# EAGLE schematic ECU_MULT_CAR (EAGLE 7.4.0), part 1 of 2

## Sheet 1 of 20
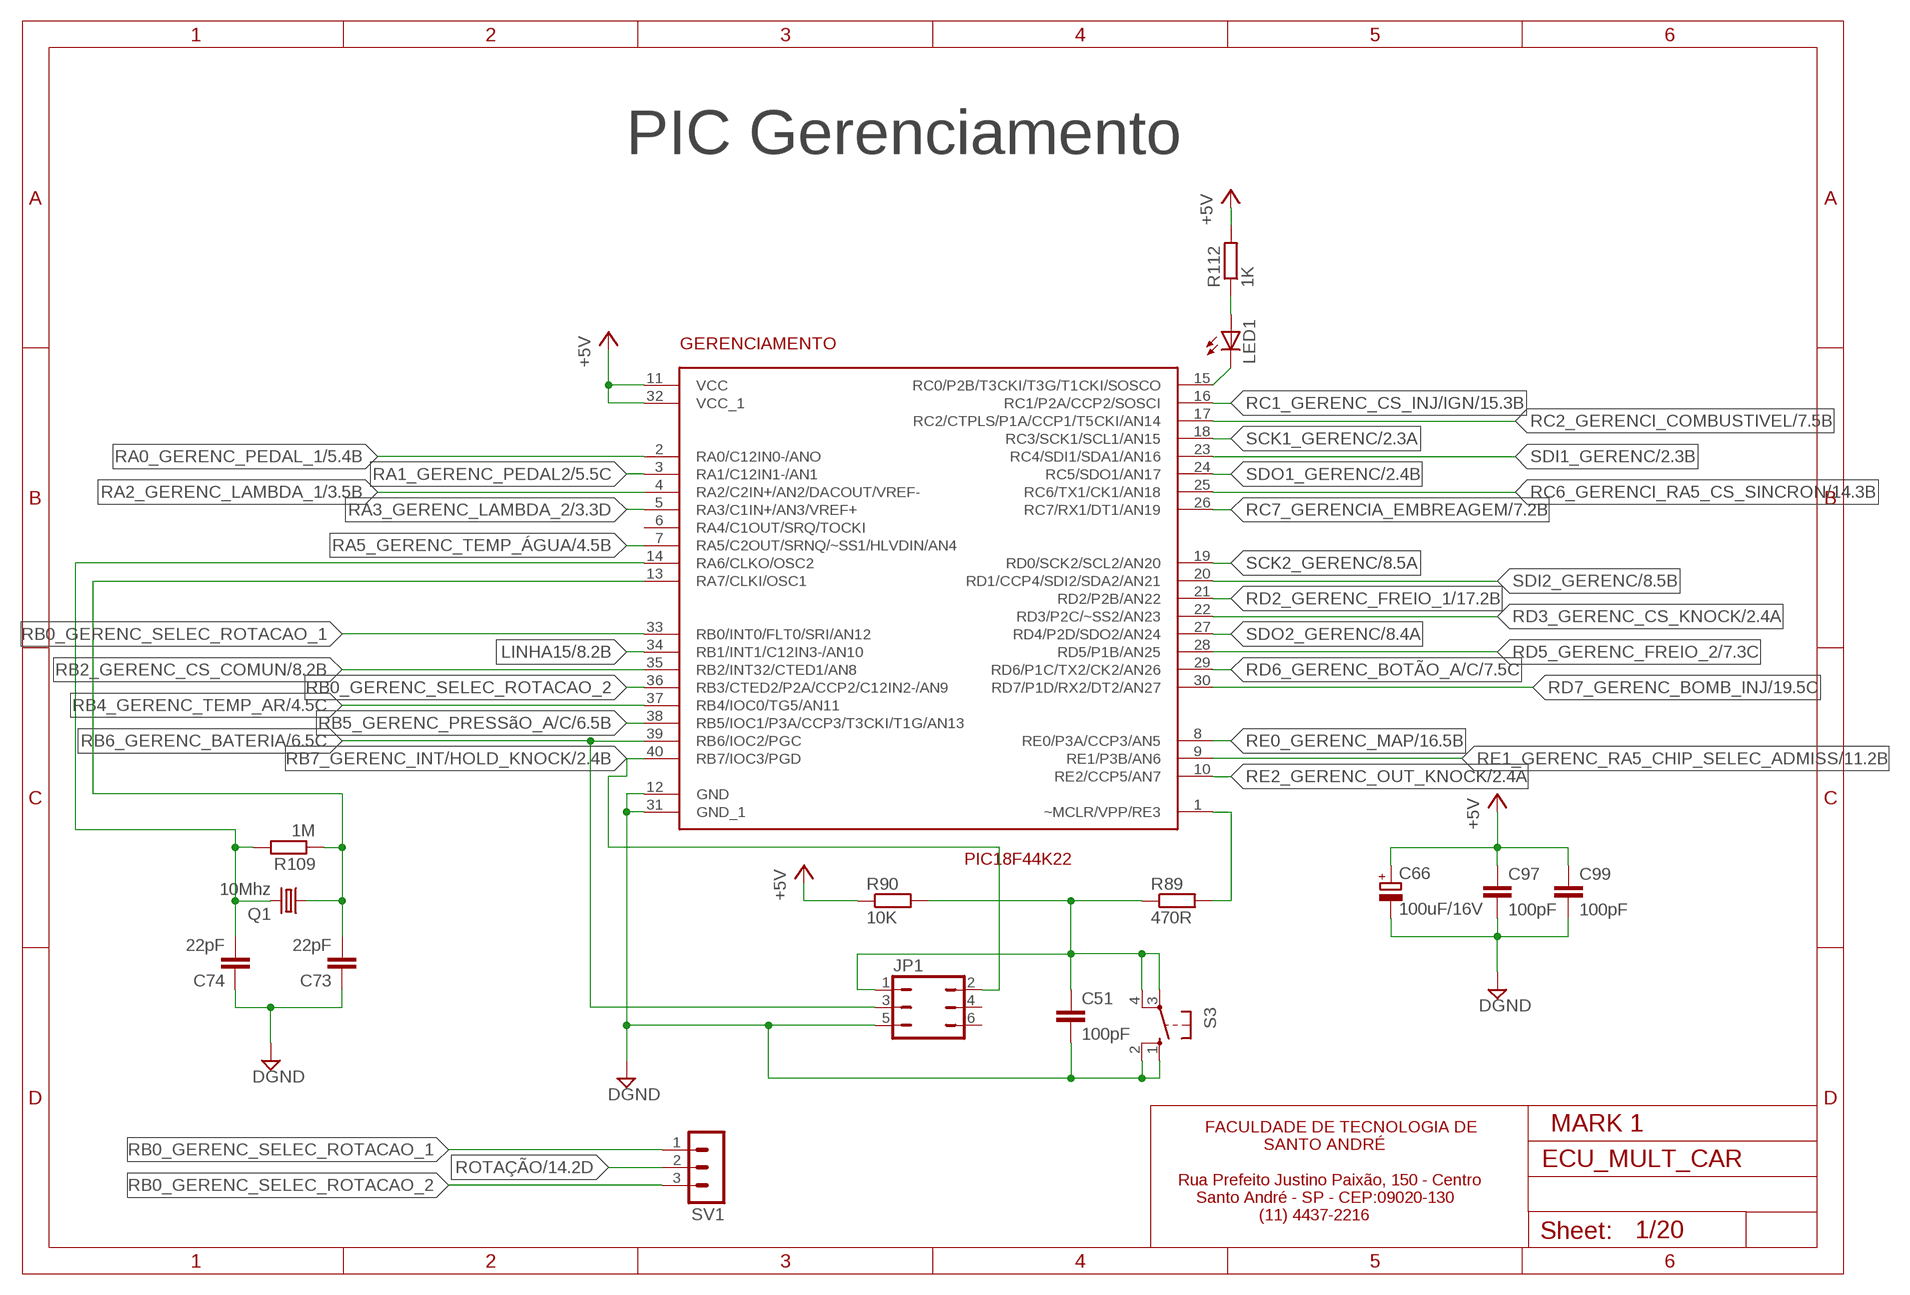
[diagram p0: schematic, sheet 1]

### Parts
C51  100pF  C-EUC0805  [C0805]
C66  100uF/16V  CPOL-EUE2.5-7  [E2,5-7]
C73  22pF  C-EUC0805  [C0805]
C74  22pF  C-EUC0805  [C0805]
C97  100pF  C-EUC0805  [C0805]
C99  100pF  C-EUC0805  [C0805]
GERENCIAMENTO  PIC18F44K22  [DIP40]
JP1  JP3Q  [JP3Q]
LED1  LEDKA-3528ASYC  [KA-3528ASYC]
Q1  10Mhz  CRYSTALSM49  [SM49]
R89  470R  R-EU_M0805  [M0805]
R90  10K  R-EU_M0805  [M0805]
R109  1M  R-EU_M0805  [M0805]
R112  1K  R-EU_M0805  [M0805]
S3  10-XX  [B3F-10XX]
SV1  MA03-1  [MA03-1]

### Nets
+5V: C66.+ C97.1 C99.1 GERENCIAMENTO.11(VCC) GERENCIAMENTO.32(VCC_1) R90.1 R112.2 ; also sheet 2,3,4,5,6,7,8,9,10,11,12,13,14,15,16,17,18,20
DGND: C51.2 C66.- C73.1 C74.1 C97.2 C99.2 GERENCIAMENTO.12(GND) GERENCIAMENTO.31(GND_1) JP1.5 S3.1(S) S3.2(S1) ; also sheet 2,3,7,8,9,10,11,14,15,17,18,19,20
LINHA15: GERENCIAMENTO.34(RB1/INT1/C12IN3-/AN10) ; also sheet 8,11,14,17
N$92: C73.2 GERENCIAMENTO.13(RA7/CLKI/OSC1) Q1.1 R109.1
N$94: GERENCIAMENTO.1(~MCLR/VPP/RE3) R89.2
N$95: C51.1 JP1.1 R89.1 R90.2 S3.3(P) S3.4(P1)
N$100: GERENCIAMENTO.15(RC0/P2B/T3CKI/T3G/T1CKI/SOSCO) LED1.C
N$102: LED1.A R112.1
N$120: C74.2 GERENCIAMENTO.14(RA6/CLKO/OSC2) Q1.2 R109.2
RA0_GERENC_PEDAL_1: GERENCIAMENTO.2(RA0/C12IN0-/ANO) ; also sheet 5
RA1_GERENC_PEDAL2: GERENCIAMENTO.3(RA1/C12IN1-/AN1) ; also sheet 5
RA2_GERENC_LAMBDA_1: GERENCIAMENTO.4(RA2/C2IN+/AN2/DACOUT/VREF-) ; also sheet 3
RA3_GERENC_LAMBDA_2: GERENCIAMENTO.5(RA3/C1IN+/AN3/VREF+) ; also sheet 3
RA5_GERENC_TEMP_ÁGUA: GERENCIAMENTO.7(RA5/C2OUT/SRNQ/~SS1/HLVDIN/AN4) ; also sheet 4
RB0_GERENC_SELEC_ROTACAO_1: GERENCIAMENTO.33(RB0/INT0/FLT0/SRI/AN12) SV1.1
RB0_GERENC_SELEC_ROTACAO_2: GERENCIAMENTO.36(RB3/CTED2/P2A/CCP2/C12IN2-/AN9) SV1.3
RB2_GERENC_CS_COMUN: GERENCIAMENTO.35(RB2/INT32/CTED1/AN8) ; also sheet 8
RB4_GERENC_TEMP_AR: GERENCIAMENTO.37(RB4/IOC0/TG5/AN11) ; also sheet 4
RB5_GERENC_PRESSãO_A/C: GERENCIAMENTO.38(RB5/IOC1/P3A/CCP3/T3CKI/T1G/AN13) ; also sheet 6
RB6_GERENC_BATERIA: GERENCIAMENTO.39(RB6/IOC2/PGC) JP1.3 ; also sheet 6
RB7_GERENC_INT/HOLD_KNOCK: GERENCIAMENTO.40(RB7/IOC3/PGD) JP1.2 ; also sheet 2
RC1_GERENC_CS_INJ/IGN: GERENCIAMENTO.16(RC1/P2A/CCP2/SOSCI) ; also sheet 15
RC2_GERENCI_COMBUSTIVEL: GERENCIAMENTO.17(RC2/CTPLS/P1A/CCP1/T5CKI/AN14) ; also sheet 7
RC6_GERENCI_RA5_CS_SINCRON: GERENCIAMENTO.25(RC6/TX1/CK1/AN18) ; also sheet 14
RC7_GERENCIA_EMBREAGEM: GERENCIAMENTO.26(RC7/RX1/DT1/AN19) ; also sheet 7
RD2_GERENC_FREIO_1: GERENCIAMENTO.21(RD2/P2B/AN22) ; also sheet 17
RD3_GERENC_CS_KNOCK: GERENCIAMENTO.22(RD3/P2C/~SS2/AN23) ; also sheet 2
RD5_GERENC_FREIO_2: GERENCIAMENTO.28(RD5/P1B/AN25) ; also sheet 7
RD6_GERENC_BOTÃO_A/C: GERENCIAMENTO.29(RD6/P1C/TX2/CK2/AN26) ; also sheet 7
RD7_GERENC_BOMB_INJ: GERENCIAMENTO.30(RD7/P1D/RX2/DT2/AN27) ; also sheet 19
RE0_GERENC_MAP: GERENCIAMENTO.8(RE0/P3A/CCP3/AN5) ; also sheet 16
RE1_GERENC_RA5_CHIP_SELEC_ADMISS: GERENCIAMENTO.9(RE1/P3B/AN6) ; also sheet 11
RE2_GERENC_OUT_KNOCK: GERENCIAMENTO.10(RE2/CCP5/AN7) ; also sheet 2
ROTAÇÃO: SV1.2 ; also sheet 14,18
SCK1_GERENC: GERENCIAMENTO.18(RC3/SCK1/SCL1/AN15) ; also sheet 2,11,14,15
SCK2_GERENC: GERENCIAMENTO.19(RD0/SCK2/SCL2/AN20) ; also sheet 8
SDI1_GERENC: GERENCIAMENTO.23(RC4/SDI1/SDA1/AN16) ; also sheet 2,11,14,15
SDI2_GERENC: GERENCIAMENTO.20(RD1/CCP4/SDI2/SDA2/AN21) ; also sheet 8
SDO1_GERENC: GERENCIAMENTO.24(RC5/SDO1/AN17) ; also sheet 2,11,14,15
SDO2_GERENC: GERENCIAMENTO.27(RD4/P2D/SDO2/AN24) ; also sheet 8
Unconnected: GERENCIAMENTO.6(RA4/C1OUT/SRQ/TOCKI) JP1.4 JP1.6

### Notes on the sheet
- PIC Gerenciamento
- MARK 1
- FACULDADE DE TECNOLOGIA DE 
                             SANTO ANDRÉ
  
          Rua Prefeito Justino Paixão, 150 - Centro  
              Santo André - SP - CEP:09020-130
                            (11) 4437-2216

## Sheet 2 of 20
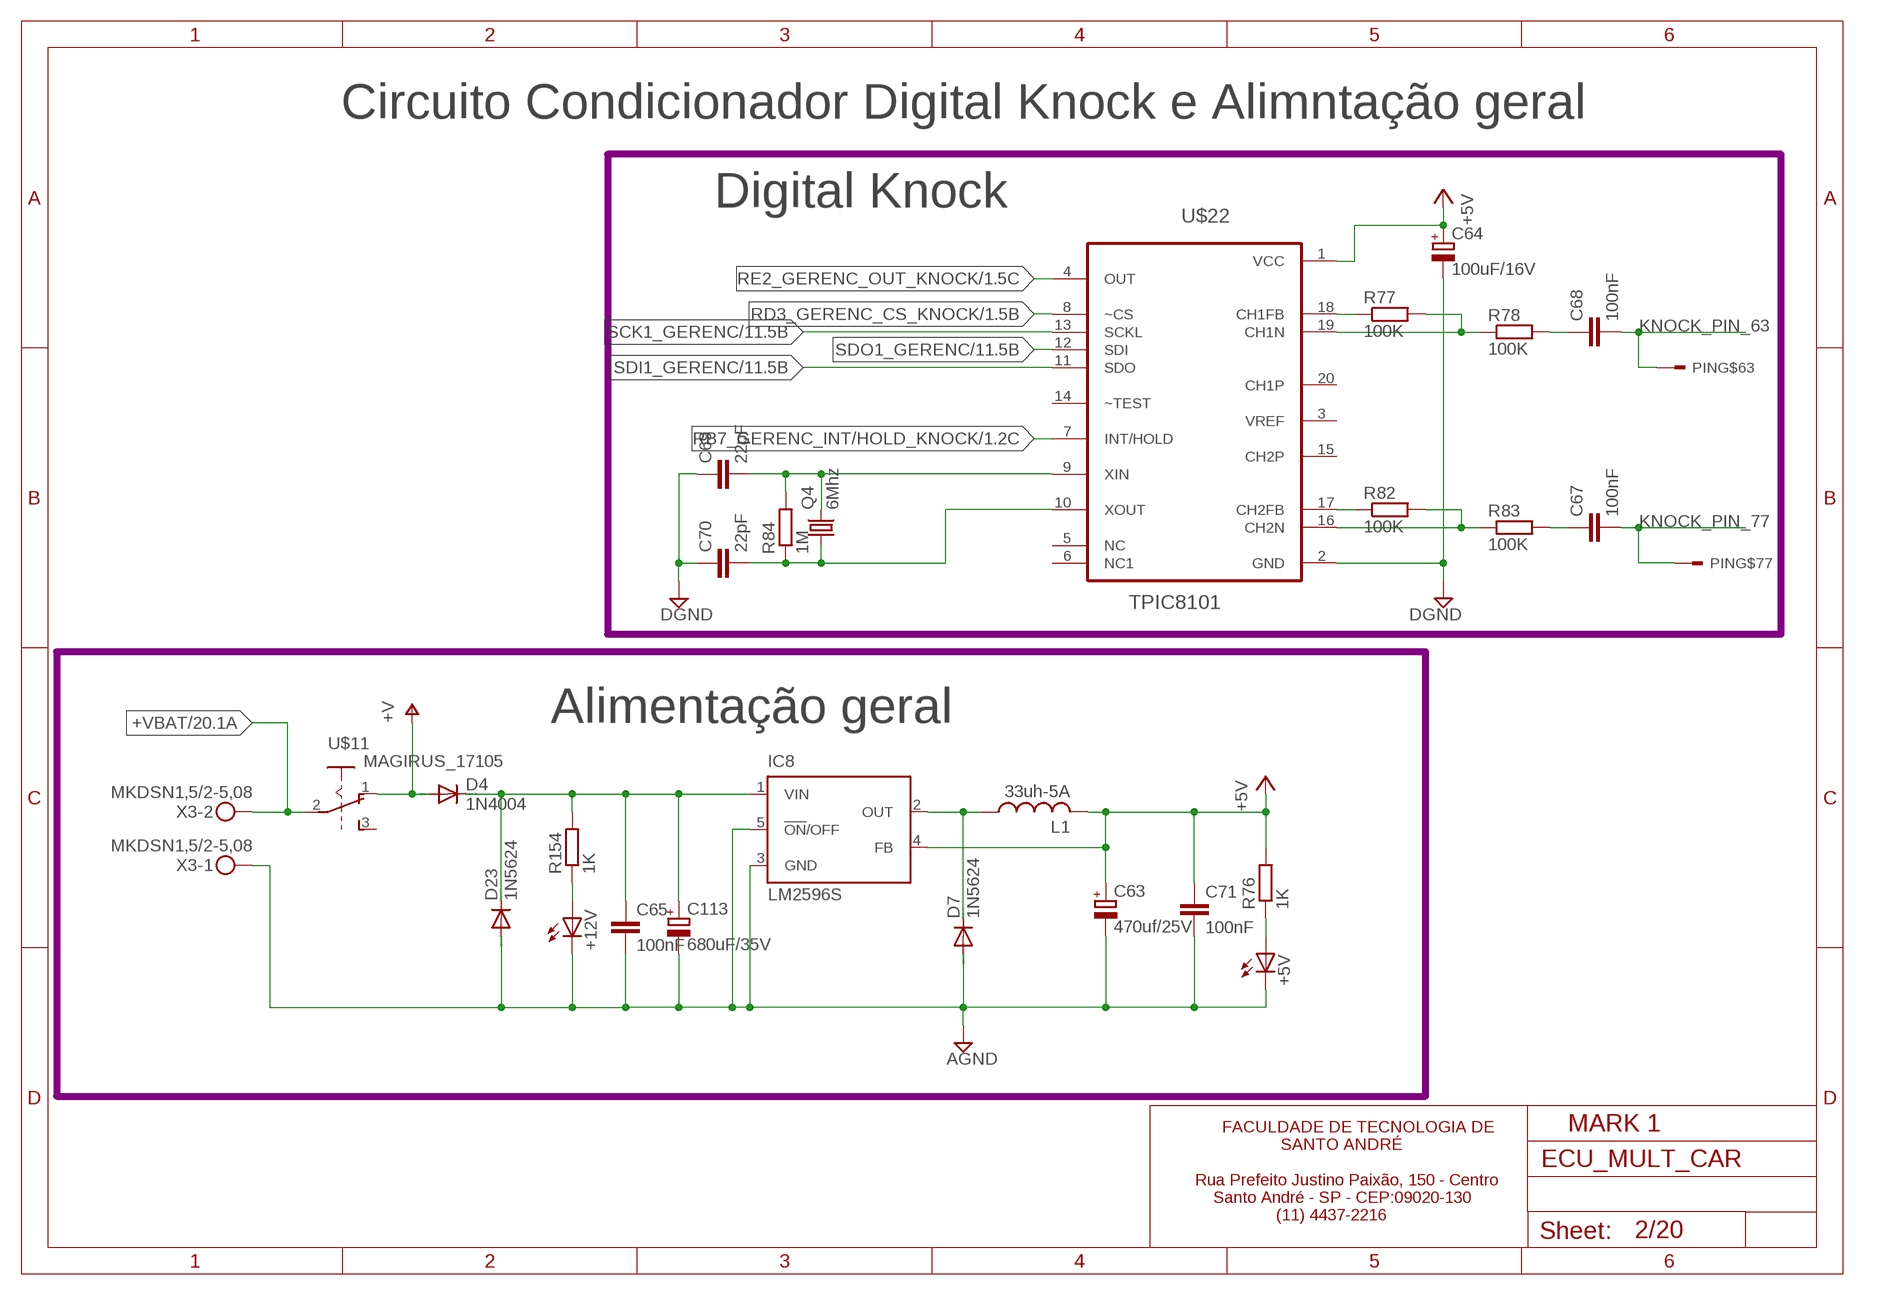
[diagram p1: schematic, sheet 2]

### Parts
+5V  LEDKA-3528ASYC  [KA-3528ASYC]
+12V  LEDKA-3528ASYC  [KA-3528ASYC]
C63  470uf/25V  CPOL-EUE3.5-8  [E3,5-8]
C64  100uF/16V  CPOL-EUE2.5-7  [E2,5-7]
C65  100nF  C-EUC0805  [C0805]
C67  100nF  C-EUC0805  [C0805]
C68  100nF  C-EUC0805  [C0805]
C69  22pF  C-EUC0805  [C0805]
C70  22pF  C-EUC0805  [C0805]
C71  100nF  C-EUC0805  [C0805]
C113  680uF/35V  CPOL-EUE3.5-10  [E3,5-10]
D4  1N4004  [DO41-10]
D7  1N5624  [DO201-15]
D23  1N5624  [DO201-15]
IC8  LM2596S  [TO263-5]
L1  33uh-5A  L-USWE-TPC  [POWER-CHOKE_WE-TPC]
PIN  CONCTOR_BOSCH  [V23542-A1280-B300]
Q4  6Mhz  CRYSTALSM49  [SM49]
R76  1K  R-EU_M0805  [M0805]
R77  100K  R-EU_M0805  [M0805]
R78  100K  R-EU_M0805  [M0805]
R82  100K  R-EU_M0805  [M0805]
R83  100K  R-EU_M0805  [M0805]
R84  1M  R-EU_M0805  [M0805]
R154  1K  R-EU_M0805  [M0805]
U$11  MAGIRUS_17105  [MAGIRUS_TICTAC_3_PIN]
U$22  TPIC8101  [SOIC-20P]
X3  MKDSN1,5/2-5,08  [MKDSN1,5/2-5,08]

### Nets
+5V: C63.+ C64.+ C71.1 IC8.4(FB) L1.2 R76.2 U$22.1(VCC) ; also sheet 1,3,4,5,6,7,8,9,10,11,12,13,14,15,16,17,18,20
+VBAT: U$11.2 X3.2 ; also sheet 20
DGND: C64.- C69.1 C70.1 U$22.2(GND) ; also sheet 1,3,7,8,9,10,11,14,15,17,18,19,20
GND3: +5V.C +12V.C C63.- C65.2 C71.2 C113.- D7.A D23.A IC8.3(GND) IC8.5(!ON!/OFF) X3.1 ; supply symbol labelled AGND ; also sheet 4,5,6,12,13,16,20
KNOCK_PIN_63: C68.2 PIN.63
KNOCK_PIN_77: C67.2 PIN.77
N$50: R82.1 U$22.17(CH2FB)
N$70: +12V.A R154.1
N$75: C65.1 C113.+ D4.C D23.C IC8.1(VIN) R154.2
N$76: D7.C IC8.2(OUT) L1.1
N$80: R77.1 U$22.18(CH1FB)
N$81: R77.2 R78.1 U$22.19(CH1N)
N$82: +5V.A R76.1
N$83: C68.1 R78.2
N$84: R82.2 R83.1 U$22.16(CH2N)
N$85: C67.1 R83.2
N$86: C70.2 Q4.1 R84.1 U$22.10(XOUT)
N$87: C69.2 Q4.2 R84.2 U$22.9(XIN)
RB7_GERENC_INT/HOLD_KNOCK: U$22.7(INT/HOLD) ; also sheet 1
RD3_GERENC_CS_KNOCK: U$22.8(~CS) ; also sheet 1
RE2_GERENC_OUT_KNOCK: U$22.4(OUT) ; also sheet 1
SCK1_GERENC: U$22.13(SCKL) ; also sheet 1,11,14,15
SDI1_GERENC: U$22.11(SDO) ; also sheet 1,11,14,15
SDO1_GERENC: U$22.12(SDI) ; also sheet 1,11,14,15
V+: D4.A U$11.1 ; supply symbol labelled +V ; also sheet 3,4,5,6,13,15,16
Unconnected: PIN.34 PIN.35 PIN.36 PIN.37 PIN.39 PIN.41 PIN.43 PIN.49 PIN.50 PIN.52 PIN.58 PIN.69 PIN.72 PIN.76 PIN.78 U$11.3 U$22.3(VREF) U$22.5(NC) U$22.6(NC1) U$22.14(~TEST) U$22.15(CH2P) U$22.20(CH1P)

### Notes on the sheet
- Circuito Condicionador Digital Knock e Alimntação geral
- Digital Knock
- Alimentação geral
- MARK 1
- FACULDADE DE TECNOLOGIA DE 
                             SANTO ANDRÉ
  
          Rua Prefeito Justino Paixão, 150 - Centro  
              Santo André - SP - CEP:09020-130
                            (11) 4437-2216

## Sheet 3 of 20
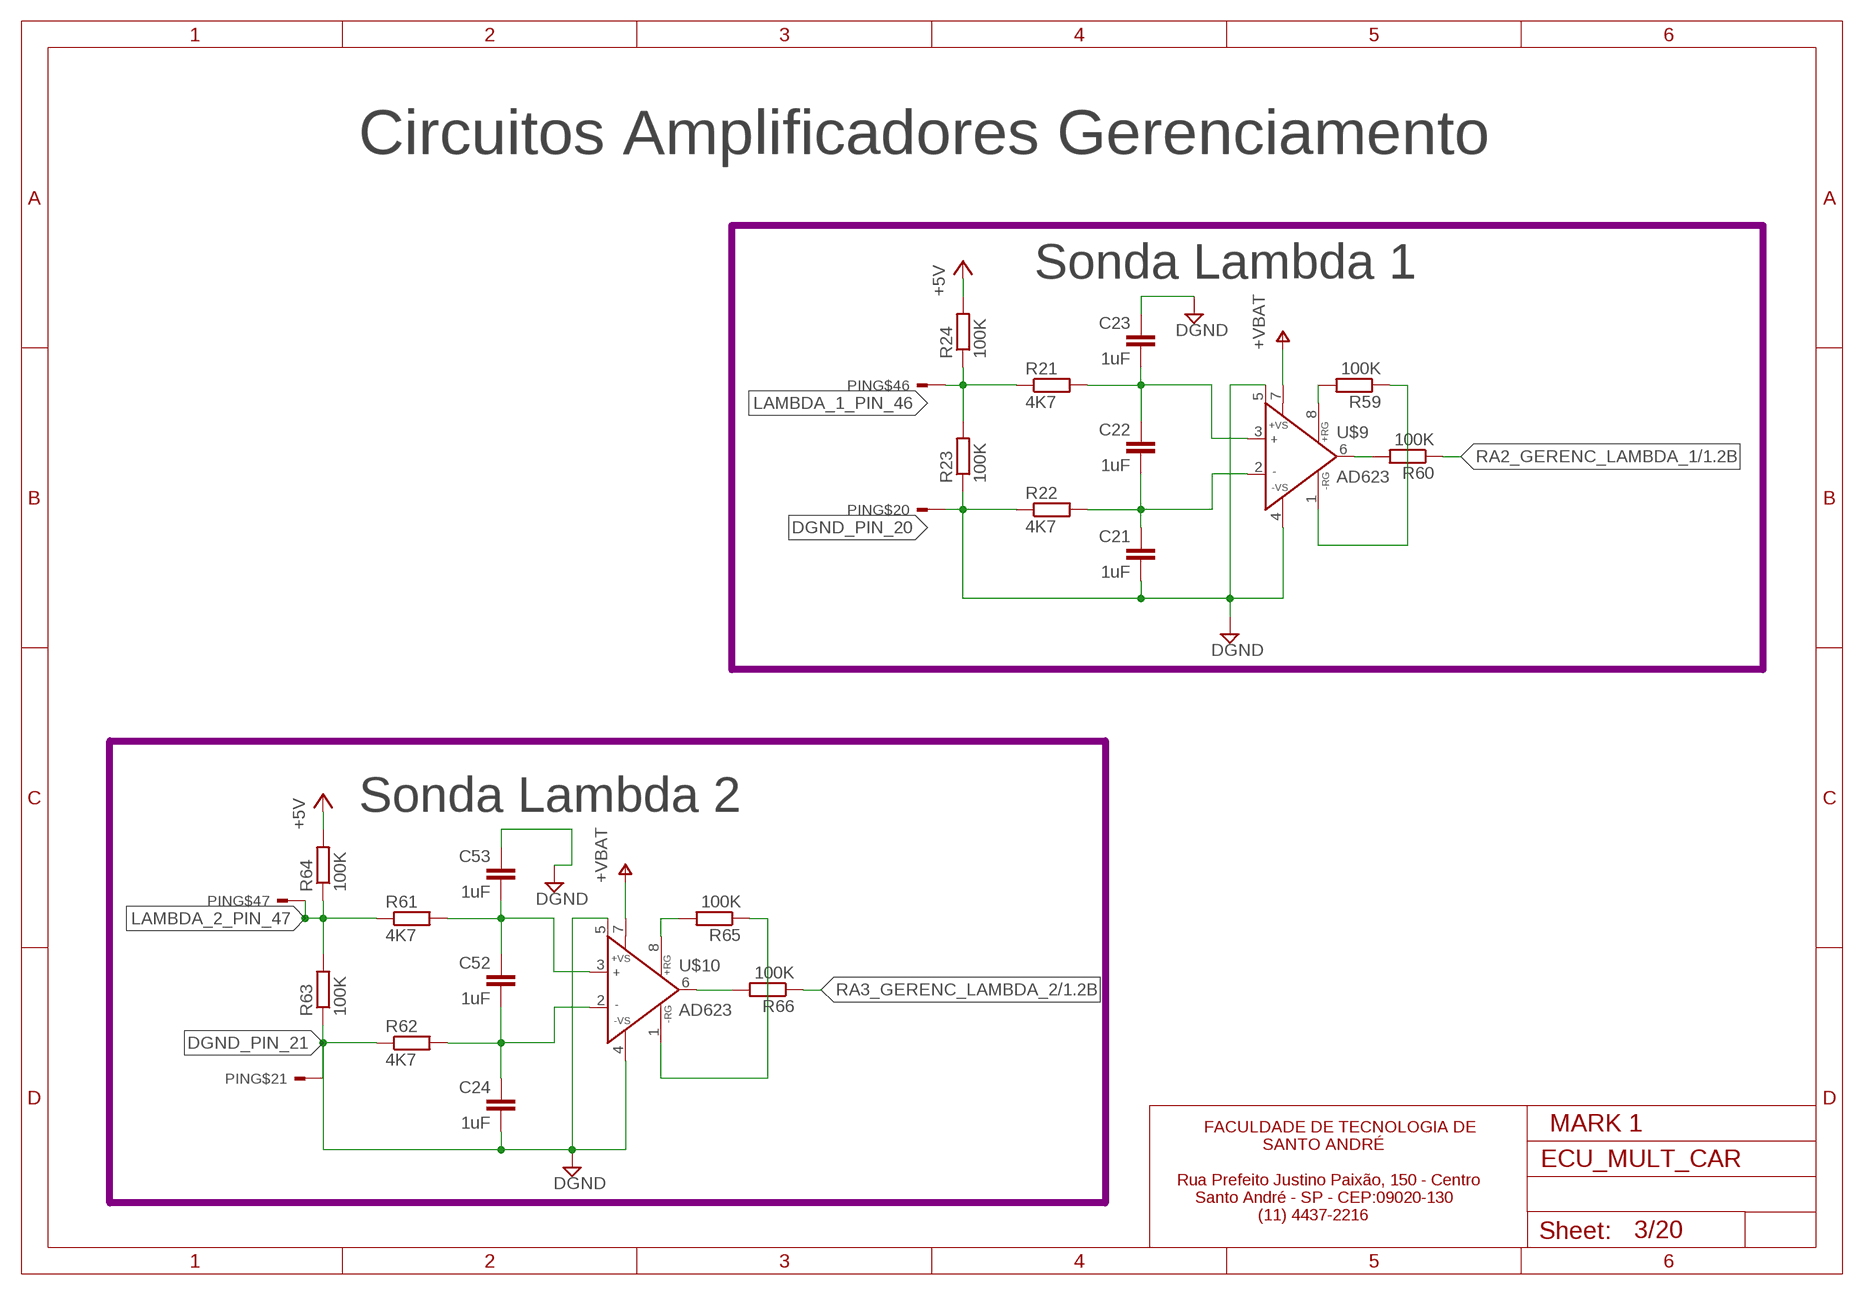
[diagram p2: schematic, sheet 3]

### Parts
C21  1uF  C-EUC0805  [C0805]
C22  1uF  C-EUC0805  [C0805]
C23  1uF  C-EUC0805  [C0805]
C24  1uF  C-EUC0805  [C0805]
C52  1uF  C-EUC0805  [C0805]
C53  1uF  C-EUC0805  [C0805]
R21  4K7  R-EU_M0805  [M0805]
R22  4K7  R-EU_M0805  [M0805]
R23  100K  R-EU_M0805  [M0805]
R24  100K  R-EU_M0805  [M0805]
R59  100K  R-EU_M0805  [M0805]
R60  100K  R-EU_M0805  [M0805]
R61  4K7  R-EU_M0805  [M0805]
R62  4K7  R-EU_M0805  [M0805]
R63  100K  R-EU_M0805  [M0805]
R64  100K  R-EU_M0805  [M0805]
R65  100K  R-EU_M0805  [M0805]
R66  100K  R-EU_M0805  [M0805]
U$9  AD623  [SOIC-8]
U$10  AD623  [SOIC-8]

### Nets
+5V: R24.2 R64.2 ; also sheet 1,2,4,5,6,7,8,9,10,11,12,13,14,15,16,17,18,20
DGND: C23.1 C53.1 ; also sheet 1,2,7,8,9,10,11,14,15,17,18,19,20
DGND_PIN_20: C21.2 PIN.20 R22.1 R23.1 U$9.4(-VS) U$9.5(REF) ; supply symbol labelled DGND
DGND_PIN_21: C24.2 PIN.21 R62.1 R63.1 U$10.4(-VS) U$10.5(REF) ; supply symbol labelled DGND
LAMBDA_1_PIN_46: PIN.46 R21.1 R23.2 R24.1
LAMBDA_2_PIN_47: PIN.47 R61.1 R63.2 R64.1
N$24: C22.1 C23.2 R21.2 U$9.3(+IN)
N$25: C21.1 C22.2 R22.2 U$9.2(-IN)
N$26: C52.1 C53.2 R61.2 U$10.3(+IN)
N$27: C24.1 C52.2 R62.2 U$10.2(-IN)
N$28: R59.2 U$9.8(+RG)
N$49: R59.1 U$9.1(-RG)
N$56: R60.2 U$9.6(OUTPUT)
N$58: R65.2 U$10.8(+RG)
N$60: R65.1 U$10.1(-RG)
N$64: R66.2 U$10.6(OUTPUT)
RA2_GERENC_LAMBDA_1: R60.1 ; also sheet 1
RA3_GERENC_LAMBDA_2: R66.1 ; also sheet 1
V+: U$9.7(+VS) U$10.7(+VS) ; supply symbol labelled +VBAT ; also sheet 2,4,5,6,13,15,16

### Notes on the sheet
- Circuitos Amplificadores Gerenciamento
- Sonda Lambda 1
- Sonda Lambda 2
- MARK 1
- FACULDADE DE TECNOLOGIA DE 
                             SANTO ANDRÉ
  
          Rua Prefeito Justino Paixão, 150 - Centro  
              Santo André - SP - CEP:09020-130
                            (11) 4437-2216

## Sheet 4 of 20
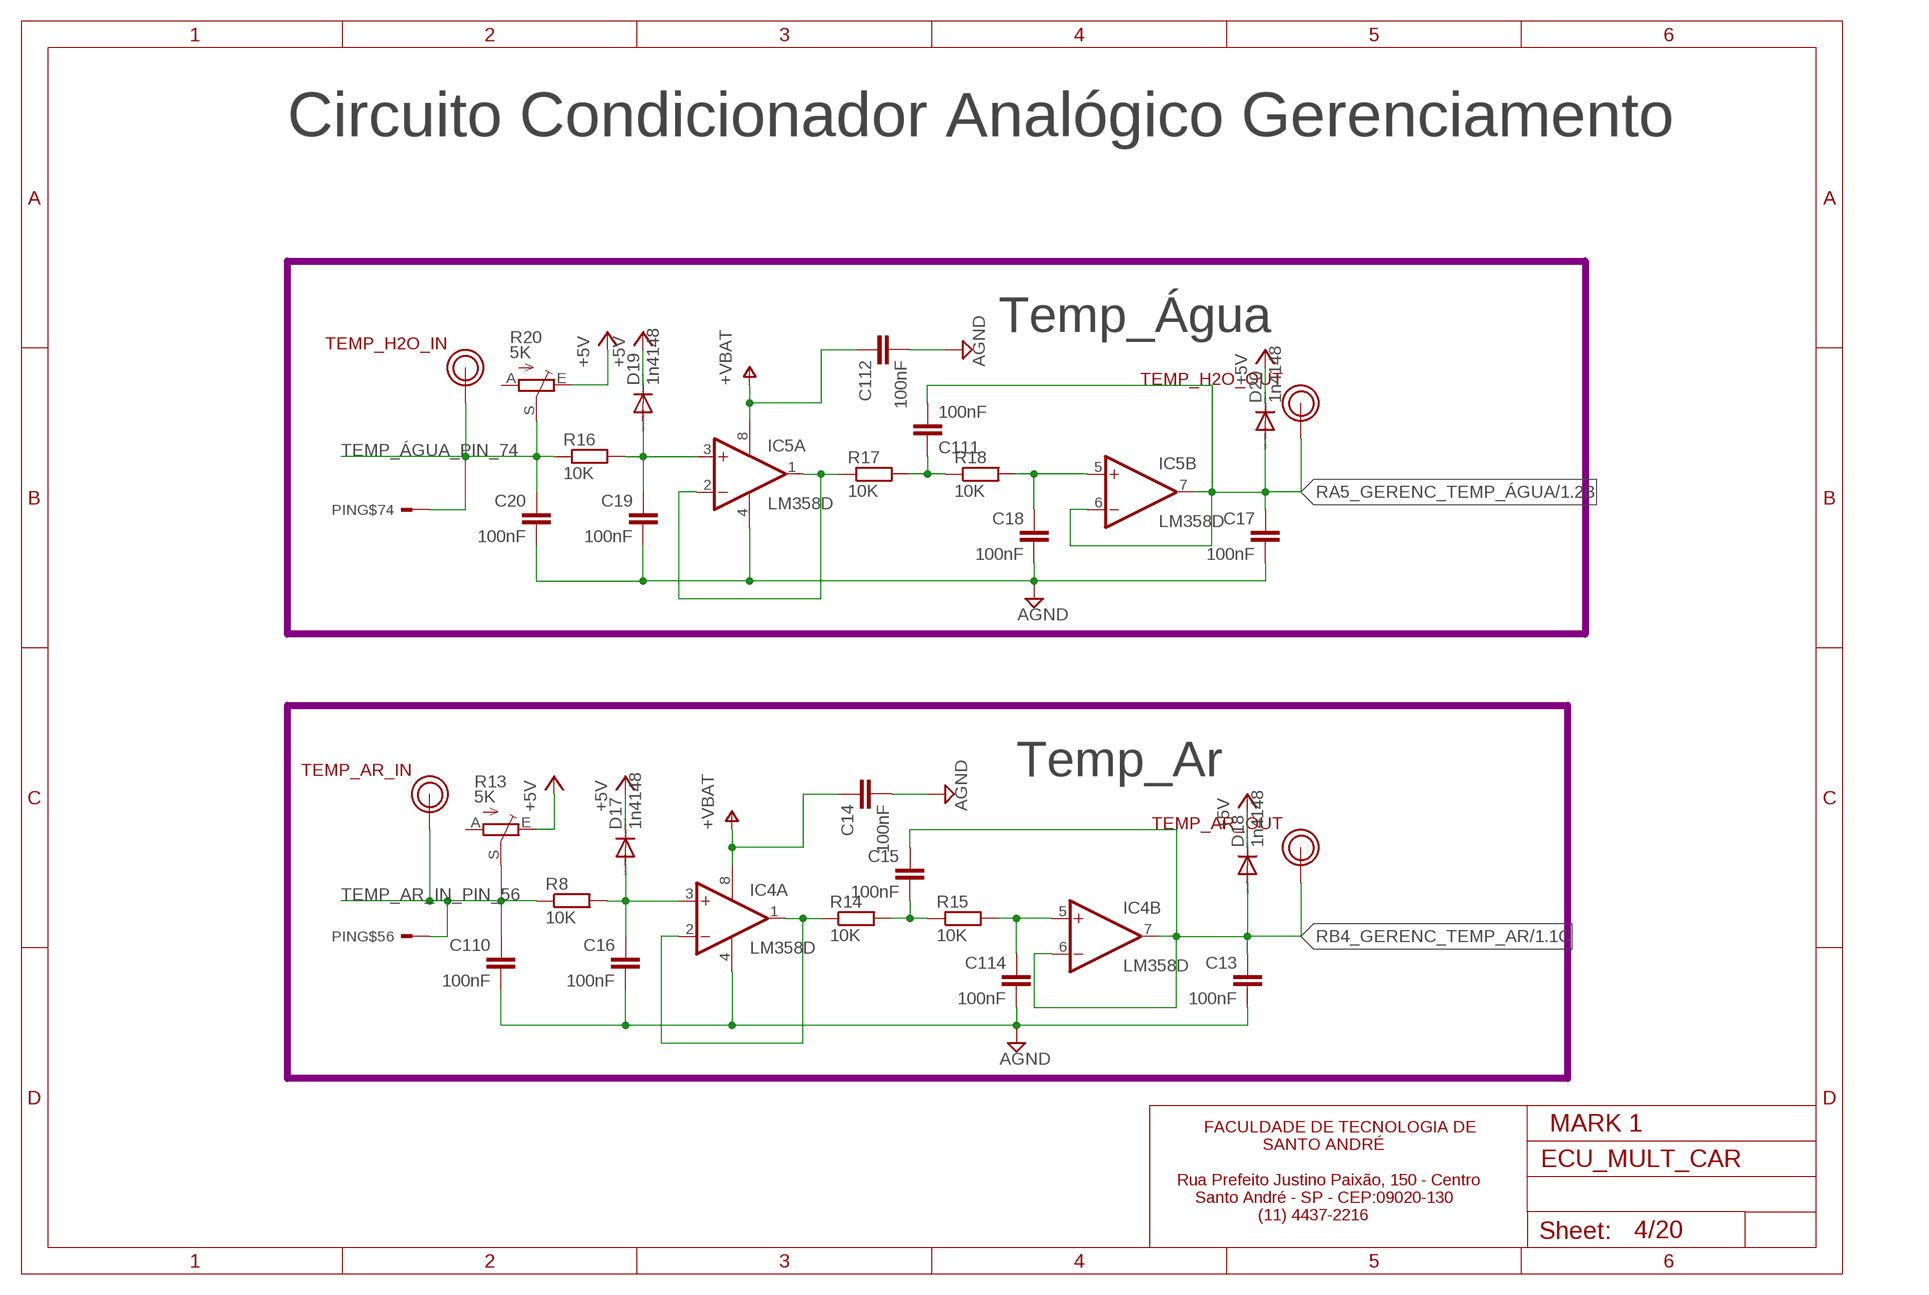
[diagram p3: schematic, sheet 4]

### Parts
C13  100nF  C-EUC0805  [C0805]
C14  100nF  C-EUC0805  [C0805]
C15  100nF  C-EUC0805  [C0805]
C16  100nF  C-EUC0805  [C0805]
C17  100nF  C-EUC0805  [C0805]
C18  100nF  C-EUC0805  [C0805]
C19  100nF  C-EUC0805  [C0805]
C20  100nF  C-EUC0805  [C0805]
C110  100nF  C-EUC0805  [C0805]
C111  100nF  C-EUC0805  [C0805]
C112  100nF  C-EUC0805  [C0805]
C114  100nF  C-EUC0805  [C0805]
D17  1n4148  DIODE-MINIMELF  [MINIMELF]
D18  1n4148  DIODE-MINIMELF  [MINIMELF]
D19  1n4148  DIODE-MINIMELF  [MINIMELF]
D20  1n4148  DIODE-MINIMELF  [MINIMELF]
IC4  LM358D  [SO08]
IC5  LM358D  [SO08]
R8  10K  R-EU_M0805  [M0805]
R13  5K  TRIM_EU-S63P  [S63P]
R14  10K  R-EU_M0805  [M0805]
R15  10K  R-EU_M0805  [M0805]
R16  10K  R-EU_M0805  [M0805]
R17  10K  R-EU_M0805  [M0805]
R18  10K  R-EU_M0805  [M0805]
R20  5K  TRIM_EU-S63P  [S63P]
TEMP_AR_IN  PINO_TORNEADO  [PINO_TORNEADO]
TEMP_AR_OUT  PINO_TORNEADO  [PINO_TORNEADO]
TEMP_H2O_IN  PINO_TORNEADO  [PINO_TORNEADO]
TEMP_H2O_OUT  PINO_TORNEADO  [PINO_TORNEADO]

### Nets
+5V: D17.C D18.C D19.C D20.C R13.E R20.E ; also sheet 1,2,3,5,6,7,8,9,10,11,12,13,14,15,16,17,18,20
GND3: C13.2 C14.2 C16.2 C17.2 C18.2 C19.2 C20.2 C110.2 C112.2 C114.2 IC4.4(P:V-) IC5.4(P:V-) ; supply symbol labelled AGND ; also sheet 2,5,6,12,13,16,20
N$10: C16.1 D17.A IC4.3(A:+IN) R8.2
N$16: C19.1 D19.A IC5.3(A:+IN) R16.2
N$17: IC4.1(A:OUT) IC4.2(A:-IN) R14.1
N$18: C15.2 R14.2 R15.1
N$19: C114.1 IC4.5(B:+IN) R15.2
N$21: IC5.1(A:OUT) IC5.2(A:-IN) R17.1
N$22: C111.1 R17.2 R18.1
N$23: C18.1 IC5.5(B:+IN) R18.2
RA5_GERENC_TEMP_ÁGUA: C17.1 C111.2 D20.A IC5.6(B:-IN) IC5.7(B:OUT) TEMP_H2O_OUT.1(PINO1) ; also sheet 1
RB4_GERENC_TEMP_AR: C13.1 C15.1 D18.A IC4.6(B:-IN) IC4.7(B:OUT) TEMP_AR_OUT.1(PINO1) ; also sheet 1
TEMP_AR_IN_PIN_56: C110.1 PIN.56 R8.1 R13.S TEMP_AR_IN.1(PINO1)
TEMP_ÁGUA_PIN_74: C20.1 PIN.74 R16.1 R20.S TEMP_H2O_IN.1(PINO1)
V+: C14.1 C112.1 IC4.8(P:V+) IC5.8(P:V+) ; supply symbol labelled +VBAT ; also sheet 2,3,5,6,13,15,16
Unconnected: R13.A R20.A

### Notes on the sheet
- Circuito Condicionador Analógico Gerenciamento
- Temp_Água
- Temp_Ar
- MARK 1
- FACULDADE DE TECNOLOGIA DE 
                             SANTO ANDRÉ
  
          Rua Prefeito Justino Paixão, 150 - Centro  
              Santo André - SP - CEP:09020-130
                            (11) 4437-2216

## Sheet 5 of 20
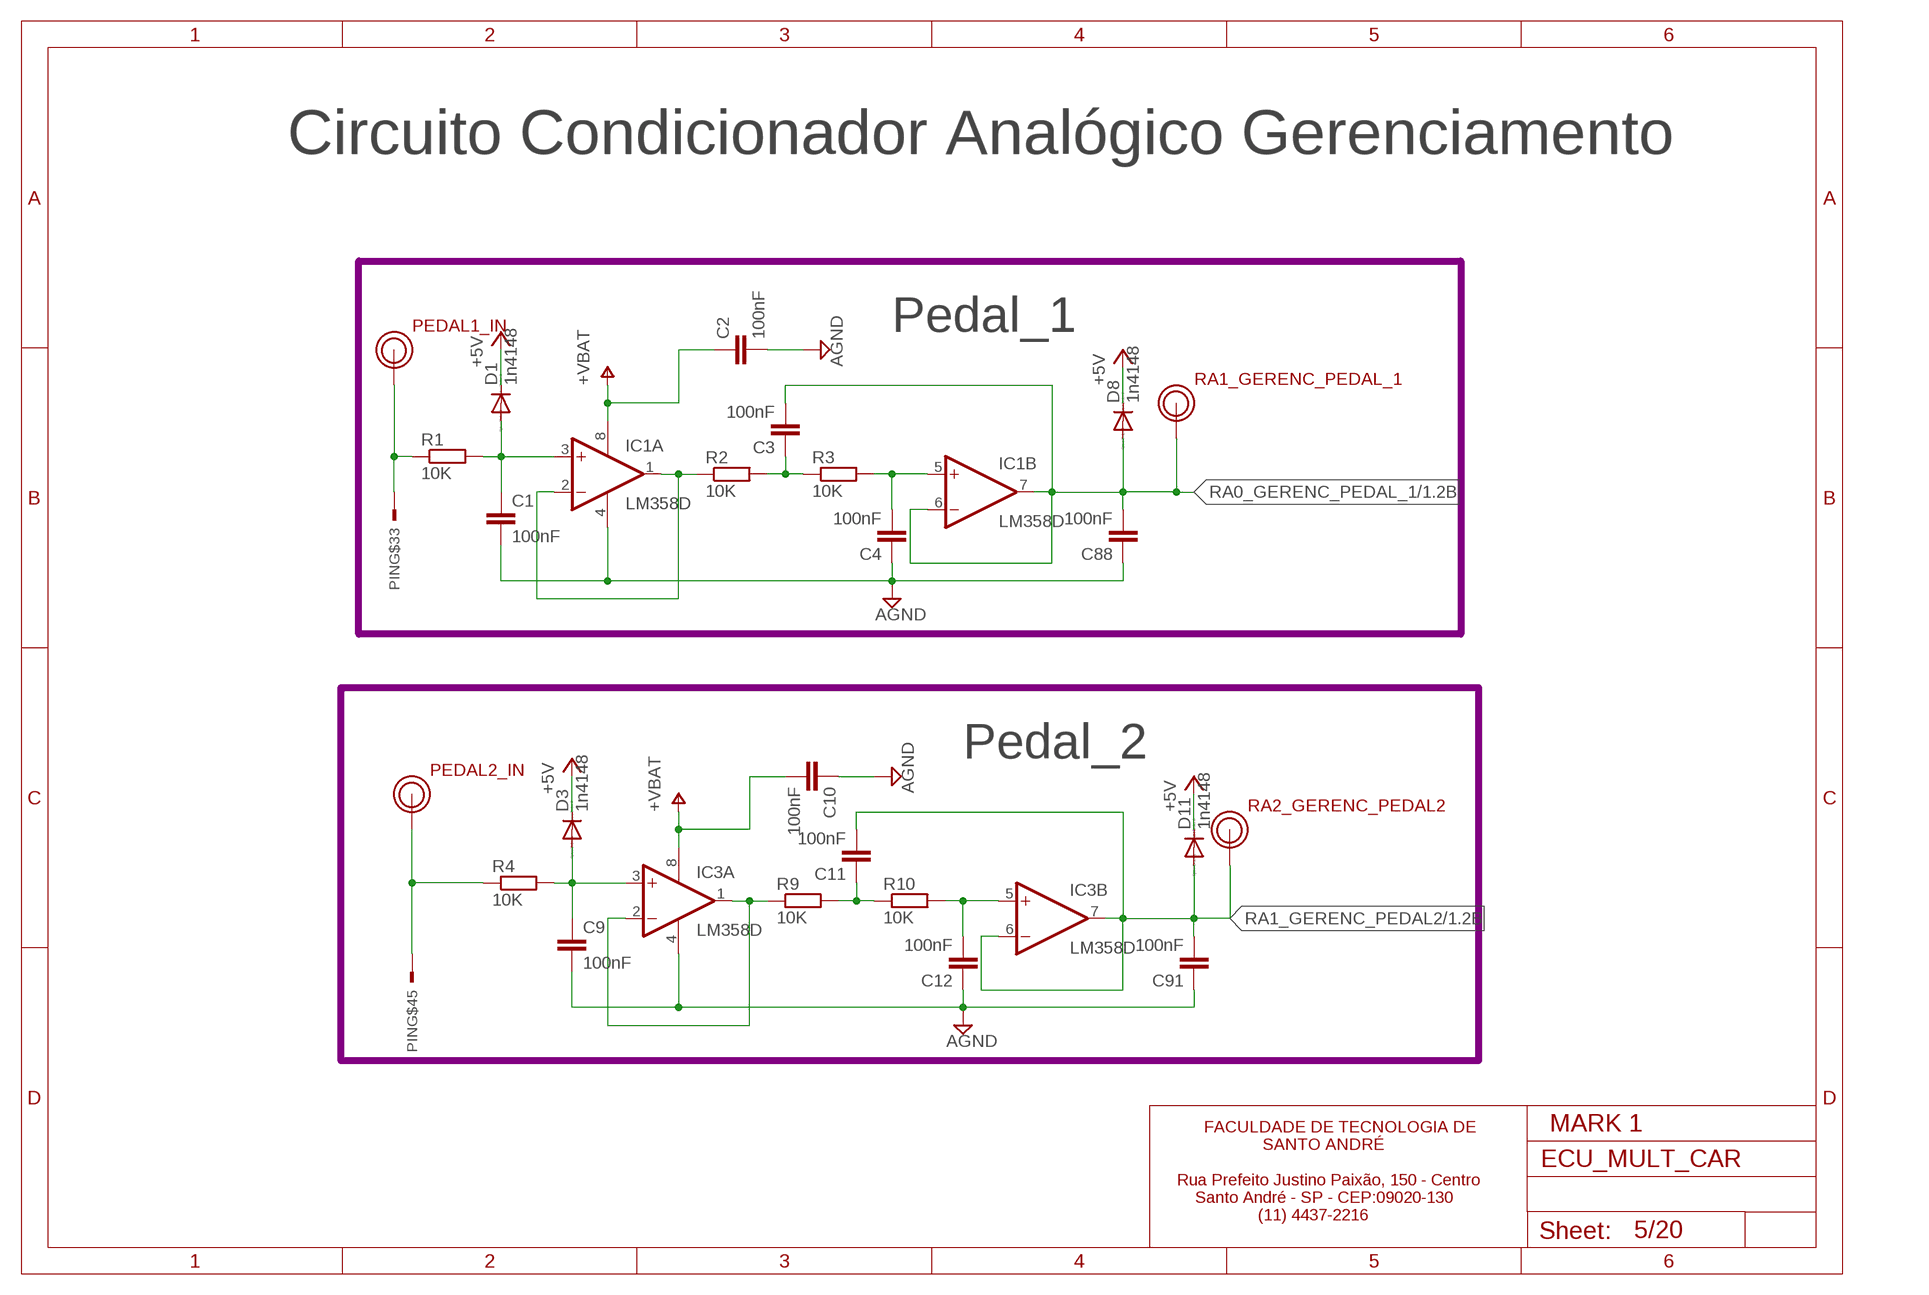
[diagram p4: schematic, sheet 5]

### Parts
C1  100nF  C-EUC0805  [C0805]
C2  100nF  C-EUC0805  [C0805]
C3  100nF  C-EUC0805  [C0805]
C4  100nF  C-EUC0805  [C0805]
C9  100nF  C-EUC0805  [C0805]
C10  100nF  C-EUC0805  [C0805]
C11  100nF  C-EUC0805  [C0805]
C12  100nF  C-EUC0805  [C0805]
C88  100nF  C-EUC0805  [C0805]
C91  100nF  C-EUC0805  [C0805]
D1  1n4148  DIODE-MINIMELF  [MINIMELF]
D3  1n4148  DIODE-MINIMELF  [MINIMELF]
D8  1n4148  DIODE-MINIMELF  [MINIMELF]
D11  1n4148  DIODE-MINIMELF  [MINIMELF]
IC1  LM358D  [SO08]
IC3  LM358D  [SO08]
PEDAL1_IN  PINO_TORNEADO  [PINO_TORNEADO]
PEDAL2_IN  PINO_TORNEADO  [PINO_TORNEADO]
R1  10K  R-EU_M0805  [M0805]
R2  10K  R-EU_M0805  [M0805]
R3  10K  R-EU_M0805  [M0805]
R4  10K  R-EU_M0805  [M0805]
R9  10K  R-EU_M0805  [M0805]
R10  10K  R-EU_M0805  [M0805]
RA1_GERENC_PEDAL_1  PINO_TORNEADO  [PINO_TORNEADO]
RA2_GERENC_PEDAL2  PINO_TORNEADO  [PINO_TORNEADO]

### Nets
+5V: D1.C D3.C D8.C D11.C ; also sheet 1,2,3,4,6,7,8,9,10,11,12,13,14,15,16,17,18,20
GND3: C1.2 C2.2 C4.1 C9.2 C10.1 C12.1 C88.1 C91.1 IC1.4(P:V-) IC3.4(P:V-) ; supply symbol labelled AGND ; also sheet 2,4,6,12,13,16,20
N$1: C1.1 D1.A IC1.3(A:+IN) R1.2
N$2: IC1.1(A:OUT) IC1.2(A:-IN) R2.1
N$3: C9.1 D3.A IC3.3(A:+IN) R4.2
N$4: C3.1 R2.2 R3.1
N$5: C4.2 IC1.5(B:+IN) R3.2
N$11: IC3.1(A:OUT) IC3.2(A:-IN) R9.1
N$12: C11.1 R9.2 R10.1
N$13: C12.2 IC3.5(B:+IN) R10.2
PEDAL1_PIN_33: PEDAL1_IN.1(PINO1) PIN.33 R1.1
PEDAL2_PIN_45: PEDAL2_IN.1(PINO1) PIN.45 R4.1
RA0_GERENC_PEDAL_1: C3.2 C88.2 D8.A IC1.6(B:-IN) IC1.7(B:OUT) RA1_GERENC_PEDAL_1.1(PINO1) ; also sheet 1
RA1_GERENC_PEDAL2: C11.2 C91.2 D11.A IC3.6(B:-IN) IC3.7(B:OUT) RA2_GERENC_PEDAL2.1(PINO1) ; also sheet 1
V+: C2.1 C10.2 IC1.8(P:V+) IC3.8(P:V+) ; supply symbol labelled +VBAT ; also sheet 2,3,4,6,13,15,16

### Notes on the sheet
- Circuito Condicionador Analógico Gerenciamento
- Pedal_1
- Pedal_2
- MARK 1
- FACULDADE DE TECNOLOGIA DE 
                             SANTO ANDRÉ
  
          Rua Prefeito Justino Paixão, 150 - Centro  
              Santo André - SP - CEP:09020-130
                            (11) 4437-2216

## Sheet 6 of 20
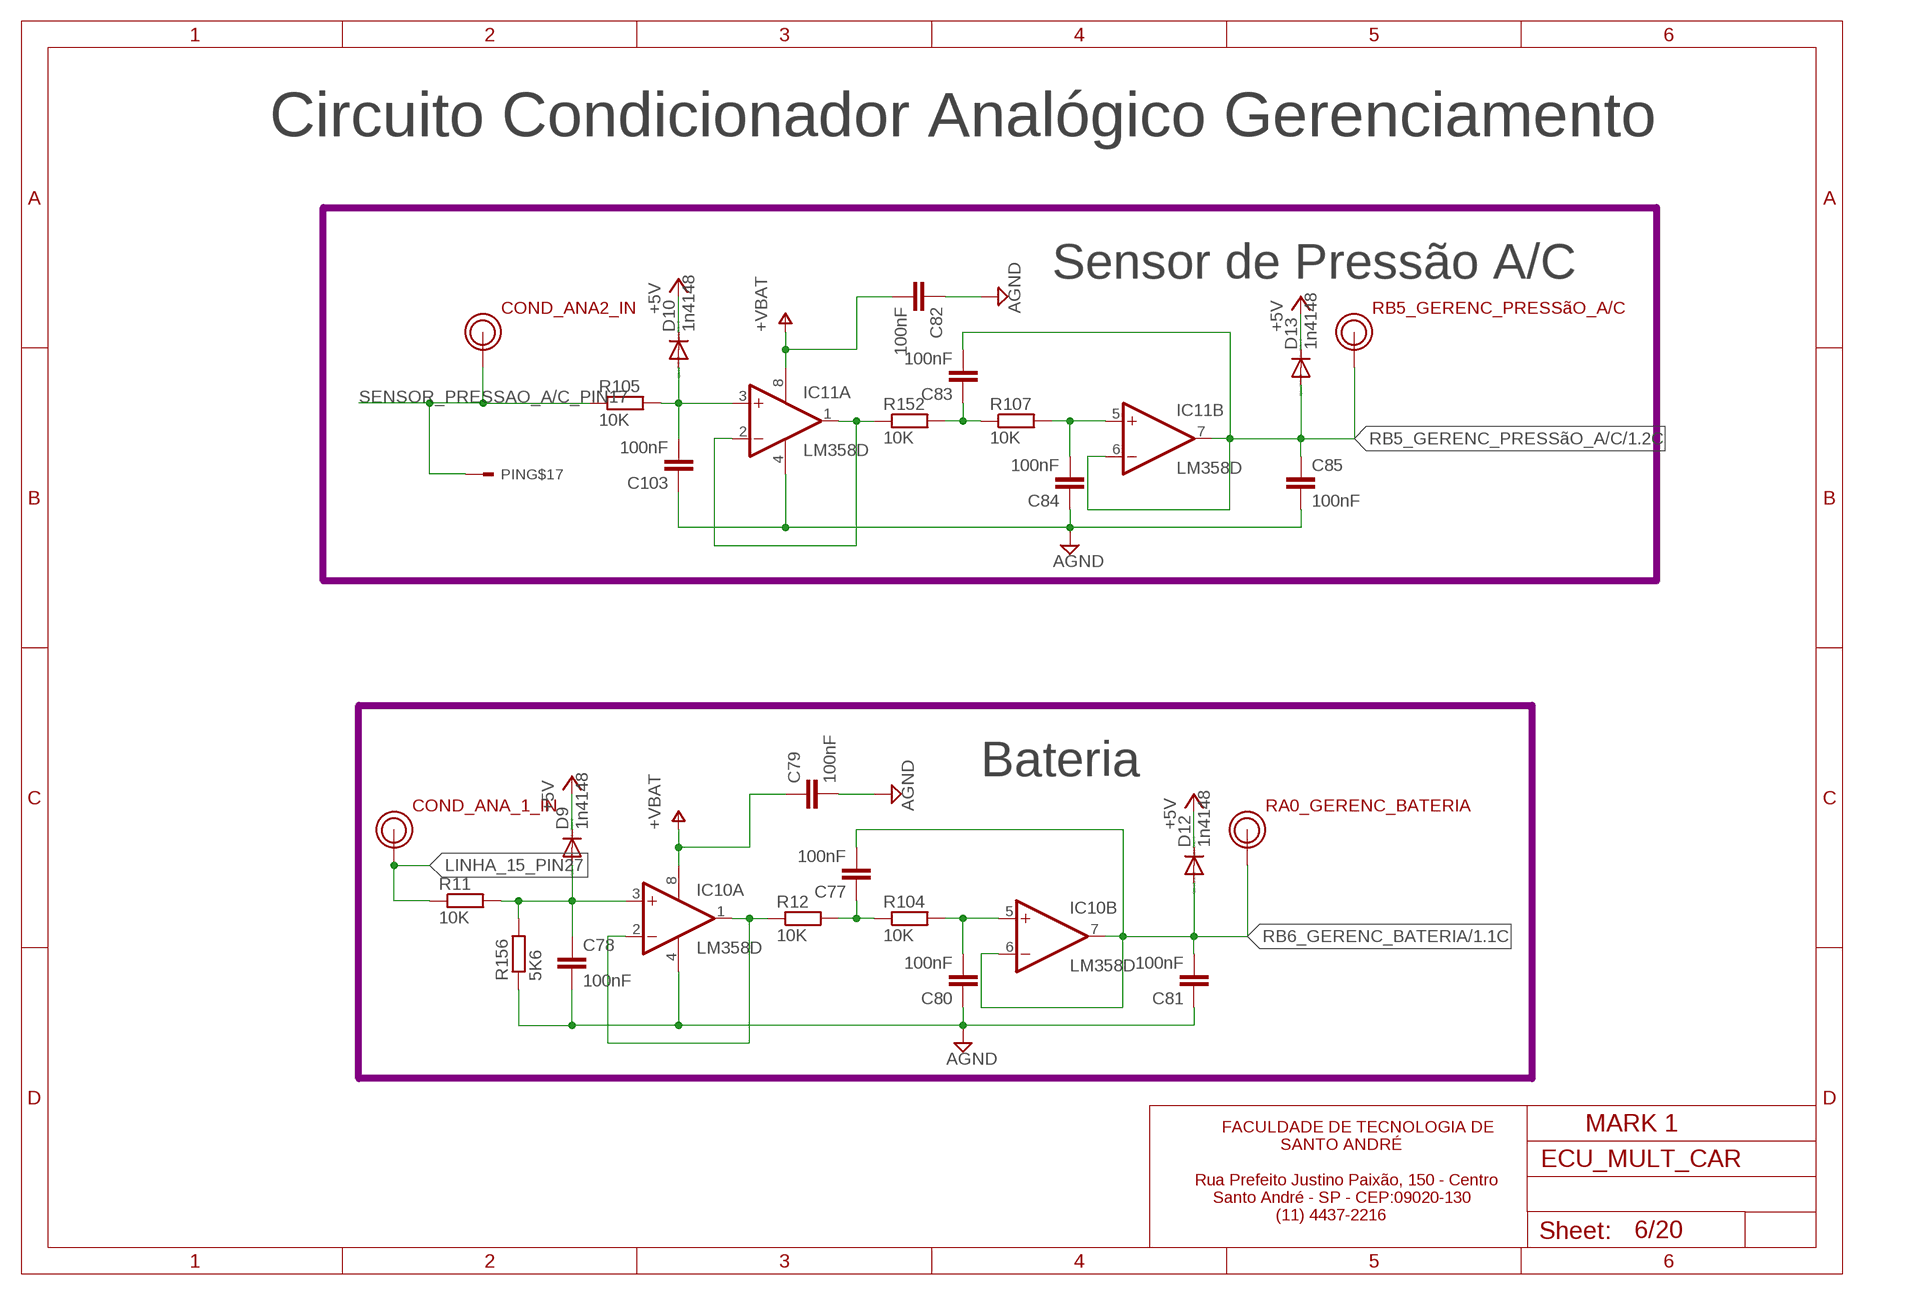
[diagram p5: schematic, sheet 6]

### Parts
C77  100nF  C-EUC0805  [C0805]
C78  100nF  C-EUC0805  [C0805]
C79  100nF  C-EUC0805  [C0805]
C80  100nF  C-EUC0805  [C0805]
C81  100nF  C-EUC0805  [C0805]
C82  100nF  C-EUC0805  [C0805]
C83  100nF  C-EUC0805  [C0805]
C84  100nF  C-EUC0805  [C0805]
C85  100nF  C-EUC0805  [C0805]
C103  100nF  C-EUC0805  [C0805]
COND_ANA2_IN  PINO_TORNEADO  [PINO_TORNEADO]
COND_ANA_1_IN  PINO_TORNEADO  [PINO_TORNEADO]
D9  1n4148  DIODE-MINIMELF  [MINIMELF]
D10  1n4148  DIODE-MINIMELF  [MINIMELF]
D12  1n4148  DIODE-MINIMELF  [MINIMELF]
D13  1n4148  DIODE-MINIMELF  [MINIMELF]
IC10  LM358D  [SO08]
IC11  LM358D  [SO08]
R11  10K  R-EU_M0805  [M0805]
R12  10K  R-EU_M0805  [M0805]
R104  10K  R-EU_M0805  [M0805]
R105  10K  R-EU_M0805  [M0805]
R107  10K  R-EU_M0805  [M0805]
R152  10K  R-EU_M0805  [M0805]
R156  5K6  R-EU_M0805  [M0805]
RA0_GERENC_BATERIA  PINO_TORNEADO  [PINO_TORNEADO]
RB5_GERENC_PRESSãO_A/C  PINO_TORNEADO  [PINO_TORNEADO]

### Nets
+5V: D9.C D10.C D12.C D13.C ; also sheet 1,2,3,4,5,7,8,9,10,11,12,13,14,15,16,17,18,20
GND3: C78.2 C79.2 C80.1 C81.1 C82.1 C84.1 C85.2 C103.1 IC10.4(P:V-) IC11.4(P:V-) R156.1 ; supply symbol labelled AGND ; also sheet 2,4,5,12,13,16,20
LINHA_15_PIN27: COND_ANA_1_IN.1(PINO1) R11.1 ; also sheet 12,17
N$14: C78.1 D9.A IC10.3(A:+IN) R11.2 R156.2
N$15: IC10.1(A:OUT) IC10.2(A:-IN) R12.1
N$110: C77.1 R12.2 R104.1
N$111: C80.2 IC10.5(B:+IN) R104.2
N$112: C103.2 D10.A IC11.3(A:+IN) R105.2
N$113: IC11.1(A:OUT) IC11.2(A:-IN) R152.1
N$116: C83.1 R107.1 R152.2
N$117: C84.2 IC11.5(B:+IN) R107.2
RB5_GERENC_PRESSãO_A/C: C83.2 C85.1 D13.A IC11.6(B:-IN) IC11.7(B:OUT) RB5_GERENC_PRESSãO_A/C.1(PINO1) ; also sheet 1
RB6_GERENC_BATERIA: C77.2 C81.2 D12.A IC10.6(B:-IN) IC10.7(B:OUT) RA0_GERENC_BATERIA.1(PINO1) ; also sheet 1
SENSOR_PRESSAO_A/C_PIN17: COND_ANA2_IN.1(PINO1) PIN.17 R105.1
V+: C79.1 C82.2 IC10.8(P:V+) IC11.8(P:V+) ; supply symbol labelled +VBAT ; also sheet 2,3,4,5,13,15,16

### Notes on the sheet
- Circuito Condicionador Analógico Gerenciamento
- Sensor de Pressão A/C
- Bateria
- MARK 1
- FACULDADE DE TECNOLOGIA DE 
                             SANTO ANDRÉ
  
          Rua Prefeito Justino Paixão, 150 - Centro  
              Santo André - SP - CEP:09020-130
                            (11) 4437-2216

## Sheet 7 of 20
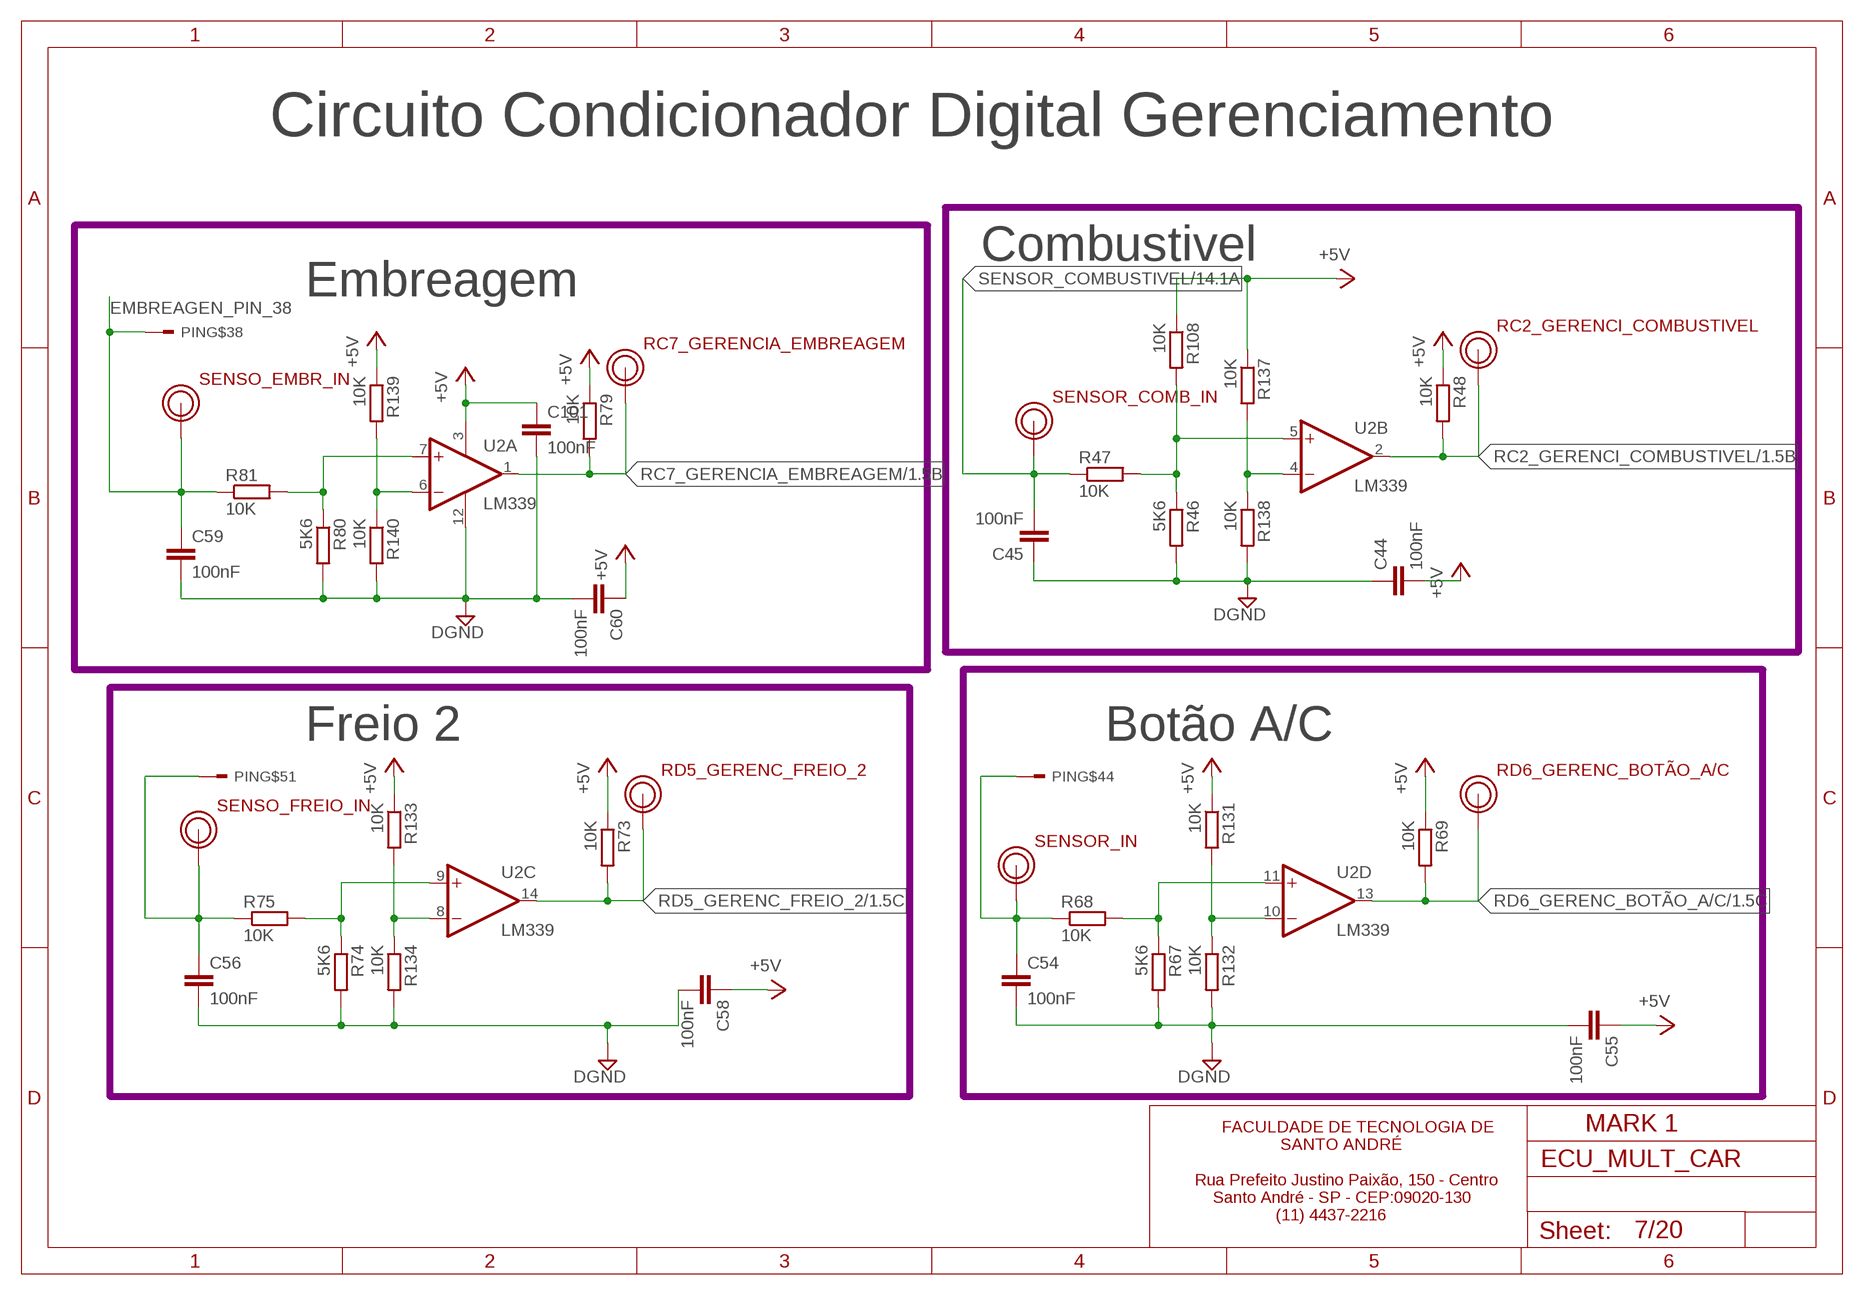
[diagram p6: schematic, sheet 7]

### Parts
C44  100nF  C-EUC0805  [C0805]
C45  100nF  C-EUC0805  [C0805]
C54  100nF  C-EUC0805  [C0805]
C55  100nF  C-EUC0805  [C0805]
C56  100nF  C-EUC0805  [C0805]
C58  100nF  C-EUC0805  [C0805]
C59  100nF  C-EUC0805  [C0805]
C60  100nF  C-EUC0805  [C0805]
C101  100nF  C-EUC0805  [C0805]
R46  5K6  R-EU_M0805  [M0805]
R47  10K  R-EU_M0805  [M0805]
R48  10K  R-EU_M0805  [M0805]
R67  5K6  R-EU_M0805  [M0805]
R68  10K  R-EU_M0805  [M0805]
R69  10K  R-EU_M0805  [M0805]
R73  10K  R-EU_M0805  [M0805]
R74  5K6  R-EU_M0805  [M0805]
R75  10K  R-EU_M0805  [M0805]
R79  10K  R-EU_M0805  [M0805]
R80  5K6  R-EU_M0805  [M0805]
R81  10K  R-EU_M0805  [M0805]
R108  10K  R-EU_M0805  [M0805]
R131  10K  R-EU_M0805  [M0805]
R132  10K  R-EU_M0805  [M0805]
R133  10K  R-EU_M0805  [M0805]
R134  10K  R-EU_M0805  [M0805]
R137  10K  R-EU_M0805  [M0805]
R138  10K  R-EU_M0805  [M0805]
R139  10K  R-EU_M0805  [M0805]
R140  10K  R-EU_M0805  [M0805]
RC2_GERENCI_COMBUSTIVEL  PINO_TORNEADO  [PINO_TORNEADO]
RC7_GERENCIA_EMBREAGEM  PINO_TORNEADO  [PINO_TORNEADO]
RD5_GERENC_FREIO_2  PINO_TORNEADO  [PINO_TORNEADO]
RD6_GERENC_BOTÃO_A/C  PINO_TORNEADO  [PINO_TORNEADO]
SENSO_EMBR_IN  PINO_TORNEADO  [PINO_TORNEADO]
SENSO_FREIO_IN  PINO_TORNEADO  [PINO_TORNEADO]
SENSOR_COMB_IN  PINO_TORNEADO  [PINO_TORNEADO]
SENSOR_IN  PINO_TORNEADO  [PINO_TORNEADO]
U2  LM339  [SOIC14N]

### Nets
+5V: C44.2 C55.1 C58.1 C60.1 C101.1 R48.1 R69.1 R73.1 R79.1 R108.1 R131.1 R133.1 R137.1 R139.1 U2.3(V+) ; also sheet 1,2,3,4,5,6,8,9,10,11,12,13,14,15,16,17,18,20
BOTAO_A/C_ACION_AR_COND_PIN44: C54.1 PIN.44 R68.1 SENSOR_IN.1(PINO1)
DGND: C44.1 C45.1 C54.2 C55.2 C56.2 C58.2 C59.2 C60.2 C101.2 R46.2 R67.2 R74.2 R80.2 R132.2 R134.2 R138.2 R140.2 U2.12(V-) ; also sheet 1,2,3,8,9,10,11,14,15,17,18,19,20
EMBREAGEN_PIN_38: C59.1 PIN.38 R81.1 SENSO_EMBR_IN.1(PINO1)
FREIO_PIN_51: C56.1 PIN.51 R75.1 SENSO_FREIO_IN.1(PINO1)
N$53: R46.1 R47.2 R108.2 U2.5(B:+IN)
N$66: R67.1 R68.2 U2.11(D:+IN)
N$73: R74.1 R75.2 U2.9(C:+IN)
N$77: R80.1 R81.2 U2.7(A:+IN)
N$78: R131.2 R132.1 U2.10(D:-IN)
N$138: R137.2 R138.1 U2.4(B:-IN)
N$163: R133.2 R134.1 U2.8(C:-IN)
N$167: R139.2 R140.1 U2.6(A:-IN)
RC2_GERENCI_COMBUSTIVEL: R48.2 RC2_GERENCI_COMBUSTIVEL.1(PINO1) U2.2(B:OUT) ; also sheet 1
RC7_GERENCIA_EMBREAGEM: R79.2 RC7_GERENCIA_EMBREAGEM.1(PINO1) U2.1(A:OUT) ; also sheet 1
RD5_GERENC_FREIO_2: R73.2 RD5_GERENC_FREIO_2.1(PINO1) U2.14(C:OUT) ; also sheet 1
RD6_GERENC_BOTÃO_A/C: R69.2 RD6_GERENC_BOTÃO_A/C.1(PINO1) U2.13(D:OUT) ; also sheet 1
SENSOR_COMBUSTIVEL: C45.2 R47.1 SENSOR_COMB_IN.1(PINO1) ; also sheet 14

### Notes on the sheet
- Circuito Condicionador Digital Gerenciamento
- Combustivel
- Embreagem
- Freio 2 | Botão A/C
- MARK 1
- FACULDADE DE TECNOLOGIA DE 
                             SANTO ANDRÉ
  
          Rua Prefeito Justino Paixão, 150 - Centro  
              Santo André - SP - CEP:09020-130
                            (11) 4437-2216

## Sheet 8 of 20
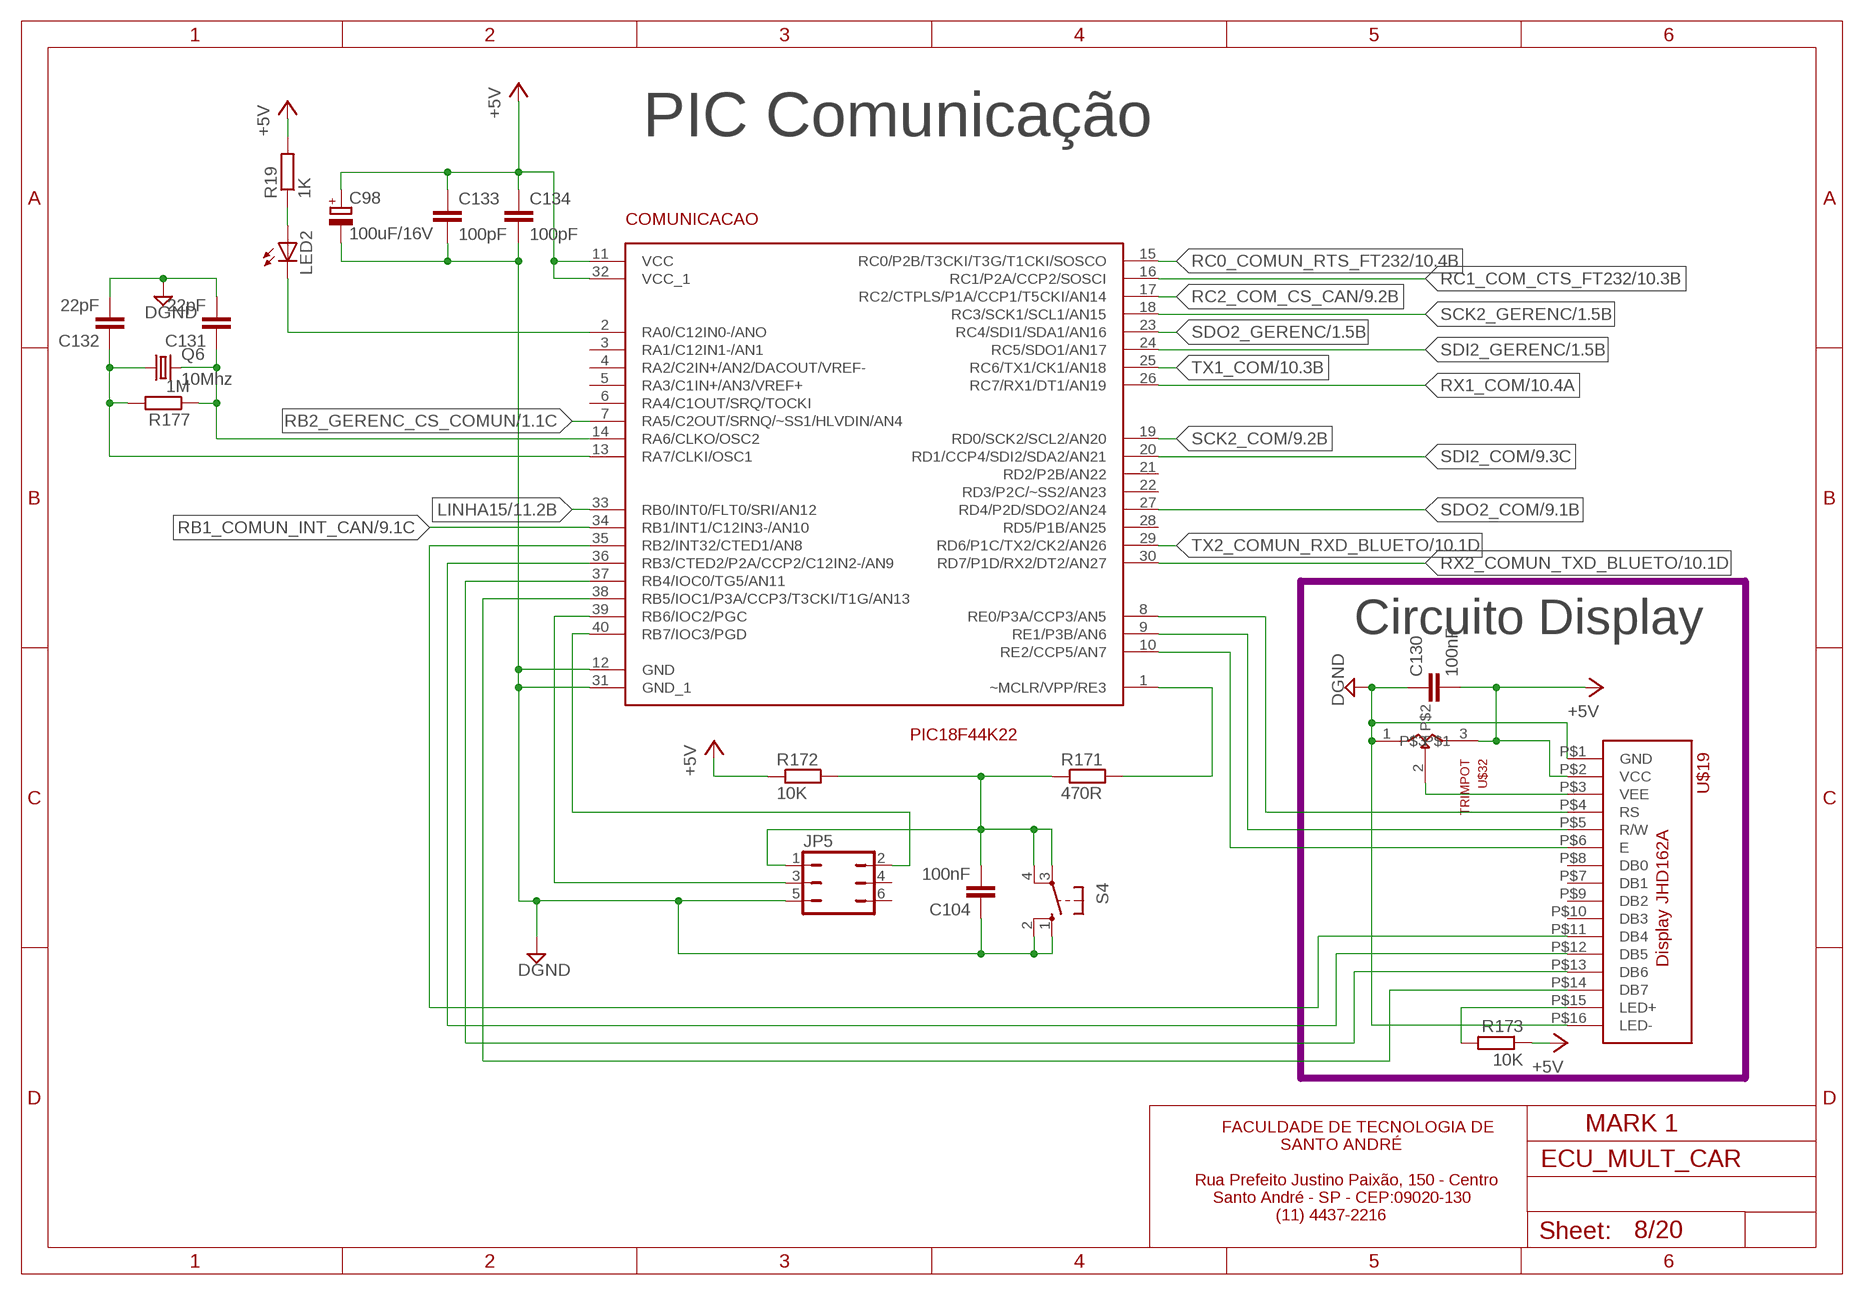
[diagram p7: schematic, sheet 8]

### Parts
C98  100uF/16V  CPOL-EUE2.5-7  [E2,5-7]
C104  100nF  C-EUC0805  [C0805]
C130  100nF  C-EUC0805  [C0805]
C131  22pF  C-EUC0805  [C0805]
C132  22pF  C-EUC0805  [C0805]
C133  100pF  C-EUC0805  [C0805]
C134  100pF  C-EUC0805  [C0805]
COMUNICACAO  PIC18F44K22  [DIP40]
JP5  JP3Q  [JP3Q]
LED2  LEDKA-3528ASYC  [KA-3528ASYC]
Q6  10Mhz  CRYSTALSM49  [SM49]
R19  1K  R-EU_M0805  [M0805]
R171  470R  R-EU_M0805  [M0805]
R172  10K  R-EU_M0805  [M0805]
R173  10K  R-EU_M0805  [M0805]
R177  1M  R-EU_M0805  [M0805]
S4  10-XX  [B3F-10XX]
U$19  JHD162A  [JHD162A]
U$32  TRIMPOT  [TRIMPOT]

### Nets
+5V: C98.+ C130.2 C133.1 C134.1 COMUNICACAO.11(VCC) COMUNICACAO.32(VCC_1) R19.2 R172.1 R173.1 U$19.P$2(VCC) U$32.3 ; also sheet 1,2,3,4,5,6,7,9,10,11,12,13,14,15,16,17,18,20
DGND: C98.- C104.1 C130.1 C131.2 C132.2 C133.2 C134.2 COMUNICACAO.12(GND) COMUNICACAO.31(GND_1) JP5.5 S4.1(S) S4.2(S1) U$19.P$1(GND) U$19.P$16(LED-) U$32.1 ; also sheet 1,2,3,7,9,10,11,14,15,17,18,19,20
LINHA15: COMUNICACAO.33(RB0/INT0/FLT0/SRI/AN12) ; also sheet 1,11,14,17
N$37: COMUNICACAO.2(RA0/C12IN0-/ANO) LED2.C
N$38: LED2.A R19.1
N$171: COMUNICACAO.38(RB5/IOC1/P3A/CCP3/T3CKI/T1G/AN13) U$19.P$14(DB7)
N$172: COMUNICACAO.37(RB4/IOC0/TG5/AN11) U$19.P$13(DB6)
N$173: COMUNICACAO.36(RB3/CTED2/P2A/CCP2/C12IN2-/AN9) U$19.P$12(DB5)
N$177: COMUNICACAO.35(RB2/INT32/CTED1/AN8) U$19.P$11(DB4)
N$201: C104.2 JP5.1 R171.1 R172.2 S4.3(P) S4.4(P1)
N$202: COMUNICACAO.40(RB7/IOC3/PGD) JP5.2
N$203: COMUNICACAO.1(~MCLR/VPP/RE3) R171.2
N$204: C131.1 COMUNICACAO.14(RA6/CLKO/OSC2) Q6.2 R177.1
N$205: R173.2 U$19.P$15(LED+)
N$206: U$19.P$3(VEE) U$32.2
N$208: C132.1 COMUNICACAO.13(RA7/CLKI/OSC1) Q6.1 R177.2
N$209: COMUNICACAO.39(RB6/IOC2/PGC) JP5.3
N$211: COMUNICACAO.8(RE0/P3A/CCP3/AN5) U$19.P$4(RS)
N$212: COMUNICACAO.9(RE1/P3B/AN6) U$19.P$5(R/W)
N$213: COMUNICACAO.10(RE2/CCP5/AN7) U$19.P$6(E)
RB1_COMUN_INT_CAN: COMUNICACAO.34(RB1/INT1/C12IN3-/AN10) ; also sheet 9
RB2_GERENC_CS_COMUN: COMUNICACAO.7(RA5/C2OUT/SRNQ/~SS1/HLVDIN/AN4) ; also sheet 1
RC0_COMUN_RTS_FT232: COMUNICACAO.15(RC0/P2B/T3CKI/T3G/T1CKI/SOSCO) ; also sheet 10
RC1_COM_CTS_FT232: COMUNICACAO.16(RC1/P2A/CCP2/SOSCI) ; also sheet 10
RC2_COM_CS_CAN: COMUNICACAO.17(RC2/CTPLS/P1A/CCP1/T5CKI/AN14) ; also sheet 9
RX1_COM: COMUNICACAO.26(RC7/RX1/DT1/AN19) ; also sheet 10
RX2_COMUN_TXD_BLUETO: COMUNICACAO.30(RD7/P1D/RX2/DT2/AN27) ; also sheet 10
SCK2_COM: COMUNICACAO.19(RD0/SCK2/SCL2/AN20) ; also sheet 9
SCK2_GERENC: COMUNICACAO.18(RC3/SCK1/SCL1/AN15) ; also sheet 1
SDI2_COM: COMUNICACAO.20(RD1/CCP4/SDI2/SDA2/AN21) ; also sheet 9
SDI2_GERENC: COMUNICACAO.24(RC5/SDO1/AN17) ; also sheet 1
SDO2_COM: COMUNICACAO.27(RD4/P2D/SDO2/AN24) ; also sheet 9
SDO2_GERENC: COMUNICACAO.23(RC4/SDI1/SDA1/AN16) ; also sheet 1
TX1_COM: COMUNICACAO.25(RC6/TX1/CK1/AN18) ; also sheet 10
TX2_COMUN_RXD_BLUETO: COMUNICACAO.29(RD6/P1C/TX2/CK2/AN26) ; also sheet 10
Unconnected: COMUNICACAO.3(RA1/C12IN1-/AN1) COMUNICACAO.4(RA2/C2IN+/AN2/DACOUT/VREF-) COMUNICACAO.5(RA3/C1IN+/AN3/VREF+) COMUNICACAO.6(RA4/C1OUT/SRQ/TOCKI) COMUNICACAO.21(RD2/P2B/AN22) COMUNICACAO.22(RD3/P2C/~SS2/AN23) COMUNICACAO.28(RD5/P1B/AN25) JP5.4 JP5.6 U$19.P$7(DB1) U$19.P$8(DB0) U$19.P$9(DB2) U$19.P$10(DB3)

### Notes on the sheet
- PIC Comunicação
- Circuito Display
- MARK 1
- FACULDADE DE TECNOLOGIA DE 
                             SANTO ANDRÉ
  
          Rua Prefeito Justino Paixão, 150 - Centro  
              Santo André - SP - CEP:09020-130
                            (11) 4437-2216

## Sheet 9 of 20
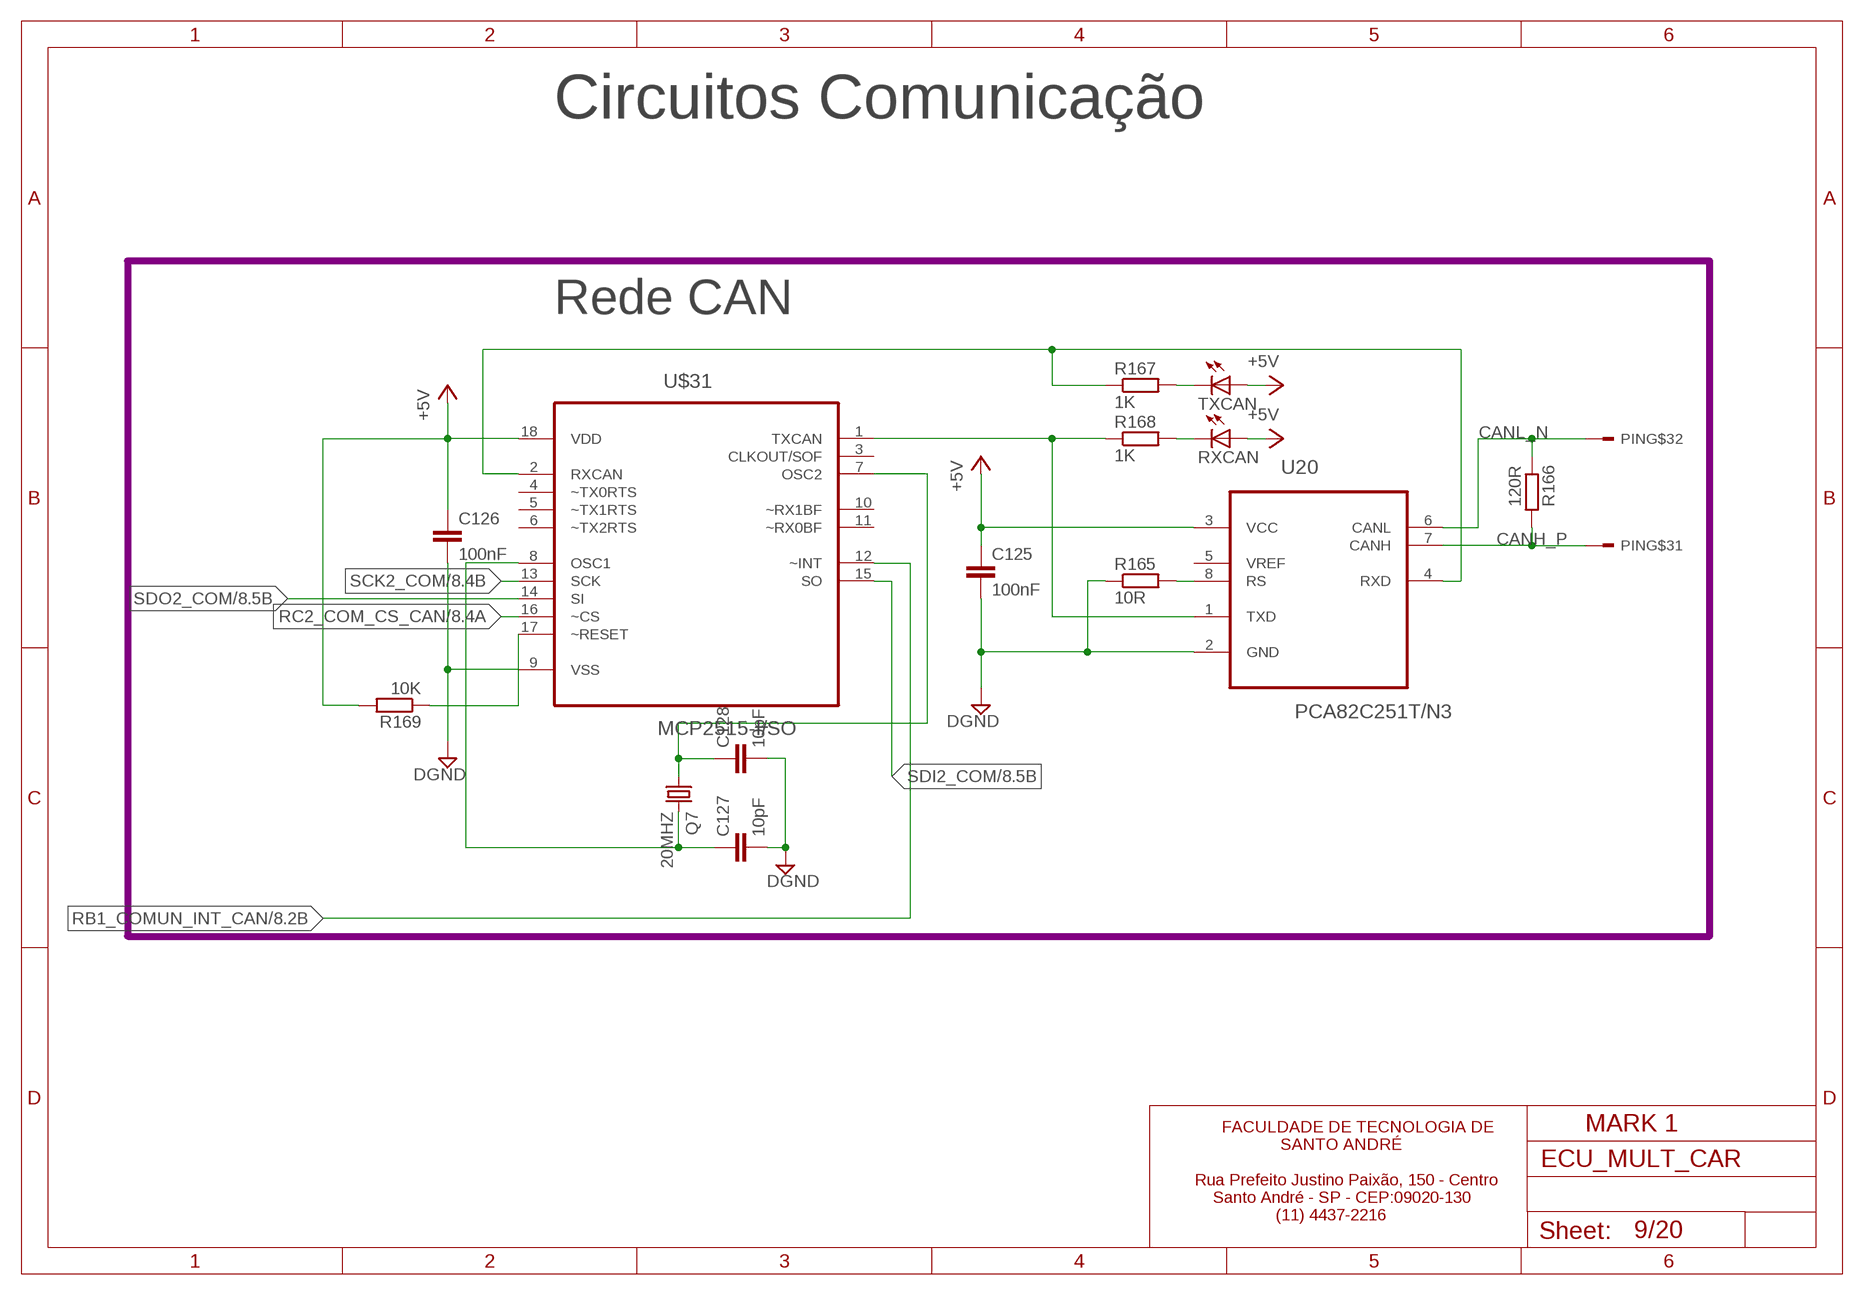
[diagram p8: schematic, sheet 9]

### Parts
C125  100nF  C-EUC0805  [C0805]
C126  100nF  C-EUC0805  [C0805]
C127  10pF  C-EUC0805  [C0805]
C128  10pF  C-EUC0805  [C0805]
Q7  20MHZ  CRYSTALSM49  [SM49]
R165  10R  R-EU_M0805  [M0805]
R166  120R  R-EU_M0805  [M0805]
R167  1K  R-EU_M0805  [M0805]
R168  1K  R-EU_M0805  [M0805]
R169  10K  R-EU_M0805  [M0805]
RXCAN  LEDKA-3528ASYC  [KA-3528ASYC]
TXCAN  LEDKA-3528ASYC  [KA-3528ASYC]
U20  PCA82C251T/N3  [SOIC127P600X175-8N]
U$31  MCP2515-I/SO  [SOIC127P1034X264-18N]

### Nets
+5V: C125.1 C126.1 R169.2 RXCAN.A TXCAN.A U20.3(VCC) U$31.18(VDD) ; also sheet 1,2,3,4,5,6,7,8,10,11,12,13,14,15,16,17,18,20
CANH_P: PIN.31 R166.2 U20.7(CANH)
CANL_N: PIN.32 R166.1 U20.6(CANL)
DGND: C125.2 C126.2 C127.2 C128.2 R165.1 U20.2(GND) U$31.9(VSS) ; also sheet 1,2,3,7,8,10,11,14,15,17,18,19,20
N$192: R165.2 U20.8(RS)
N$193: R167.2 TXCAN.C
N$194: R168.2 RXCAN.C
N$195: R168.1 U20.1(TXD) U$31.1(TXCAN)
N$196: R167.1 U20.4(RXD) U$31.2(RXCAN)
N$197: C127.1 Q7.2 U$31.8(OSC1)
N$198: C128.1 Q7.1 U$31.7(OSC2)
N$199: R169.1 U$31.17(~RESET)
RB1_COMUN_INT_CAN: U$31.12(~INT) ; also sheet 8
RC2_COM_CS_CAN: U$31.16(~CS) ; also sheet 8
SCK2_COM: U$31.13(SCK) ; also sheet 8
SDI2_COM: U$31.15(SO) ; also sheet 8
SDO2_COM: U$31.14(SI) ; also sheet 8
Unconnected: U20.5(VREF) U$31.3(CLKOUT/SOF) U$31.4(~TX0RTS) U$31.5(~TX1RTS) U$31.6(~TX2RTS) U$31.10(~RX1BF) U$31.11(~RX0BF)

### Notes on the sheet
- Circuitos Comunicação
- Rede CAN
- MARK 1
- FACULDADE DE TECNOLOGIA DE 
                             SANTO ANDRÉ
  
          Rua Prefeito Justino Paixão, 150 - Centro  
              Santo André - SP - CEP:09020-130
                            (11) 4437-2216

## Sheet 10 of 20
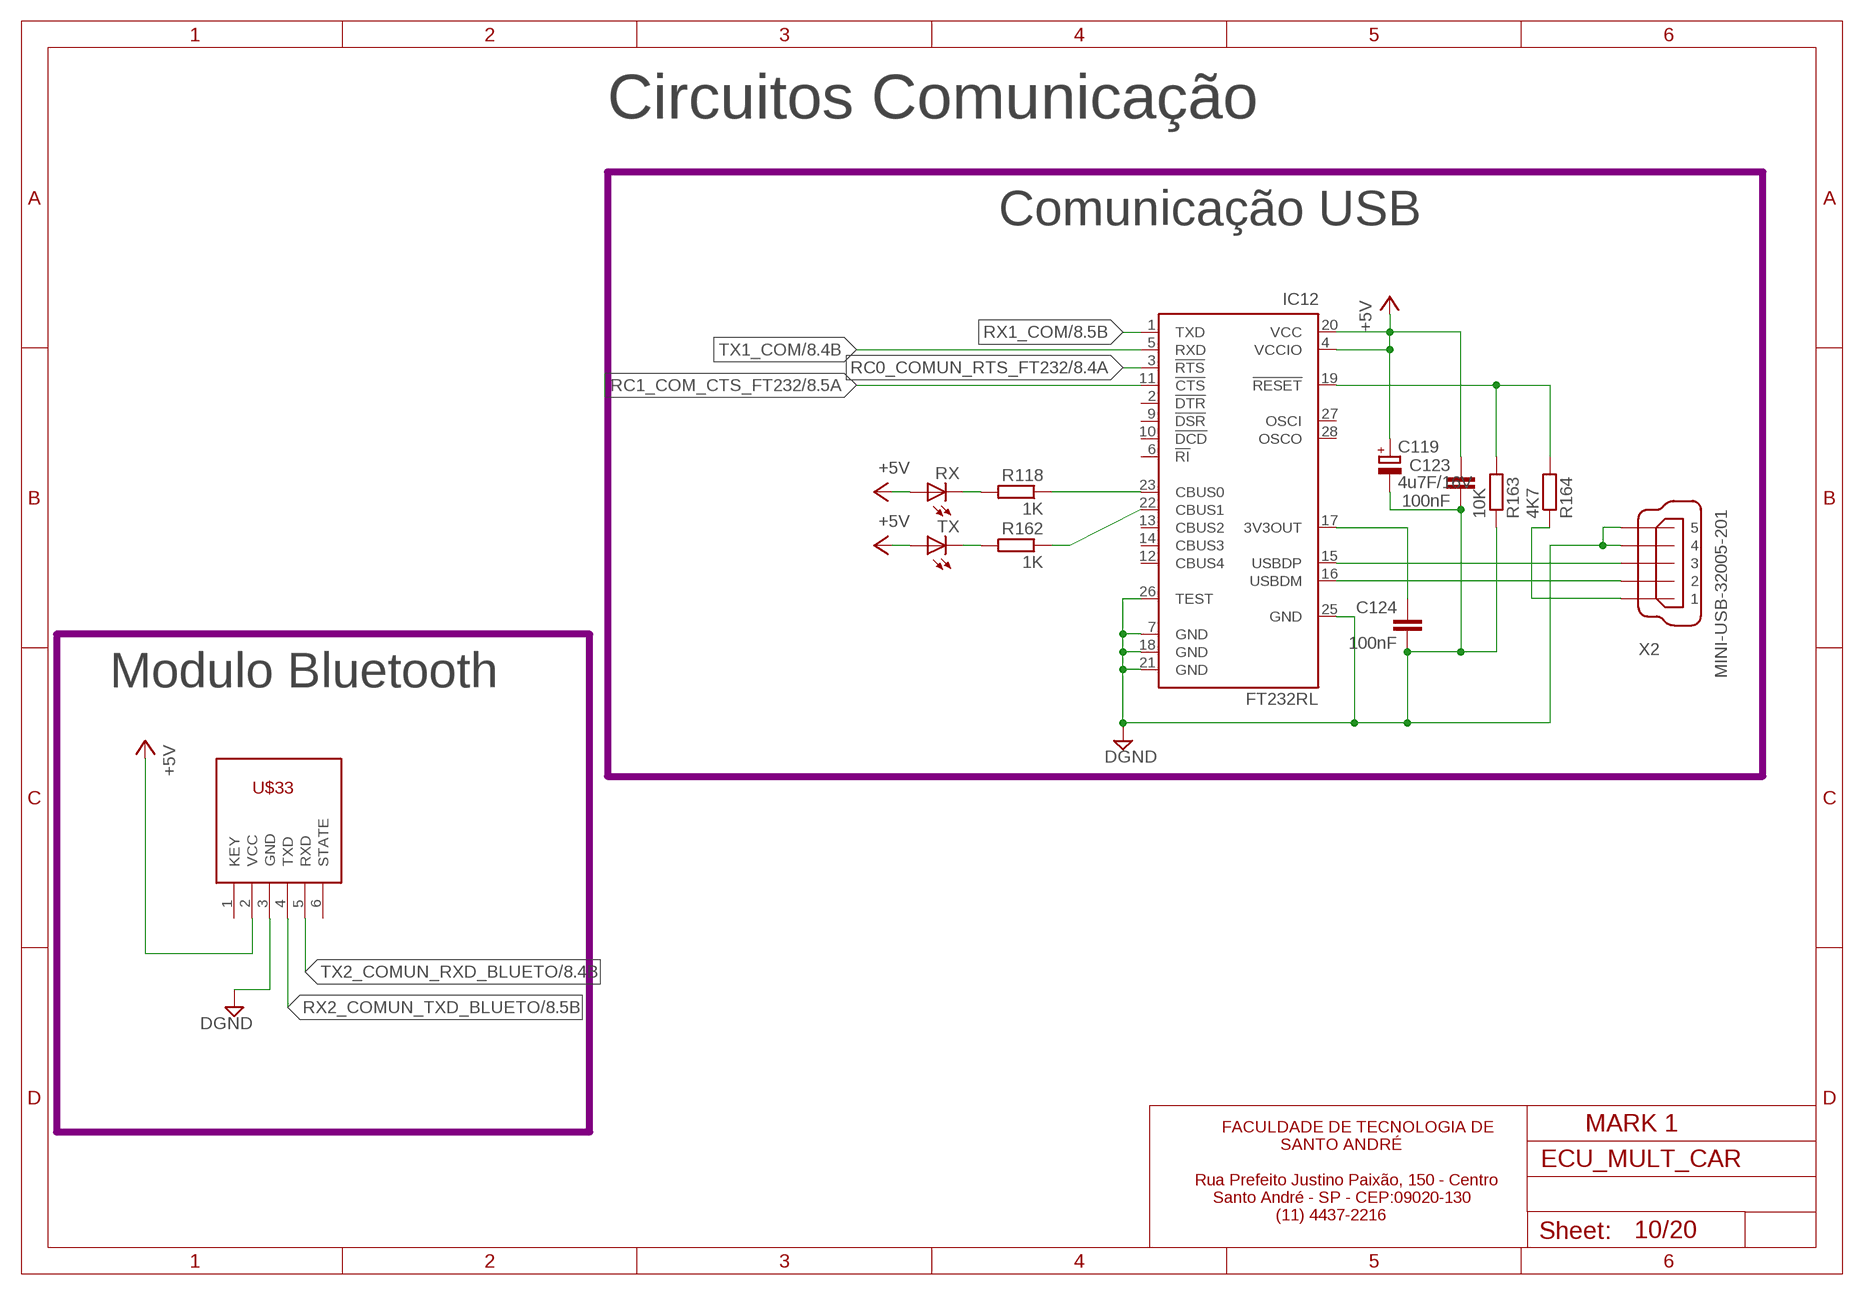
[diagram p9: schematic, sheet 10]

### Parts
C119  4u7F/16V  CPOL-EUE2.5-7  [E2,5-7]
C123  100nF  C-EUC0805  [C0805]
C124  100nF  C-EUC0805  [C0805]
IC12  FT232RL  [SSOP28]
R118  1K  R-EU_M0805  [M0805]
R162  1K  R-EU_M0805  [M0805]
R163  10K  R-EU_M0805  [M0805]
R164  4K7  R-EU_M0805  [M0805]
RX  LEDKA-3528ASYC  [KA-3528ASYC]
TX  LEDKA-3528ASYC  [KA-3528ASYC]
U$33  HC-06  [FE06]
X2  MINI-USB-32005-201  [32005-201]

### Nets
+5V: C119.+ C123.1 IC12.4(VCCIO) IC12.20(VCC) RX.A TX.A U$33.2(VCC) ; also sheet 1,2,3,4,5,6,7,8,9,11,12,13,14,15,16,17,18,20
DGND: C119.- C123.2 C124.2 IC12.7(GND) IC12.18(GND) IC12.21(GND) IC12.25(GND) IC12.26(TEST) R163.1 U$33.3(GND) X2.4 X2.5 ; also sheet 1,2,3,7,8,9,11,14,15,17,18,19,20
N$183: IC12.16(USBDM) X2.2
N$184: IC12.15(USBDP) X2.3
N$185: C124.1 IC12.17(3V3OUT)
N$186: R118.2 RX.C
N$187: IC12.23(CBUS0) R118.1
N$188: R162.2 TX.C
N$189: IC12.22(CBUS1) R162.1
N$190: IC12.19(!RESET) R163.2 R164.2
N$191: R164.1 X2.1
RC0_COMUN_RTS_FT232: IC12.3(!RTS) ; also sheet 8
RC1_COM_CTS_FT232: IC12.11(!CTS) ; also sheet 8
RX1_COM: IC12.1(TXD) ; also sheet 8
RX2_COMUN_TXD_BLUETO: U$33.4(TXD) ; also sheet 8
TX1_COM: IC12.5(RXD) ; also sheet 8
TX2_COMUN_RXD_BLUETO: U$33.5(RXD) ; also sheet 8
Unconnected: IC12.2(!DTR) IC12.6(!RI) IC12.9(!DSR) IC12.10(!DCD) IC12.12(CBUS4) IC12.13(CBUS2) IC12.14(CBUS3) IC12.27(OSCI) IC12.28(OSCO) U$33.1(KEY) U$33.6(STATE)

### Notes on the sheet
- Circuitos Comunicação
- Comunicação USB
- Modulo Bluetooth
- MARK 1
- FACULDADE DE TECNOLOGIA DE 
                             SANTO ANDRÉ
  
          Rua Prefeito Justino Paixão, 150 - Centro  
              Santo André - SP - CEP:09020-130
                            (11) 4437-2216

## Sheet 11 of 20
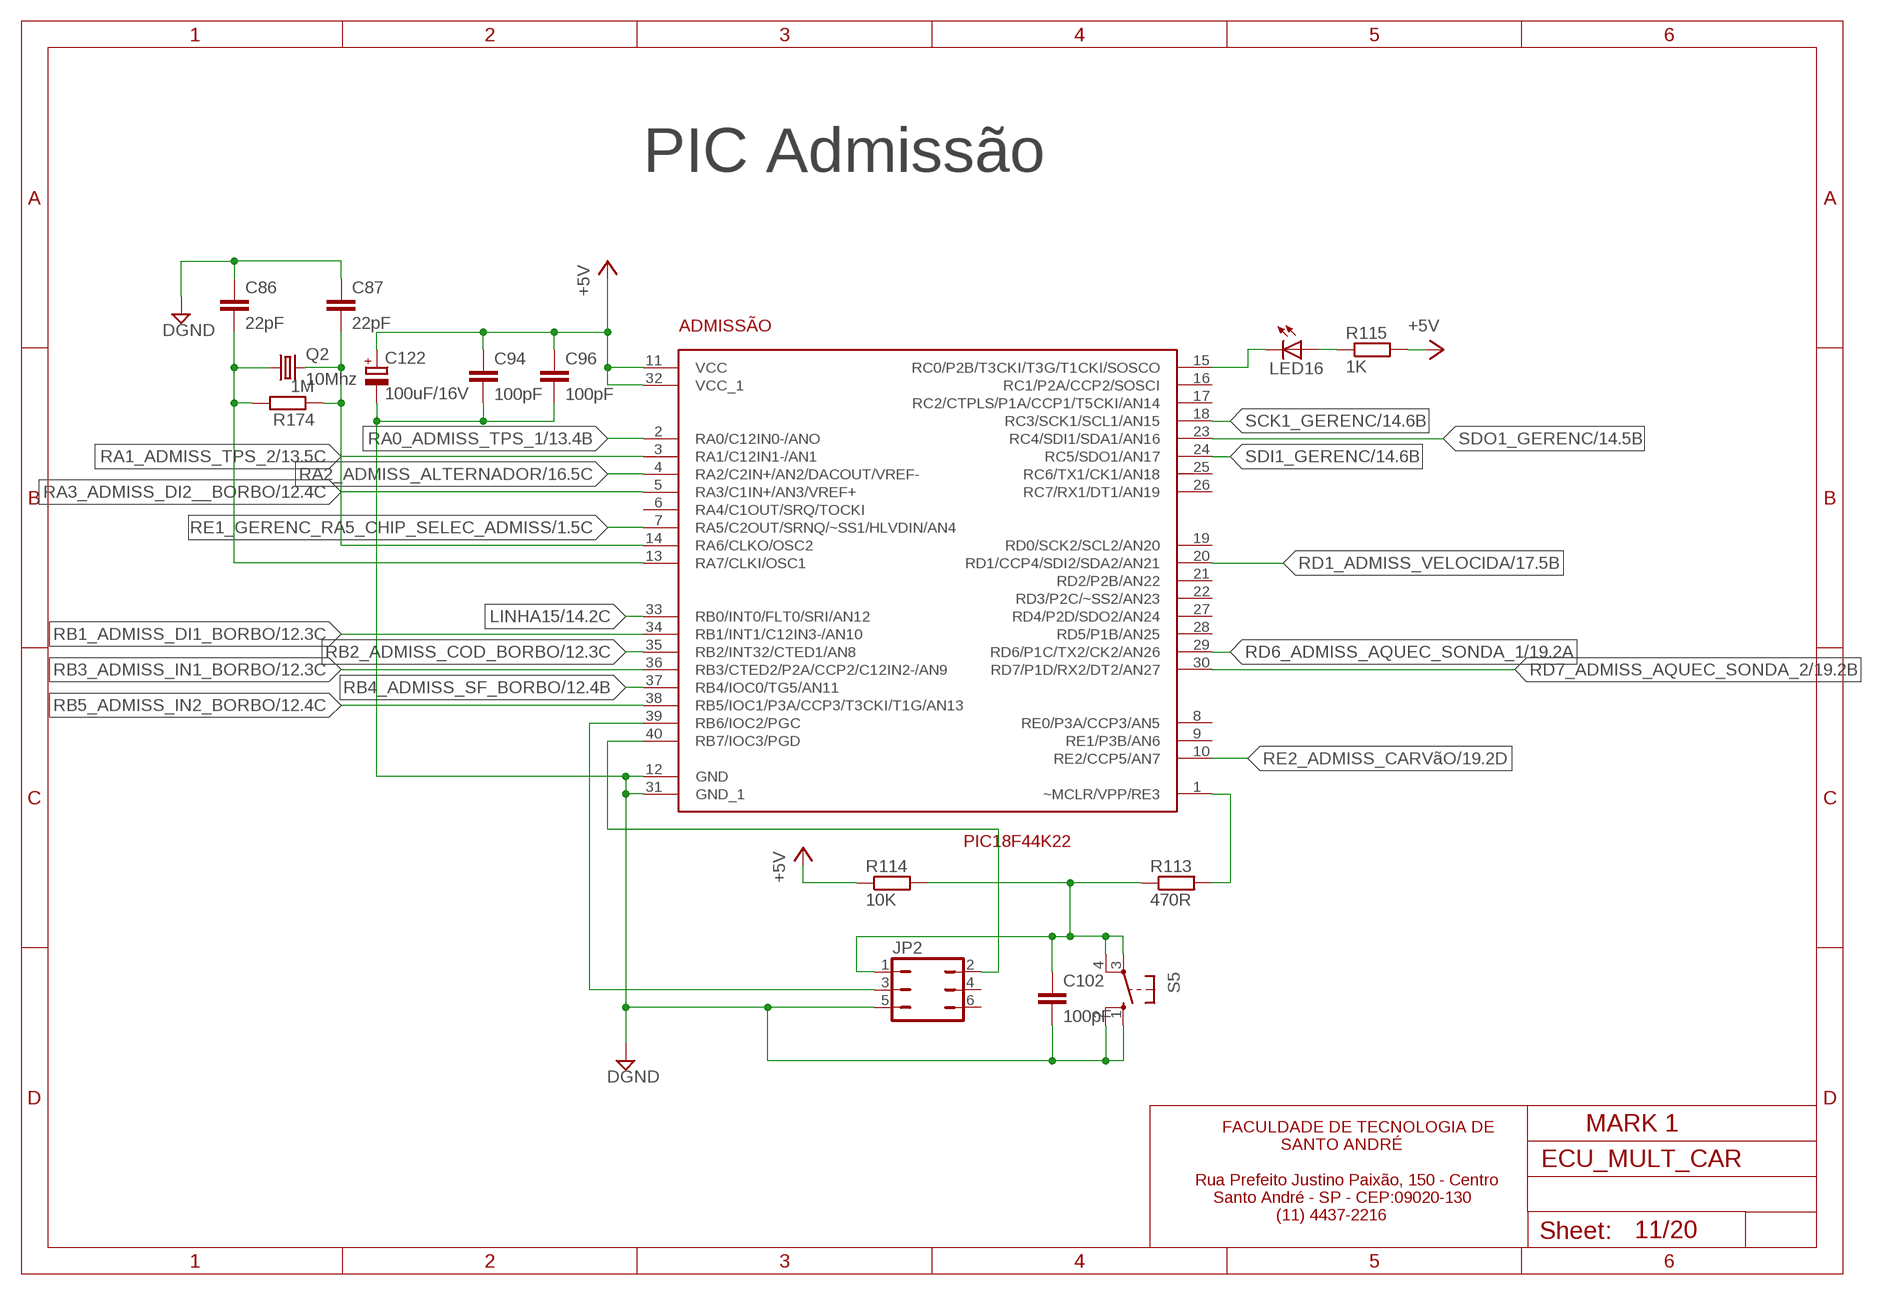
[diagram p10: schematic, sheet 11]

### Parts
ADMISSÃO  PIC18F44K22  [DIP40]
C86  22pF  C-EUC0805  [C0805]
C87  22pF  C-EUC0805  [C0805]
C94  100pF  C-EUC0805  [C0805]
C96  100pF  C-EUC0805  [C0805]
C102  100pF  C-EUC0805  [C0805]
C122  100uF/16V  CPOL-EUE2.5-7  [E2,5-7]
JP2  JP3Q  [JP3Q]
LED16  LEDKA-3528ASYC  [KA-3528ASYC]
Q2  10Mhz  CRYSTALSM49  [SM49]
R113  470R  R-EU_M0805  [M0805]
R114  10K  R-EU_M0805  [M0805]
R115  1K  R-EU_M0805  [M0805]
R174  1M  R-EU_M0805  [M0805]
S5  10-XX  [B3F-10XX]

### Nets
+5V: ADMISSÃO.11(VCC) ADMISSÃO.32(VCC_1) C94.1 C96.1 C122.+ R114.1 R115.2 ; also sheet 1,2,3,4,5,6,7,8,9,10,12,13,14,15,16,17,18,20
DGND: ADMISSÃO.12(GND) ADMISSÃO.31(GND_1) C86.1 C87.1 C94.2 C96.2 C102.2 C122.- JP2.5 S5.1(S) S5.2(S1) ; also sheet 1,2,3,7,8,9,10,14,15,17,18,19,20
LINHA15: ADMISSÃO.33(RB0/INT0/FLT0/SRI/AN12) ; also sheet 1,8,14,17
N$106: ADMISSÃO.15(RC0/P2B/T3CKI/T3G/T1CKI/SOSCO) LED16.C
N$121: LED16.A R115.1
N$125: ADMISSÃO.13(RA7/CLKI/OSC1) C86.2 Q2.1 R174.2
N$126: ADMISSÃO.1(~MCLR/VPP/RE3) R113.2
N$127: C102.1 JP2.1 R113.1 R114.2 S5.3(P) S5.4(P1)
N$130: ADMISSÃO.14(RA6/CLKO/OSC2) C87.2 Q2.2 R174.1
RA0_ADMISS_TPS_1: ADMISSÃO.2(RA0/C12IN0-/ANO) ; also sheet 13
RA1_ADMISS_TPS_2: ADMISSÃO.3(RA1/C12IN1-/AN1) ; also sheet 13
RA2_ADMISS_ALTERNADOR: ADMISSÃO.4(RA2/C2IN+/AN2/DACOUT/VREF-) ; also sheet 16
RA3_ADMISS_DI2__BORBO: ADMISSÃO.5(RA3/C1IN+/AN3/VREF+) ; also sheet 12
RB1_ADMISS_DI1_BORBO: ADMISSÃO.34(RB1/INT1/C12IN3-/AN10) ; also sheet 12
RB2_ADMISS_COD_BORBO: ADMISSÃO.35(RB2/INT32/CTED1/AN8) ; also sheet 12
RB3_ADMISS_IN1_BORBO: ADMISSÃO.36(RB3/CTED2/P2A/CCP2/C12IN2-/AN9) ; also sheet 12
RB4_ADMISS_SF_BORBO: ADMISSÃO.37(RB4/IOC0/TG5/AN11) ; also sheet 12
RB5_ADMISS_IN2_BORBO: ADMISSÃO.38(RB5/IOC1/P3A/CCP3/T3CKI/T1G/AN13) ; also sheet 12
RB6_ADMISS: ADMISSÃO.39(RB6/IOC2/PGC) JP2.3
RB7_ADMISS: ADMISSÃO.40(RB7/IOC3/PGD) JP2.2
RD1_ADMISS_VELOCIDA: ADMISSÃO.20(RD1/CCP4/SDI2/SDA2/AN21) ; also sheet 17
RD6_ADMISS_AQUEC_SONDA_1: ADMISSÃO.29(RD6/P1C/TX2/CK2/AN26) ; also sheet 19
RD7_ADMISS_AQUEC_SONDA_2: ADMISSÃO.30(RD7/P1D/RX2/DT2/AN27) ; also sheet 19
RE1_GERENC_RA5_CHIP_SELEC_ADMISS: ADMISSÃO.7(RA5/C2OUT/SRNQ/~SS1/HLVDIN/AN4) ; also sheet 1
RE2_ADMISS_CARVãO: ADMISSÃO.10(RE2/CCP5/AN7) ; also sheet 19
SCK1_GERENC: ADMISSÃO.18(RC3/SCK1/SCL1/AN15) ; also sheet 1,2,14,15
SDI1_GERENC: ADMISSÃO.24(RC5/SDO1/AN17) ; also sheet 1,2,14,15
SDO1_GERENC: ADMISSÃO.23(RC4/SDI1/SDA1/AN16) ; also sheet 1,2,14,15
Unconnected: ADMISSÃO.6(RA4/C1OUT/SRQ/TOCKI) ADMISSÃO.8(RE0/P3A/CCP3/AN5) ADMISSÃO.9(RE1/P3B/AN6) ADMISSÃO.16(RC1/P2A/CCP2/SOSCI) ADMISSÃO.17(RC2/CTPLS/P1A/CCP1/T5CKI/AN14) ADMISSÃO.19(RD0/SCK2/SCL2/AN20) ADMISSÃO.21(RD2/P2B/AN22) ADMISSÃO.22(RD3/P2C/~SS2/AN23) ADMISSÃO.25(RC6/TX1/CK1/AN18) ADMISSÃO.26(RC7/RX1/DT1/AN19) ADMISSÃO.27(RD4/P2D/SDO2/AN24) ADMISSÃO.28(RD5/P1B/AN25) JP2.4 JP2.6

### Notes on the sheet
- PIC Admissão
- MARK 1
- FACULDADE DE TECNOLOGIA DE 
                             SANTO ANDRÉ
  
          Rua Prefeito Justino Paixão, 150 - Centro  
              Santo André - SP - CEP:09020-130
                            (11) 4437-2216

## Sheet 12 of 20
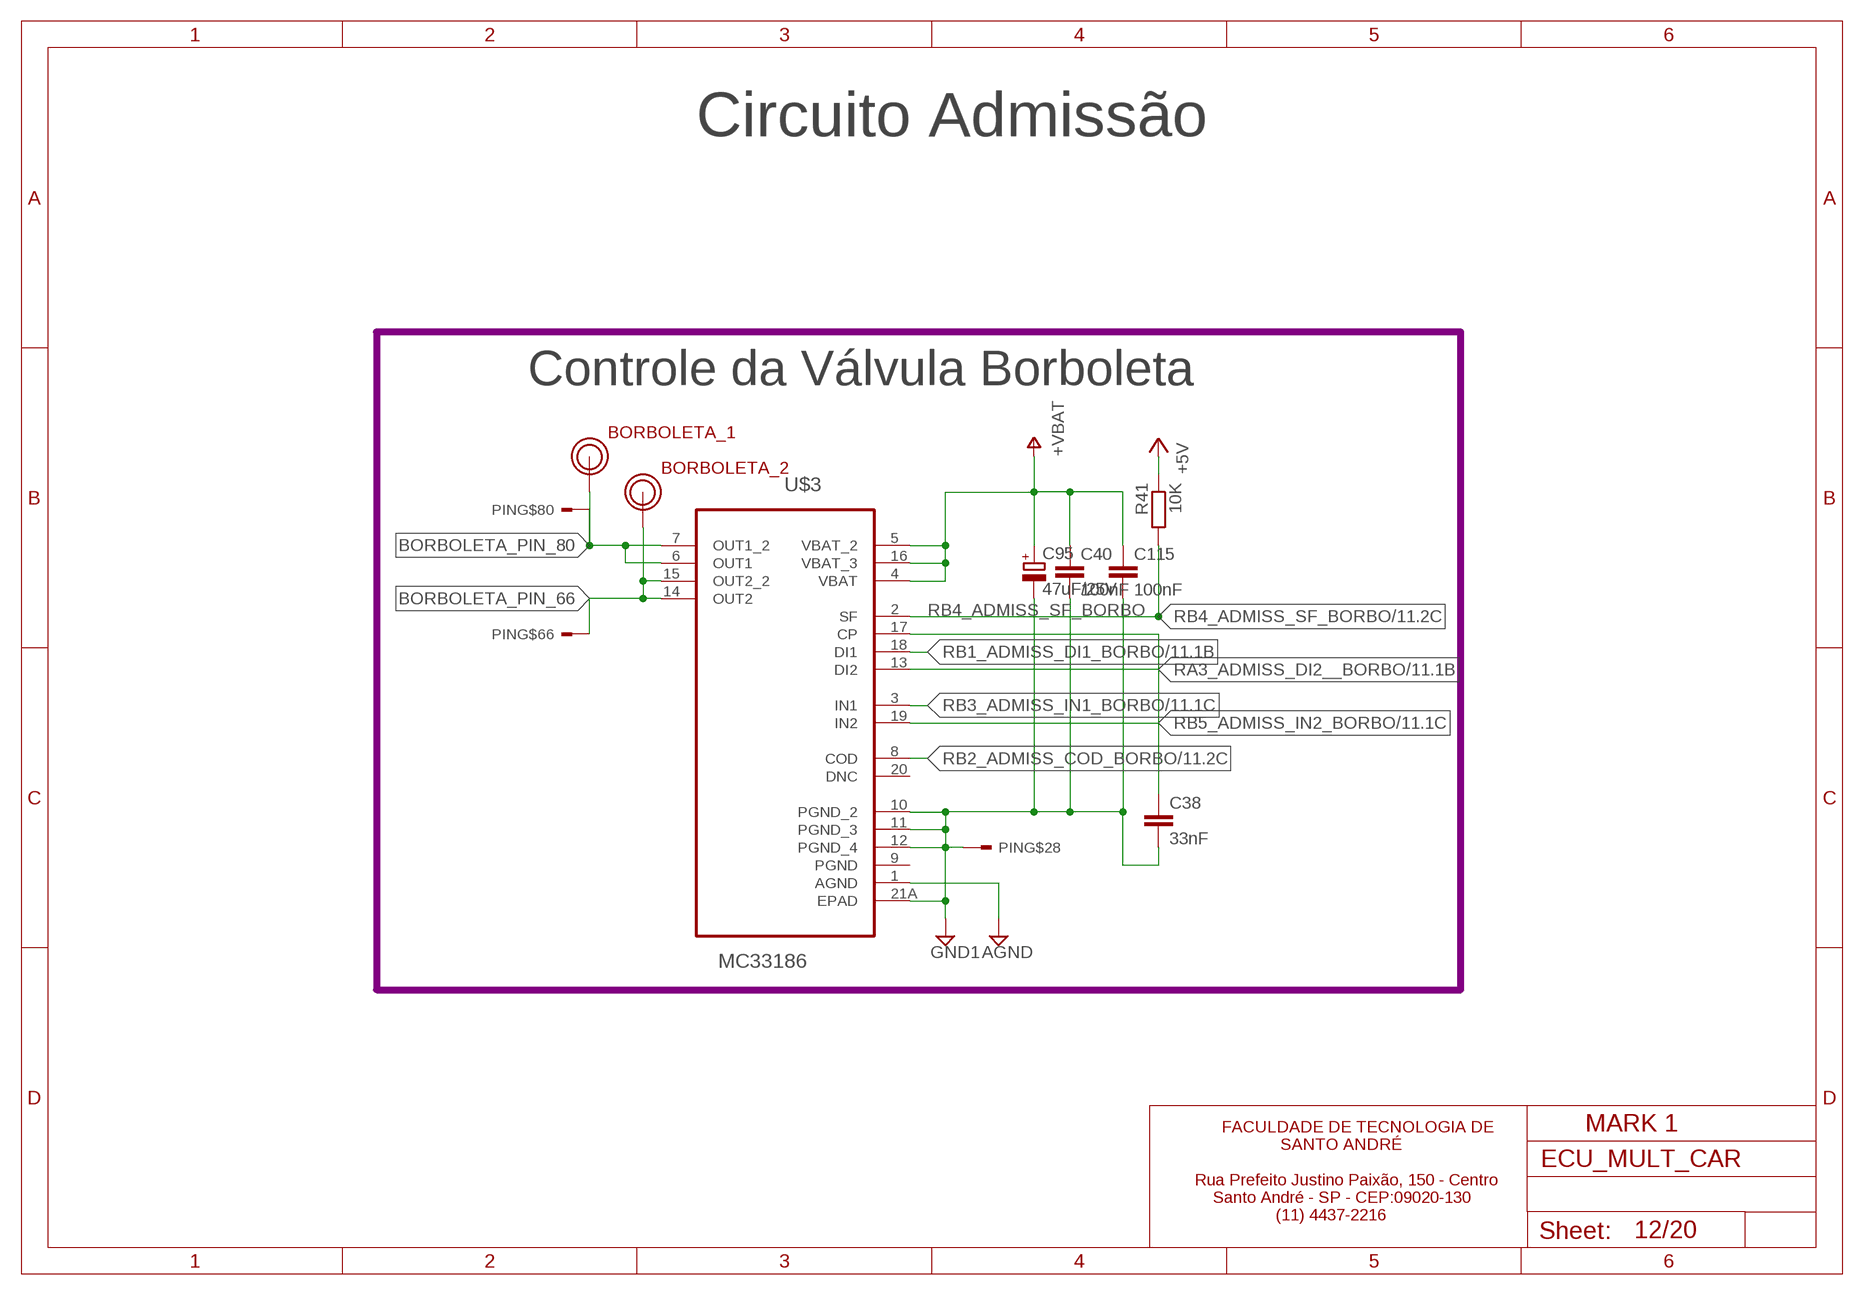
[diagram p11: schematic, sheet 12]

### Parts
BORBOLETA_1  PINO_TORNEADO  [PINO_TORNEADO]
BORBOLETA_2  PINO_TORNEADO  [PINO_TORNEADO]
C38  33nF  C-EUC0805  [C0805]
C40  100nF  C-EUC0805  [C0805]
C95  47uF/25V  CPOL-EUE2.5-7  [E2,5-7]
C115  100nF  C-EUC0805  [C0805]
R41  10K  R-EU_M0805  [M0805]
U$3  MC33186  [HSOP-20-PIN]

### Nets
+5V: R41.1 ; also sheet 1,2,3,4,5,6,7,8,9,10,11,13,14,15,16,17,18,20
BORBOLETA_PIN_66: BORBOLETA_2.1(PINO1) PIN.66 U$3.14(OUT2) U$3.15(OUT2_2)
BORBOLETA_PIN_80: BORBOLETA_1.1(PINO1) PIN.80 U$3.6(OUT1) U$3.7(OUT1_2)
GND3: U$3.1(AGND) ; supply symbol labelled AGND ; also sheet 2,4,5,6,13,16,20
IGND: C38.2 C40.2 C95.- C115.2 PIN.28 U$3.10(PGND_2) U$3.11(PGND_3) U$3.12(PGND_4) U$3.21A(EPAD) ; supply symbol labelled GND1 ; also sheet 15
LINHA_15_PIN27: C40.1 C95.+ C115.1 U$3.4(VBAT) U$3.5(VBAT_2) U$3.16(VBAT_3) ; supply symbol labelled +VBAT ; also sheet 6,17
N$47: C38.1 U$3.17(CP)
RA3_ADMISS_DI2__BORBO: U$3.13(DI2) ; also sheet 11
RB1_ADMISS_DI1_BORBO: U$3.18(DI1) ; also sheet 11
RB2_ADMISS_COD_BORBO: U$3.8(COD) ; also sheet 11
RB3_ADMISS_IN1_BORBO: U$3.3(IN1) ; also sheet 11
RB4_ADMISS_SF_BORBO: R41.2 U$3.2(SF) ; also sheet 11
RB5_ADMISS_IN2_BORBO: U$3.19(IN2) ; also sheet 11
Unconnected: U$3.9(PGND) U$3.20(DNC)

### Notes on the sheet
- Circuito Admissão
- Controle da Válvula Borboleta
- MARK 1
- FACULDADE DE TECNOLOGIA DE 
                             SANTO ANDRÉ
  
          Rua Prefeito Justino Paixão, 150 - Centro  
              Santo André - SP - CEP:09020-130
                            (11) 4437-2216

## Sheet 13 of 20
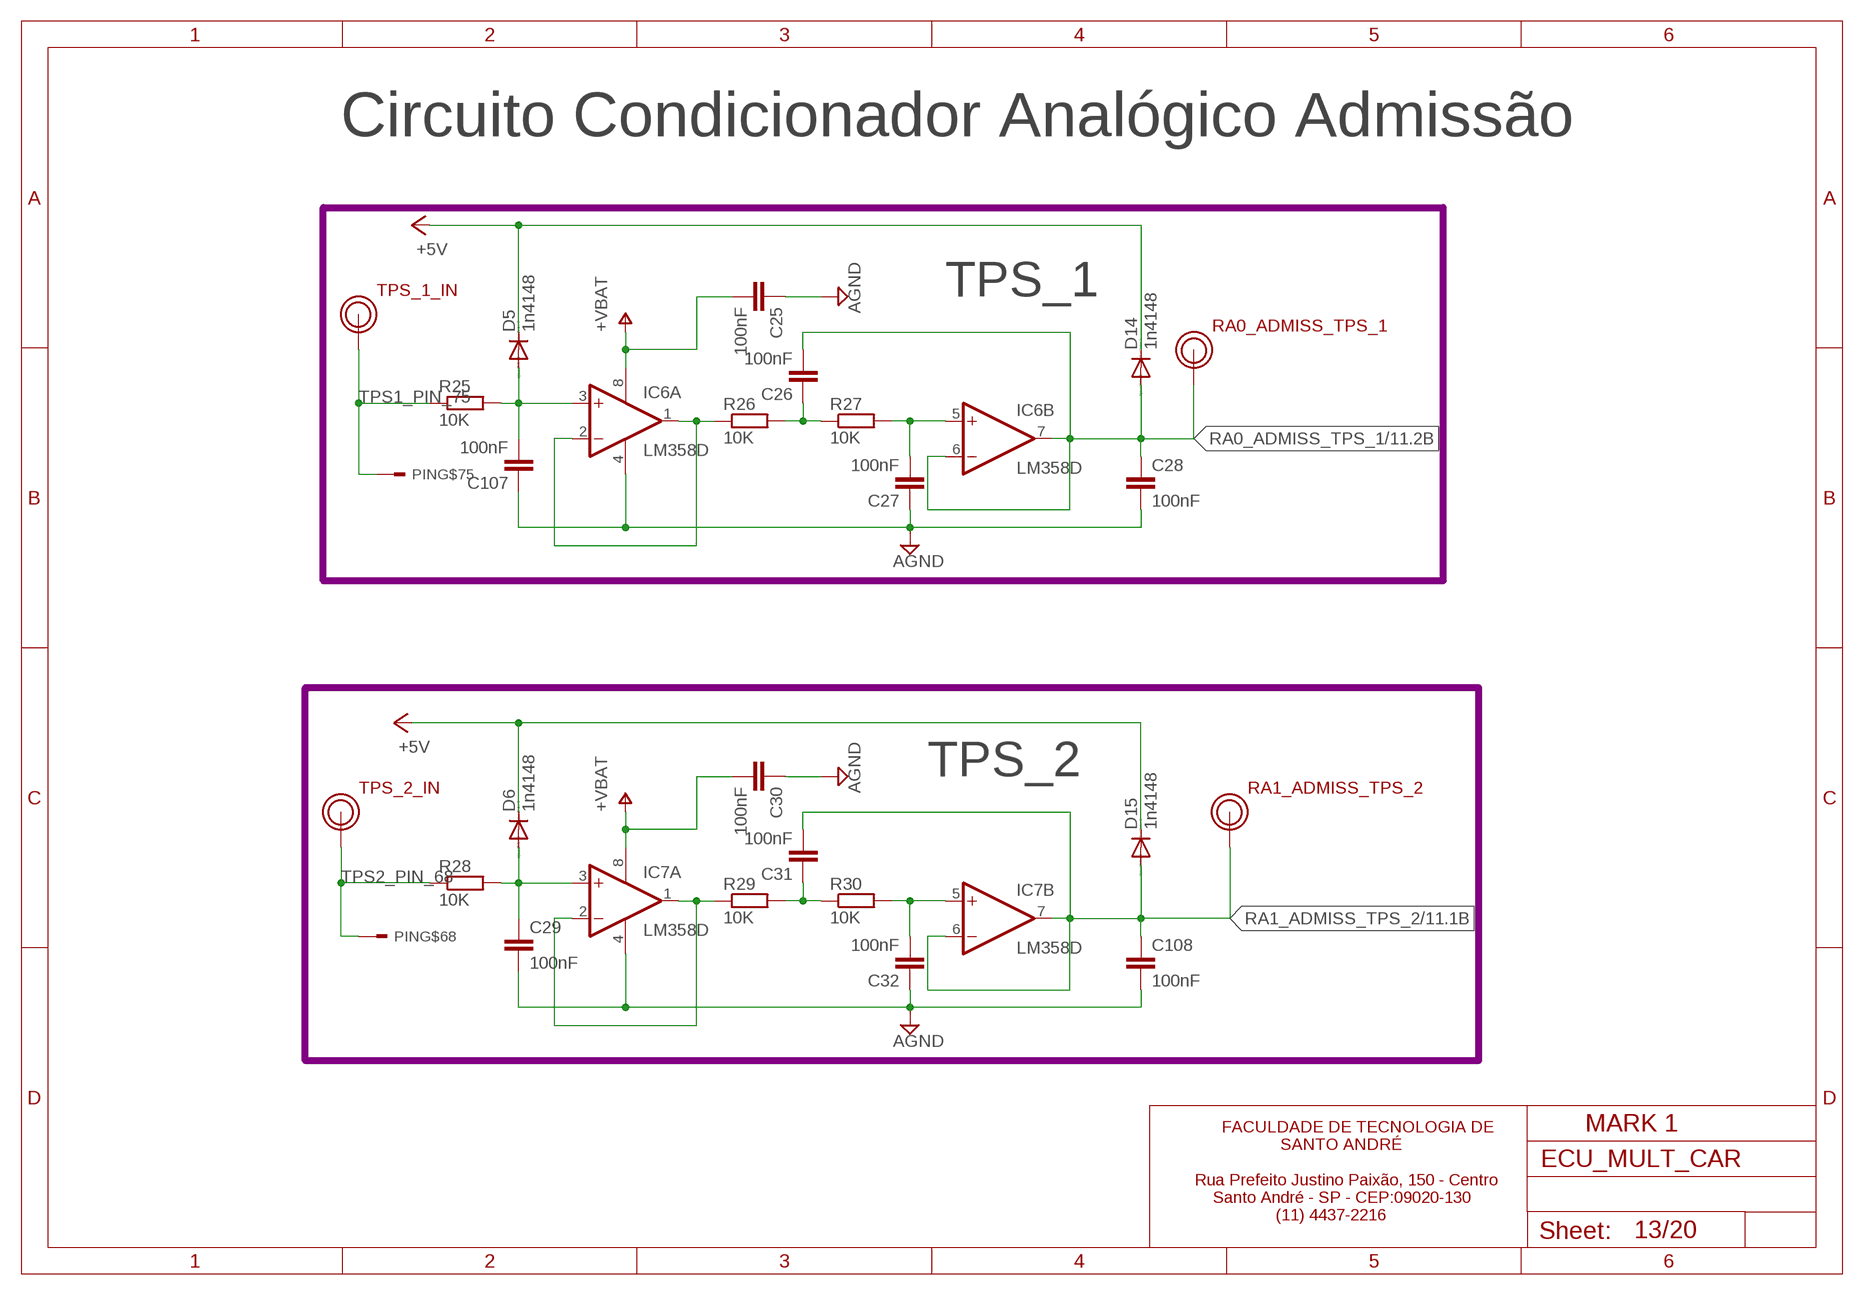
[diagram p12: schematic, sheet 13]

### Parts
C25  100nF  C-EUC0805  [C0805]
C26  100nF  C-EUC0805  [C0805]
C27  100nF  C-EUC0805  [C0805]
C28  100nF  C-EUC0805  [C0805]
C29  100nF  C-EUC0805  [C0805]
C30  100nF  C-EUC0805  [C0805]
C31  100nF  C-EUC0805  [C0805]
C32  100nF  C-EUC0805  [C0805]
C107  100nF  C-EUC0805  [C0805]
C108  100nF  C-EUC0805  [C0805]
D5  1n4148  DIODE-MINIMELF  [MINIMELF]
D6  1n4148  DIODE-MINIMELF  [MINIMELF]
D14  1n4148  DIODE-MINIMELF  [MINIMELF]
D15  1n4148  DIODE-MINIMELF  [MINIMELF]
IC6  LM358D  [SO08]
IC7  LM358D  [SO08]
R25  10K  R-EU_M0805  [M0805]
R26  10K  R-EU_M0805  [M0805]
R27  10K  R-EU_M0805  [M0805]
R28  10K  R-EU_M0805  [M0805]
R29  10K  R-EU_M0805  [M0805]
R30  10K  R-EU_M0805  [M0805]
RA0_ADMISS_TPS_1  PINO_TORNEADO  [PINO_TORNEADO]
RA1_ADMISS_TPS_2  PINO_TORNEADO  [PINO_TORNEADO]
TPS_1_IN  PINO_TORNEADO  [PINO_TORNEADO]
TPS_2_IN  PINO_TORNEADO  [PINO_TORNEADO]

### Nets
+5V: D5.C D6.C D14.C D15.C ; also sheet 1,2,3,4,5,6,7,8,9,10,11,12,14,15,16,17,18,20
GND3: C25.1 C27.1 C28.2 C29.2 C30.1 C32.1 C107.1 C108.2 IC6.4(P:V-) IC7.4(P:V-) ; supply symbol labelled AGND ; also sheet 2,4,5,6,12,16,20
N$29: C107.2 D5.A IC6.3(A:+IN) R25.2
N$30: IC6.1(A:OUT) IC6.2(A:-IN) R26.1
N$31: C26.1 R26.2 R27.1
N$32: C27.2 IC6.5(B:+IN) R27.2
N$33: C29.1 D6.A IC7.3(A:+IN) R28.2
N$34: IC7.1(A:OUT) IC7.2(A:-IN) R29.1
N$35: C31.1 R29.2 R30.1
N$36: C32.2 IC7.5(B:+IN) R30.2
RA0_ADMISS_TPS_1: C26.2 C28.1 D14.A IC6.6(B:-IN) IC6.7(B:OUT) RA0_ADMISS_TPS_1.1(PINO1) ; also sheet 11
RA1_ADMISS_TPS_2: C31.2 C108.1 D15.A IC7.6(B:-IN) IC7.7(B:OUT) RA1_ADMISS_TPS_2.1(PINO1) ; also sheet 11
TPS1_PIN_75: PIN.75 R25.1 TPS_1_IN.1(PINO1)
TPS2_PIN_68: PIN.68 R28.1 TPS_2_IN.1(PINO1)
V+: C25.2 C30.2 IC6.8(P:V+) IC7.8(P:V+) ; supply symbol labelled +VBAT ; also sheet 2,3,4,5,6,15,16

### Notes on the sheet
- Circuito Condicionador Analógico Admissão
- TPS_1
- TPS_2
- MARK 1
- FACULDADE DE TECNOLOGIA DE 
                             SANTO ANDRÉ
  
          Rua Prefeito Justino Paixão, 150 - Centro  
              Santo André - SP - CEP:09020-130
                            (11) 4437-2216

## Sheet 14 of 20
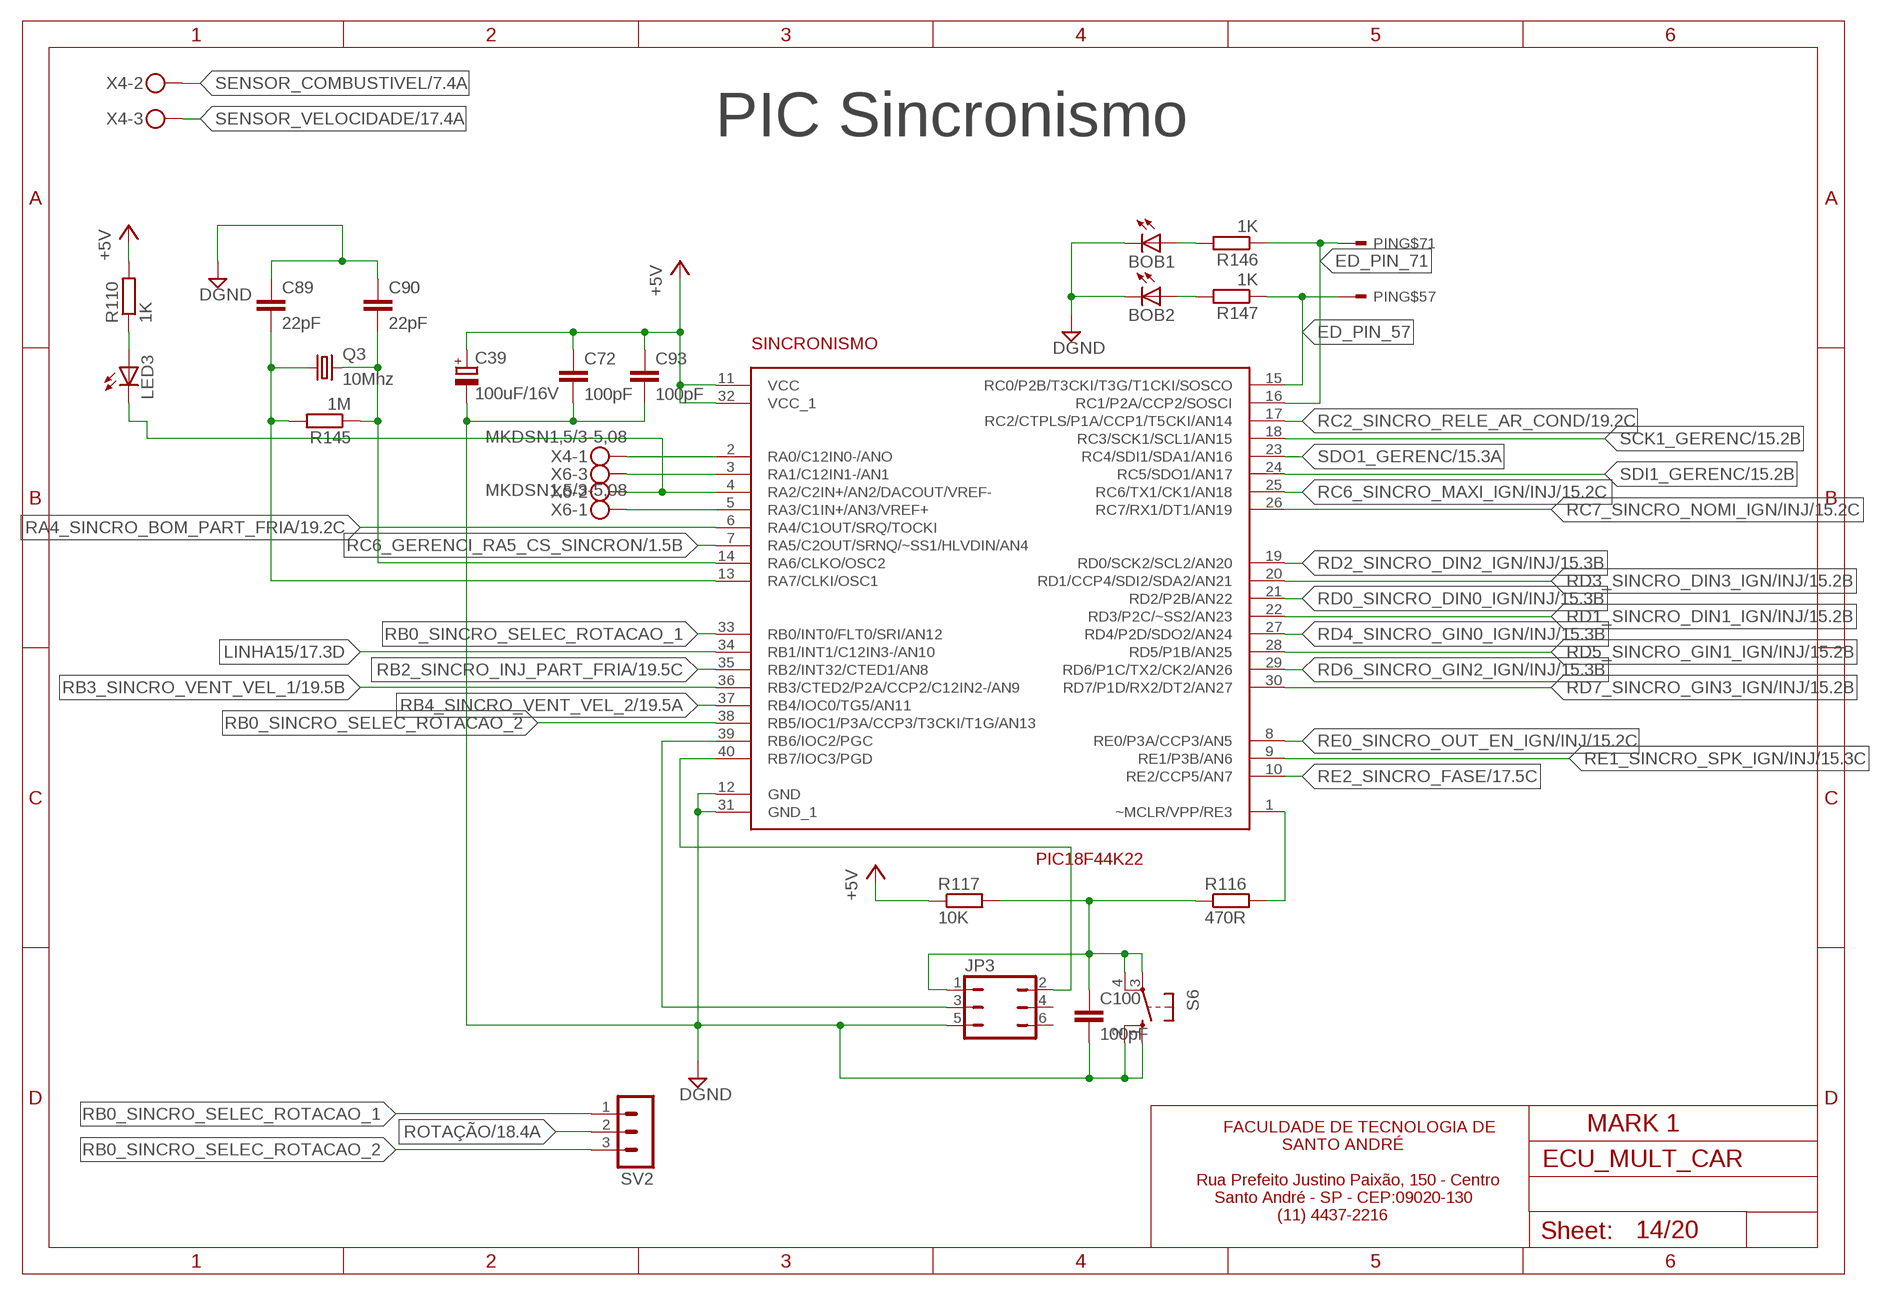
[diagram p13: schematic, sheet 14]

### Parts
BOB1  LEDKA-3528ASYC  [KA-3528ASYC]
BOB2  LEDKA-3528ASYC  [KA-3528ASYC]
C39  100uF/16V  CPOL-EUE2.5-7  [E2,5-7]
C72  100pF  C-EUC0805  [C0805]
C89  22pF  C-EUC0805  [C0805]
C90  22pF  C-EUC0805  [C0805]
C93  100pF  C-EUC0805  [C0805]
C100  100pF  C-EUC0805  [C0805]
JP3  JP3Q  [JP3Q]
LED3  LEDKA-3528ASYC  [KA-3528ASYC]
Q3  10Mhz  CRYSTALSM49  [SM49]
R110  1K  R-EU_M0805  [M0805]
R116  470R  R-EU_M0805  [M0805]
R117  10K  R-EU_M0805  [M0805]
R145  1M  R-EU_M0805  [M0805]
R146  1K  R-EU_M0805  [M0805]
R147  1K  R-EU_M0805  [M0805]
S6  10-XX  [B3F-10XX]
SINCRONISMO  PIC18F44K22  [DIP40]
SV2  MA03-1  [MA03-1]
X4  MKDSN1,5/3-5,08  [MKDSN1,5/3-5,08]
X6  MKDSN1,5/3-5,08  [MKDSN1,5/3-5,08]

### Nets
+5V: C39.+ C72.1 C93.1 R110.2 R117.1 SINCRONISMO.11(VCC) SINCRONISMO.32(VCC_1) ; also sheet 1,2,3,4,5,6,7,8,9,10,11,12,13,15,16,17,18,20
DGND: BOB1.C BOB2.C C39.- C72.2 C89.1 C90.1 C93.2 C100.2 JP3.5 S6.1(S) S6.2(S1) SINCRONISMO.12(GND) SINCRONISMO.31(GND_1) ; also sheet 1,2,3,7,8,9,10,11,15,17,18,19,20
ED_PIN_57: PIN.57 R147.1 SINCRONISMO.15(RC0/P2B/T3CKI/T3G/T1CKI/SOSCO)
ED_PIN_71: PIN.71 R146.1 SINCRONISMO.16(RC1/P2A/CCP2/SOSCI)
LINHA15: SINCRONISMO.34(RB1/INT1/C12IN3-/AN10) ; also sheet 1,8,11,17
N$20: BOB1.A R146.2
N$51: BOB2.A R147.2
N$52: C89.2 Q3.1 R145.2 SINCRONISMO.13(RA7/CLKI/OSC1)
N$97: SINCRONISMO.2(RA0/C12IN0-/ANO) X4.1
N$98: LED3.A R110.1
N$123: C90.2 Q3.2 R145.1 SINCRONISMO.14(RA6/CLKO/OSC2)
N$131: LED3.C SINCRONISMO.4(RA2/C2IN+/AN2/DACOUT/VREF-) X6.2
N$134: R116.2 SINCRONISMO.1(~MCLR/VPP/RE3)
N$135: C100.1 JP3.1 R116.1 R117.2 S6.3(P) S6.4(P1)
N$136: JP3.2 SINCRONISMO.40(RB7/IOC3/PGD)
N$137: JP3.3 SINCRONISMO.39(RB6/IOC2/PGC)
N$140: SINCRONISMO.3(RA1/C12IN1-/AN1) X6.3
N$181: SINCRONISMO.5(RA3/C1IN+/AN3/VREF+) X6.1
RA4_SINCRO_BOM_PART_FRIA: SINCRONISMO.6(RA4/C1OUT/SRQ/TOCKI) ; also sheet 19
RB0_SINCRO_SELEC_ROTACAO_1: SINCRONISMO.33(RB0/INT0/FLT0/SRI/AN12) SV2.1
RB0_SINCRO_SELEC_ROTACAO_2: SINCRONISMO.38(RB5/IOC1/P3A/CCP3/T3CKI/T1G/AN13) SV2.3
RB2_SINCRO_INJ_PART_FRIA: SINCRONISMO.35(RB2/INT32/CTED1/AN8) ; also sheet 19
RB3_SINCRO_VENT_VEL_1: SINCRONISMO.36(RB3/CTED2/P2A/CCP2/C12IN2-/AN9) ; also sheet 19
RB4_SINCRO_VENT_VEL_2: SINCRONISMO.37(RB4/IOC0/TG5/AN11) ; also sheet 19
RC2_SINCRO_RELE_AR_COND: SINCRONISMO.17(RC2/CTPLS/P1A/CCP1/T5CKI/AN14) ; also sheet 19
RC6_GERENCI_RA5_CS_SINCRON: SINCRONISMO.7(RA5/C2OUT/SRNQ/~SS1/HLVDIN/AN4) ; also sheet 1
RC6_SINCRO_MAXI_IGN/INJ: SINCRONISMO.25(RC6/TX1/CK1/AN18) ; also sheet 15
RC7_SINCRO_NOMI_IGN/INJ: SINCRONISMO.26(RC7/RX1/DT1/AN19) ; also sheet 15
RD0_SINCRO_DIN0_IGN/INJ: SINCRONISMO.21(RD2/P2B/AN22) ; also sheet 15
RD1_SINCRO_DIN1_IGN/INJ: SINCRONISMO.22(RD3/P2C/~SS2/AN23) ; also sheet 15
RD2_SINCRO_DIN2_IGN/INJ: SINCRONISMO.19(RD0/SCK2/SCL2/AN20) ; also sheet 15
RD3_SINCRO_DIN3_IGN/INJ: SINCRONISMO.20(RD1/CCP4/SDI2/SDA2/AN21) ; also sheet 15
RD4_SINCRO_GIN0_IGN/INJ: SINCRONISMO.27(RD4/P2D/SDO2/AN24) ; also sheet 15
RD5_SINCRO_GIN1_IGN/INJ: SINCRONISMO.28(RD5/P1B/AN25) ; also sheet 15
RD6_SINCRO_GIN2_IGN/INJ: SINCRONISMO.29(RD6/P1C/TX2/CK2/AN26) ; also sheet 15
RD7_SINCRO_GIN3_IGN/INJ: SINCRONISMO.30(RD7/P1D/RX2/DT2/AN27) ; also sheet 15
RE0_SINCRO_OUT_EN_IGN/INJ: SINCRONISMO.8(RE0/P3A/CCP3/AN5) ; also sheet 15
RE1_SINCRO_SPK_IGN/INJ: SINCRONISMO.9(RE1/P3B/AN6) ; also sheet 15
RE2_SINCRO_FASE: SINCRONISMO.10(RE2/CCP5/AN7) ; also sheet 17
ROTAÇÃO: SV2.2 ; also sheet 1,18
SCK1_GERENC: SINCRONISMO.18(RC3/SCK1/SCL1/AN15) ; also sheet 1,2,11,15
SDI1_GERENC: SINCRONISMO.24(RC5/SDO1/AN17) ; also sheet 1,2,11,15
SDO1_GERENC: SINCRONISMO.23(RC4/SDI1/SDA1/AN16) ; also sheet 1,2,11,15
SENSOR_COMBUSTIVEL: X4.2 ; also sheet 7
SENSOR_VELOCIDADE: X4.3 ; also sheet 17
Unconnected: JP3.4 JP3.6

### Notes on the sheet
- PIC Sincronismo
- MARK 1
- FACULDADE DE TECNOLOGIA DE 
                             SANTO ANDRÉ
  
          Rua Prefeito Justino Paixão, 150 - Centro  
              Santo André - SP - CEP:09020-130
                            (11) 4437-2216

## Sheet 15 of 20
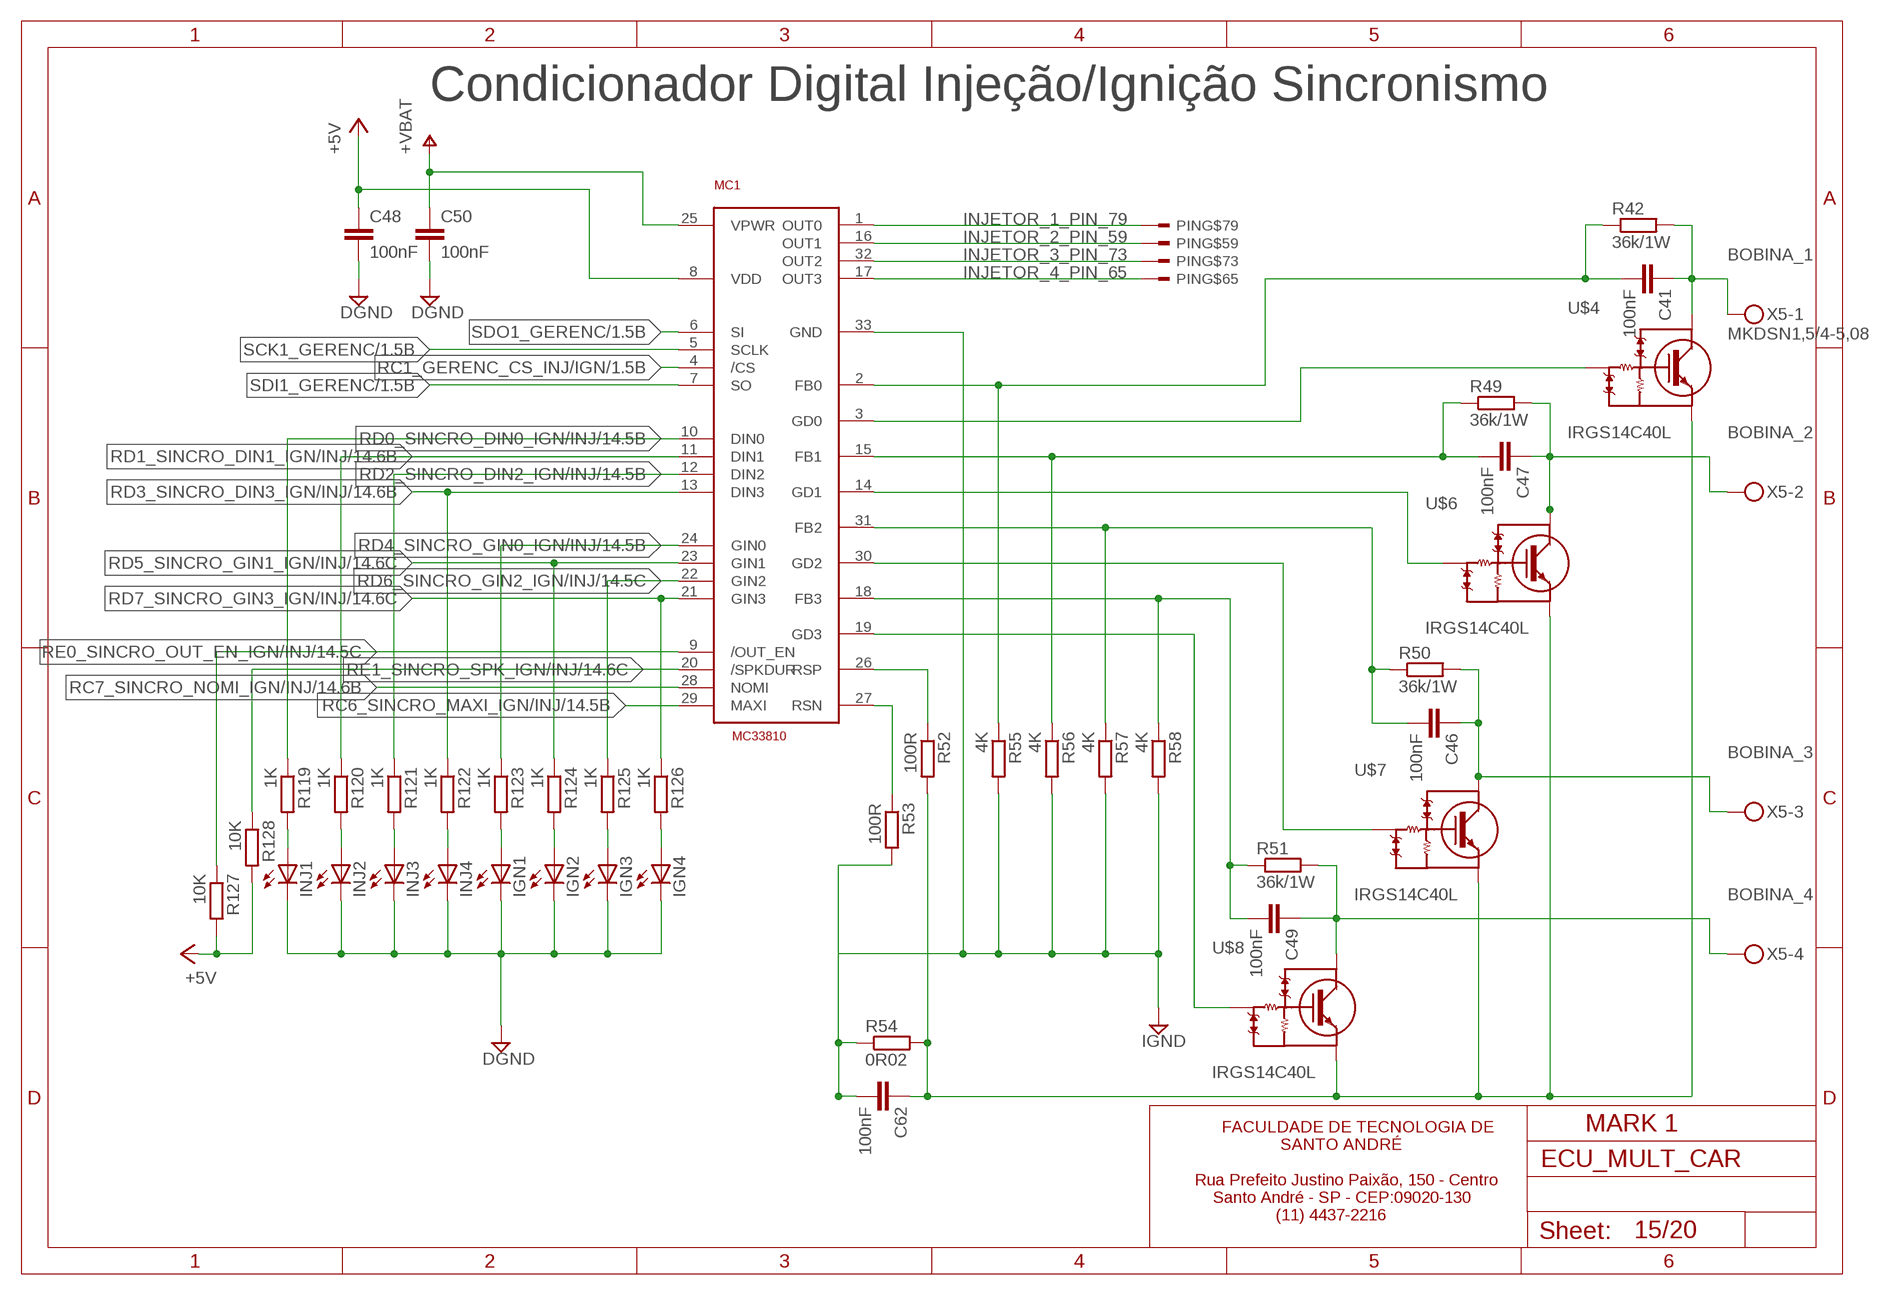
[diagram p14: schematic, sheet 15]

### Parts
C41  100nF  C-EUC0805  [C0805]
C46  100nF  C-EUC0805  [C0805]
C47  100nF  C-EUC0805  [C0805]
C48  100nF  C-EUC0805  [C0805]
C49  100nF  C-EUC0805  [C0805]
C50  100nF  C-EUC0805  [C0805]
C62  100nF  C-EUC0805  [C0805]
IGN1  LEDKA-3528ASYC  [KA-3528ASYC]
IGN2  LEDKA-3528ASYC  [KA-3528ASYC]
IGN3  LEDKA-3528ASYC  [KA-3528ASYC]
IGN4  LEDKA-3528ASYC  [KA-3528ASYC]
INJ1  LEDKA-3528ASYC  [KA-3528ASYC]
INJ2  LEDKA-3528ASYC  [KA-3528ASYC]
INJ3  LEDKA-3528ASYC  [KA-3528ASYC]
INJ4  LEDKA-3528ASYC  [KA-3528ASYC]
MC1  MC33810  [SOIC_32_PIN]
R42  36k/1W  R-EU_R2512  [R2512]
R49  36k/1W  R-EU_R2512  [R2512]
R50  36k/1W  R-EU_R2512  [R2512]
R51  36k/1W  R-EU_R2512  [R2512]
R52  100R  R-EU_M0805  [M0805]
R53  100R  R-EU_M0805  [M0805]
R54  0R02  R-EU_M0805  [M0805]
R55  4K  R-EU_M0805  [M0805]
R56  4K  R-EU_M0805  [M0805]
R57  4K  R-EU_M0805  [M0805]
R58  4K  R-EU_M0805  [M0805]
R119  1K  R-EU_M0805  [M0805]
R120  1K  R-EU_M0805  [M0805]
R121  1K  R-EU_M0805  [M0805]
R122  1K  R-EU_M0805  [M0805]
R123  1K  R-EU_M0805  [M0805]
R124  1K  R-EU_M0805  [M0805]
R125  1K  R-EU_M0805  [M0805]
R126  1K  R-EU_M0805  [M0805]
R127  10K  R-EU_M0805  [M0805]
R128  10K  R-EU_M0805  [M0805]
U$4  IRGS14C40L  [TO-263AB]
U$6  IRGS14C40L  [TO-263AB]
U$7  IRGS14C40L  [TO-263AB]
U$8  IRGS14C40L  [TO-263AB]
X5  MKDSN1,5/4-5,08  [MKDSN1,5/4-5,08]

### Nets
+5V: C48.1 MC1.8(VDD) R127.2 R128.2 ; also sheet 1,2,3,4,5,6,7,8,9,10,11,12,13,14,16,17,18,20
BOBINA_1: C41.1 R42.2 U$4.SOURCE(DRAIN) X5.1
BOBINA_2: C47.1 R49.2 U$6.SOURCE(DRAIN) X5.2
BOBINA_3: C46.1 R50.2 U$7.SOURCE(DRAIN) X5.3
BOBINA_4: C49.1 R51.2 U$8.SOURCE(DRAIN) X5.4
DGND: C48.2 C50.2 IGN1.C IGN2.C IGN3.C IGN4.C INJ1.C INJ2.C INJ3.C INJ4.C ; also sheet 1,2,3,7,8,9,10,11,14,17,18,19,20
IGND: C62.2 MC1.33(GND) R53.2 R54.1 R55.2 R56.2 R57.2 R58.2 ; also sheet 12
INJETOR_1_PIN_79: MC1.1(OUT0) PIN.79
INJETOR_2_PIN_59: MC1.16(OUT1) PIN.59
INJETOR_3_PIN_73: MC1.32(OUT2) PIN.73
INJETOR_4_PIN_65: MC1.17(OUT3) PIN.65
N$48: C41.2 MC1.2(FB0) R42.1 R55.1
N$55: C47.2 MC1.15(FB1) R49.1 R56.1
N$57: C46.2 MC1.31(FB2) R50.1 R57.1
N$59: C49.2 MC1.18(FB3) R51.1 R58.1
N$61: C62.1 R52.2 R54.2 U$4.DRAIN(SOURCE) U$6.DRAIN(SOURCE) U$7.DRAIN(SOURCE) U$8.DRAIN(SOURCE)
N$62: MC1.3(GD0) U$4.GATE
N$63: MC1.14(GD1) U$6.GATE
N$65: MC1.30(GD2) U$7.GATE
N$67: MC1.19(GD3) U$8.GATE
N$68: MC1.26(RSP) R52.1
N$69: MC1.27(RSN) R53.1
N$141: INJ1.A R119.2
N$142: INJ2.A R120.2
N$143: INJ3.A R121.2
N$144: INJ4.A R122.2
N$145: IGN1.A R123.2
N$146: IGN2.A R124.2
N$147: IGN3.A R125.2
N$148: IGN4.A R126.2
RC1_GERENC_CS_INJ/IGN: MC1.4(/CS) ; also sheet 1
RC6_SINCRO_MAXI_IGN/INJ: MC1.29(MAXI) ; also sheet 14
RC7_SINCRO_NOMI_IGN/INJ: MC1.28(NOMI) ; also sheet 14
RD0_SINCRO_DIN0_IGN/INJ: MC1.10(DIN0) R119.1 ; also sheet 14
RD1_SINCRO_DIN1_IGN/INJ: MC1.11(DIN1) R120.1 ; also sheet 14
RD2_SINCRO_DIN2_IGN/INJ: MC1.12(DIN2) R121.1 ; also sheet 14
RD3_SINCRO_DIN3_IGN/INJ: MC1.13(DIN3) R122.1 ; also sheet 14
RD4_SINCRO_GIN0_IGN/INJ: MC1.24(GIN0) R123.1 ; also sheet 14
RD5_SINCRO_GIN1_IGN/INJ: MC1.23(GIN1) R124.1 ; also sheet 14
RD6_SINCRO_GIN2_IGN/INJ: MC1.22(GIN2) R125.1 ; also sheet 14
RD7_SINCRO_GIN3_IGN/INJ: MC1.21(GIN3) R126.1 ; also sheet 14
RE0_SINCRO_OUT_EN_IGN/INJ: MC1.9(/OUT_EN) R127.1 ; also sheet 14
RE1_SINCRO_SPK_IGN/INJ: MC1.20(/SPKDUR) R128.1 ; also sheet 14
SCK1_GERENC: MC1.5(SCLK) ; also sheet 1,2,11,14
SDI1_GERENC: MC1.7(SO) ; also sheet 1,2,11,14
SDO1_GERENC: MC1.6(SI) ; also sheet 1,2,11,14
V+: C50.1 MC1.25(VPWR) ; supply symbol labelled +VBAT ; also sheet 2,3,4,5,6,13,16

### Notes on the sheet
- Condicionador Digital Injeção/Ignição Sincronismo
- MARK 1
- FACULDADE DE TECNOLOGIA DE 
                             SANTO ANDRÉ
  
          Rua Prefeito Justino Paixão, 150 - Centro  
              Santo André - SP - CEP:09020-130
                            (11) 4437-2216

## Sheet 16 of 20
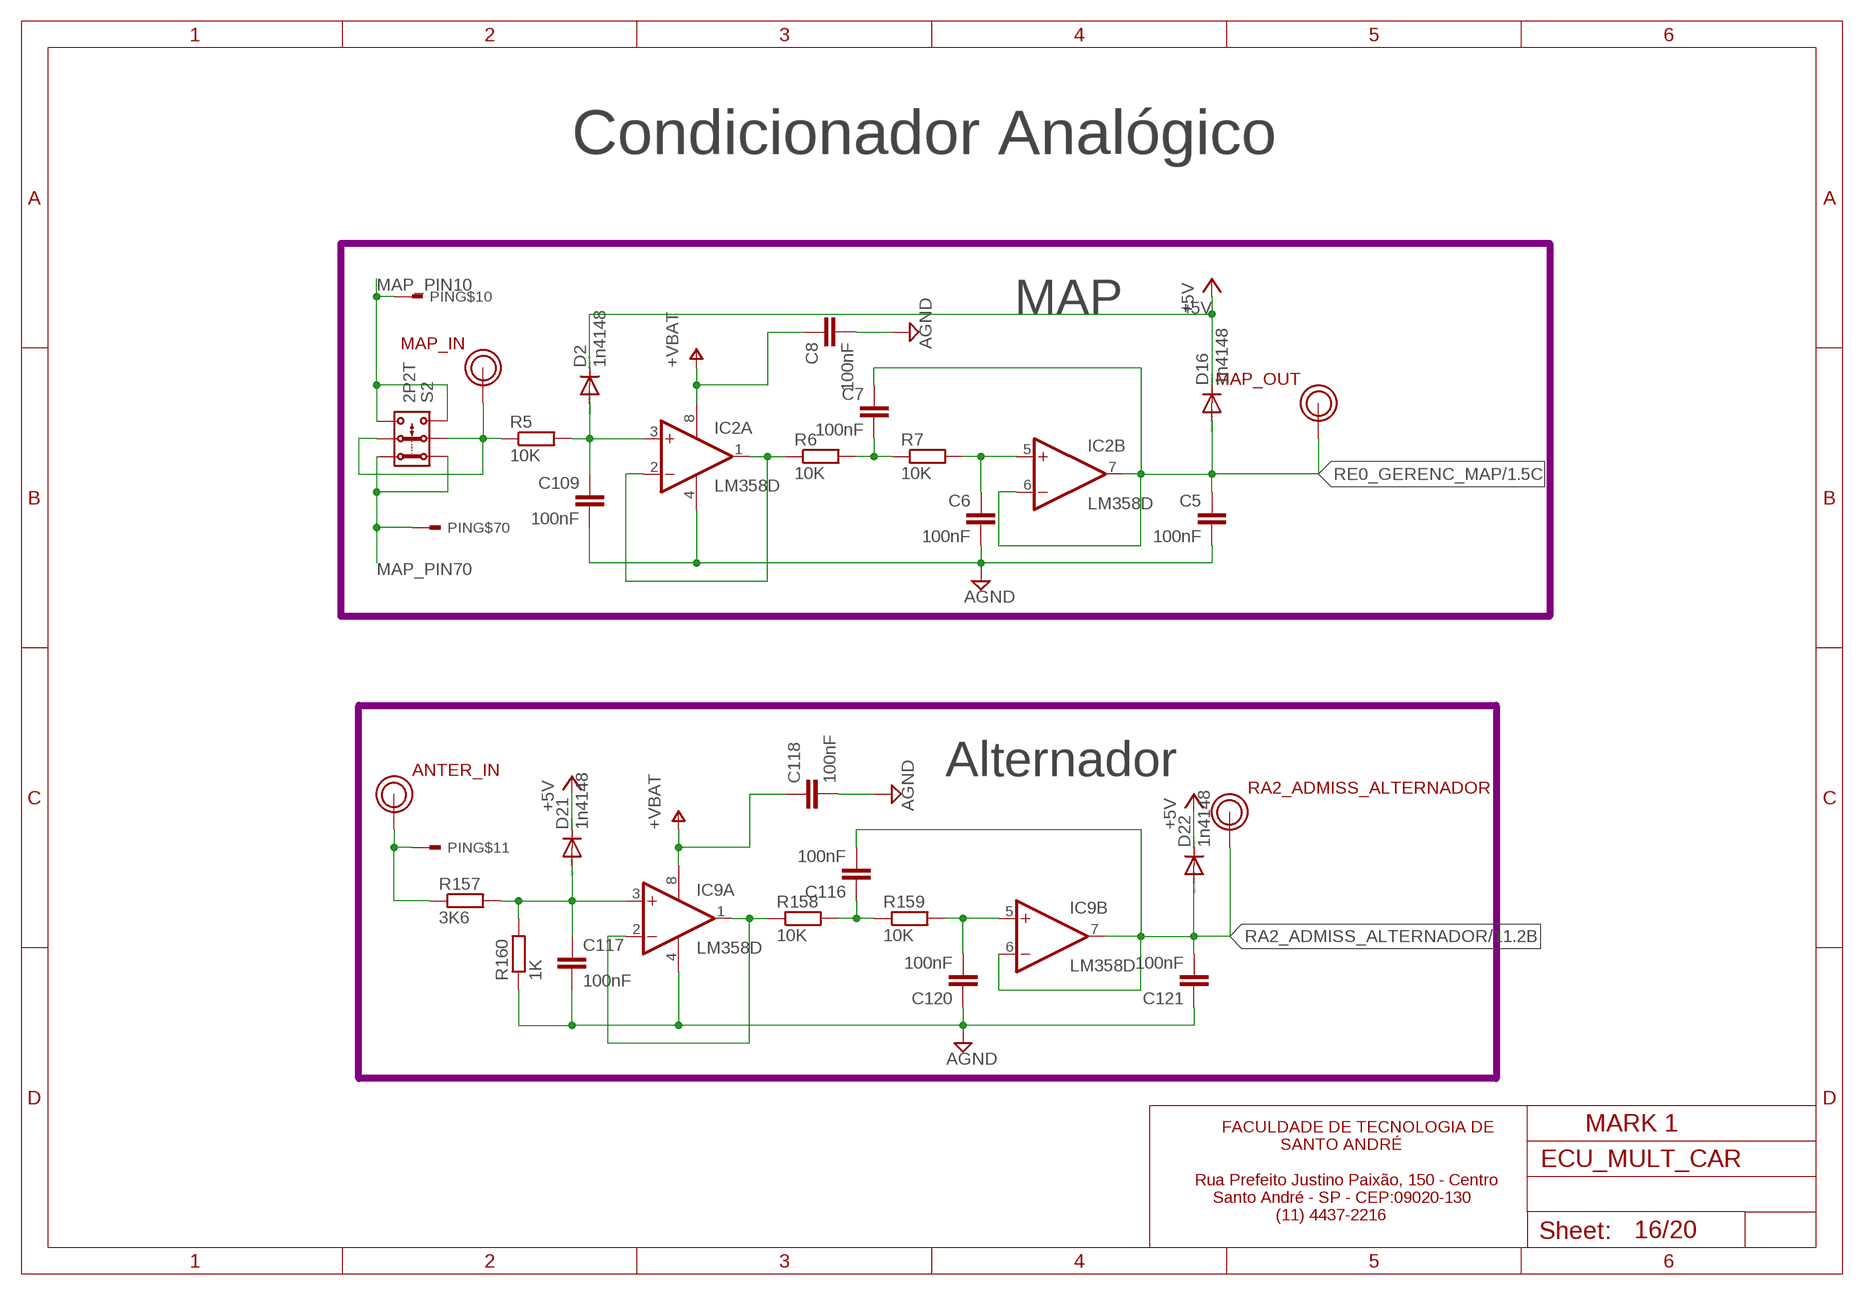
[diagram p15: schematic, sheet 16]

### Parts
ANTER_IN  PINO_TORNEADO  [PINO_TORNEADO]
C5  100nF  C-EUC0805  [C0805]
C6  100nF  C-EUC0805  [C0805]
C7  100nF  C-EUC0805  [C0805]
C8  100nF  C-EUC0805  [C0805]
C109  100nF  C-EUC0805  [C0805]
C116  100nF  C-EUC0805  [C0805]
C117  100nF  C-EUC0805  [C0805]
C118  100nF  C-EUC0805  [C0805]
C120  100nF  C-EUC0805  [C0805]
C121  100nF  C-EUC0805  [C0805]
D2  1n4148  DIODE-MINIMELF  [MINIMELF]
D16  1n4148  DIODE-MINIMELF  [MINIMELF]
D21  1n4148  DIODE-MINIMELF  [MINIMELF]
D22  1n4148  DIODE-MINIMELF  [MINIMELF]
IC2  LM358D  [SO08]
IC9  LM358D  [SO08]
MAP_IN  PINO_TORNEADO  [PINO_TORNEADO]
MAP_OUT  PINO_TORNEADO  [PINO_TORNEADO]
R5  10K  R-EU_M0805  [M0805]
R6  10K  R-EU_M0805  [M0805]
R7  10K  R-EU_M0805  [M0805]
R157  3K6  R-EU_M0805  [M0805]
R158  10K  R-EU_M0805  [M0805]
R159  10K  R-EU_M0805  [M0805]
R160  1K  R-EU_M0805  [M0805]
RA2_ADMISS_ALTERNADOR  PINO_TORNEADO  [PINO_TORNEADO]
S2  2P2T  [2P2T]

### Nets
+5V: D2.C D16.C D21.C D22.C ; also sheet 1,2,3,4,5,6,7,8,9,10,11,12,13,14,15,17,18,20
GND3: C5.2 C6.2 C8.2 C109.2 C117.2 C118.2 C120.1 C121.1 IC2.4(P:V-) IC9.4(P:V-) R160.1 ; supply symbol labelled AGND ; also sheet 2,4,5,6,12,13,20
MAP_PIN10: PIN.10 S2.3.1 S2.3.2
MAP_PIN70: PIN.70 S2.1.1 S2.1.2
N$6: C109.1 D2.A IC2.3(A:+IN) R5.2
N$7: IC2.1(A:OUT) IC2.2(A:-IN) R6.1
N$8: C7.2 R6.2 R7.1
N$9: C6.1 IC2.5(B:+IN) R7.2
N$103: MAP_IN.1(PINO1) R5.1 S2.2.1 S2.2.2
N$108: ANTER_IN.1(PINO1) PIN.11 R157.1
N$132: C117.1 D21.A IC9.3(A:+IN) R157.2 R160.2
N$133: IC9.1(A:OUT) IC9.2(A:-IN) R158.1
N$159: C116.1 R158.2 R159.1
N$174: C120.2 IC9.5(B:+IN) R159.2
RA2_ADMISS_ALTERNADOR: C116.2 C121.2 D22.A IC9.6(B:-IN) IC9.7(B:OUT) RA2_ADMISS_ALTERNADOR.1(PINO1) ; also sheet 11
RE0_GERENC_MAP: C5.1 C7.1 D16.A IC2.6(B:-IN) IC2.7(B:OUT) MAP_OUT.1(PINO1) ; also sheet 1
V+: C8.1 C118.1 IC2.8(P:V+) IC9.8(P:V+) ; supply symbol labelled +VBAT ; also sheet 2,3,4,5,6,13,15

### Notes on the sheet
- Condicionador Analógico
- MAP
- Alternador
- MARK 1
- FACULDADE DE TECNOLOGIA DE 
                             SANTO ANDRÉ
  
          Rua Prefeito Justino Paixão, 150 - Centro  
              Santo André - SP - CEP:09020-130
                            (11) 4437-2216

## Sheet 17 of 20
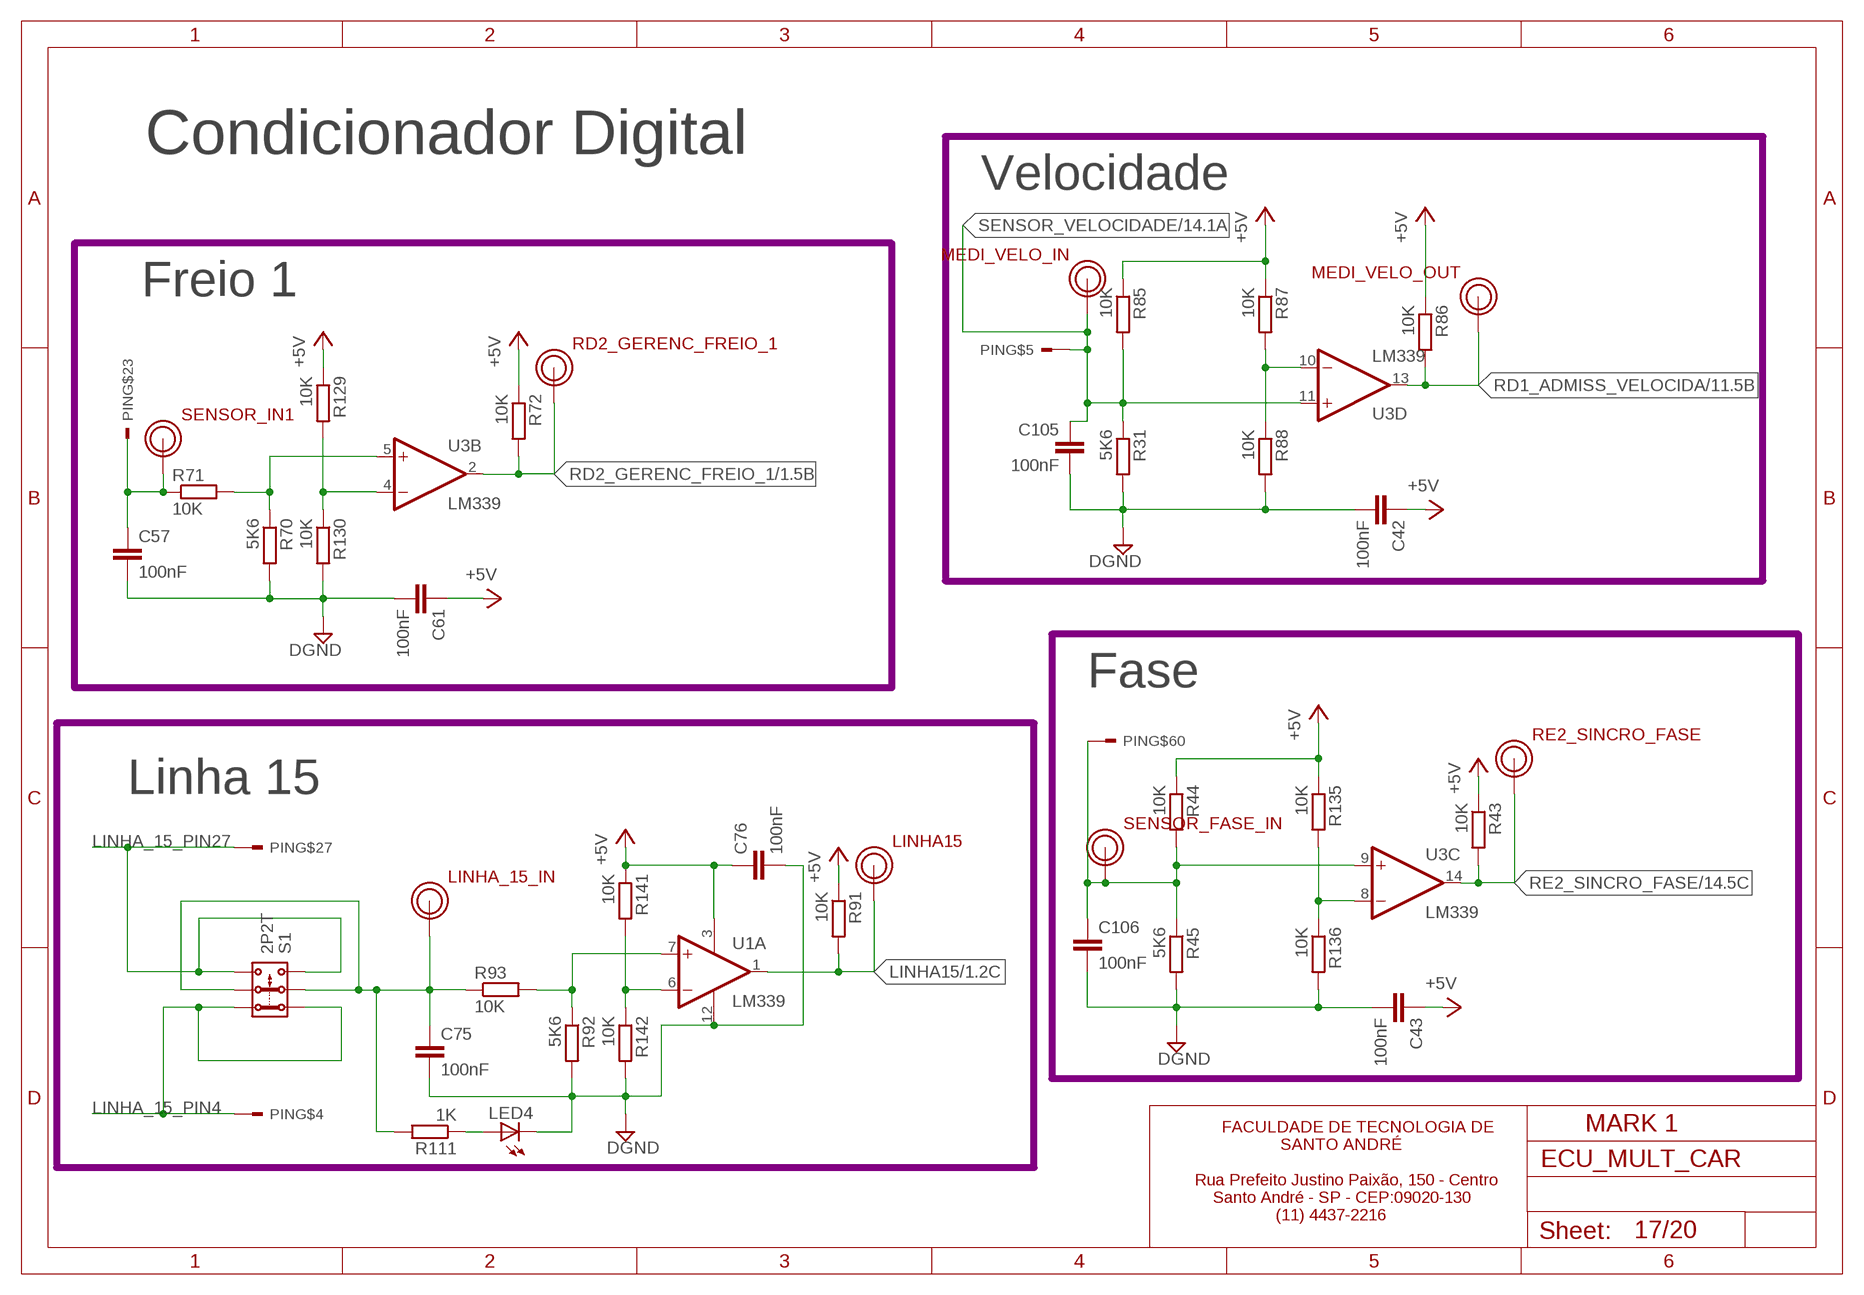
[diagram p16: schematic, sheet 17]

### Parts
C42  100nF  C-EUC0805  [C0805]
C43  100nF  C-EUC0805  [C0805]
C57  100nF  C-EUC0805  [C0805]
C61  100nF  C-EUC0805  [C0805]
C75  100nF  C-EUC0805  [C0805]
C76  100nF  C-EUC0805  [C0805]
C105  100nF  C-EUC0805  [C0805]
C106  100nF  C-EUC0805  [C0805]
LED4  LEDKA-3528ASYC  [KA-3528ASYC]
LINHA15  PINO_TORNEADO  [PINO_TORNEADO]
LINHA_15_IN  PINO_TORNEADO  [PINO_TORNEADO]
MEDI_VELO_IN  PINO_TORNEADO  [PINO_TORNEADO]
MEDI_VELO_OUT  PINO_TORNEADO  [PINO_TORNEADO]
R31  5K6  R-EU_M0805  [M0805]
R43  10K  R-EU_M0805  [M0805]
R44  10K  R-EU_M0805  [M0805]
R45  5K6  R-EU_M0805  [M0805]
R70  5K6  R-EU_M0805  [M0805]
R71  10K  R-EU_M0805  [M0805]
R72  10K  R-EU_M0805  [M0805]
R85  10K  R-EU_M0805  [M0805]
R86  10K  R-EU_M0805  [M0805]
R87  10K  R-EU_M0805  [M0805]
R88  10K  R-EU_M0805  [M0805]
R91  10K  R-EU_M0805  [M0805]
R92  5K6  R-EU_M0805  [M0805]
R93  10K  R-EU_M0805  [M0805]
R111  1K  R-EU_M0805  [M0805]
R129  10K  R-EU_M0805  [M0805]
R130  10K  R-EU_M0805  [M0805]
R135  10K  R-EU_M0805  [M0805]
R136  10K  R-EU_M0805  [M0805]
R141  10K  R-EU_M0805  [M0805]
R142  10K  R-EU_M0805  [M0805]
RD2_GERENC_FREIO_1  PINO_TORNEADO  [PINO_TORNEADO]
RE2_SINCRO_FASE  PINO_TORNEADO  [PINO_TORNEADO]
S1  2P2T  [2P2T]
SENSOR_FASE_IN  PINO_TORNEADO  [PINO_TORNEADO]
SENSOR_IN1  PINO_TORNEADO  [PINO_TORNEADO]
U1  LM339  [SOIC14N]
U3  LM339  [SOIC14N]

### Nets
+5V: C42.1 C43.1 C61.1 C76.1 R43.1 R44.1 R72.1 R85.1 R86.1 R87.1 R91.1 R129.1 R135.1 R141.1 U1.3(V+) ; also sheet 1,2,3,4,5,6,7,8,9,10,11,12,13,14,15,16,18,20
DGND: C42.2 C43.2 C57.2 C61.2 C75.2 C76.2 C105.2 C106.2 LED4.C R31.2 R45.2 R70.2 R88.2 R92.2 R130.2 R136.2 R142.2 U1.12(V-) ; also sheet 1,2,3,7,8,9,10,11,14,15,18,19,20
LINHA15: LINHA15.1(PINO1) R91.2 U1.1(A:OUT) ; also sheet 1,8,11,14
LINHA_15_PIN4: PIN.4 S1.1.1 S1.1.2
LINHA_15_PIN27: PIN.27 S1.3.1 S1.3.2 ; also sheet 6,12
N$40: R87.2 R88.1 U3.10(D:-IN)
N$71: R70.1 R71.2 U3.5(B:+IN)
N$72: C57.1 PIN.23 R71.1 SENSOR_IN1.1(PINO1)
N$74: R129.2 R130.1 U3.4(B:-IN)
N$93: R92.1 R93.2 U1.7(A:+IN)
N$105: LED4.A R111.1
N$109: C75.1 LINHA_15_IN.1(PINO1) R93.1 R111.2 S1.2.1 S1.2.2
N$118: C106.1 PIN.60 R44.2 R45.1 SENSOR_FASE_IN.1(PINO1) U3.9(C:+IN)
N$168: R135.2 R136.1 U3.8(C:-IN)
N$169: R141.2 R142.1 U1.6(A:-IN)
RD1_ADMISS_VELOCIDA: MEDI_VELO_OUT.1(PINO1) R86.2 U3.13(D:OUT) ; also sheet 11
RD2_GERENC_FREIO_1: R72.2 RD2_GERENC_FREIO_1.1(PINO1) U3.2(B:OUT) ; also sheet 1
RE2_SINCRO_FASE: R43.2 RE2_SINCRO_FASE.1(PINO1) U3.14(C:OUT) ; also sheet 14
SENSOR_VELOCIDADE: C105.1 MEDI_VELO_IN.1(PINO1) PIN.5 R31.1 R85.2 U3.11(D:+IN) ; also sheet 14
Unconnected: U1.2(B:OUT) U1.4(B:-IN) U1.5(B:+IN) U1.8(C:-IN) U1.9(C:+IN) U1.10(D:-IN) U1.11(D:+IN) U1.13(D:OUT) U1.14(C:OUT)

### Notes on the sheet
- Condicionador Digital
- Velocidade
- Freio 1
- Fase
- Linha 15
- MARK 1
- FACULDADE DE TECNOLOGIA DE 
                             SANTO ANDRÉ
  
          Rua Prefeito Justino Paixão, 150 - Centro  
              Santo André - SP - CEP:09020-130
                            (11) 4437-2216

## Sheet 18 of 20
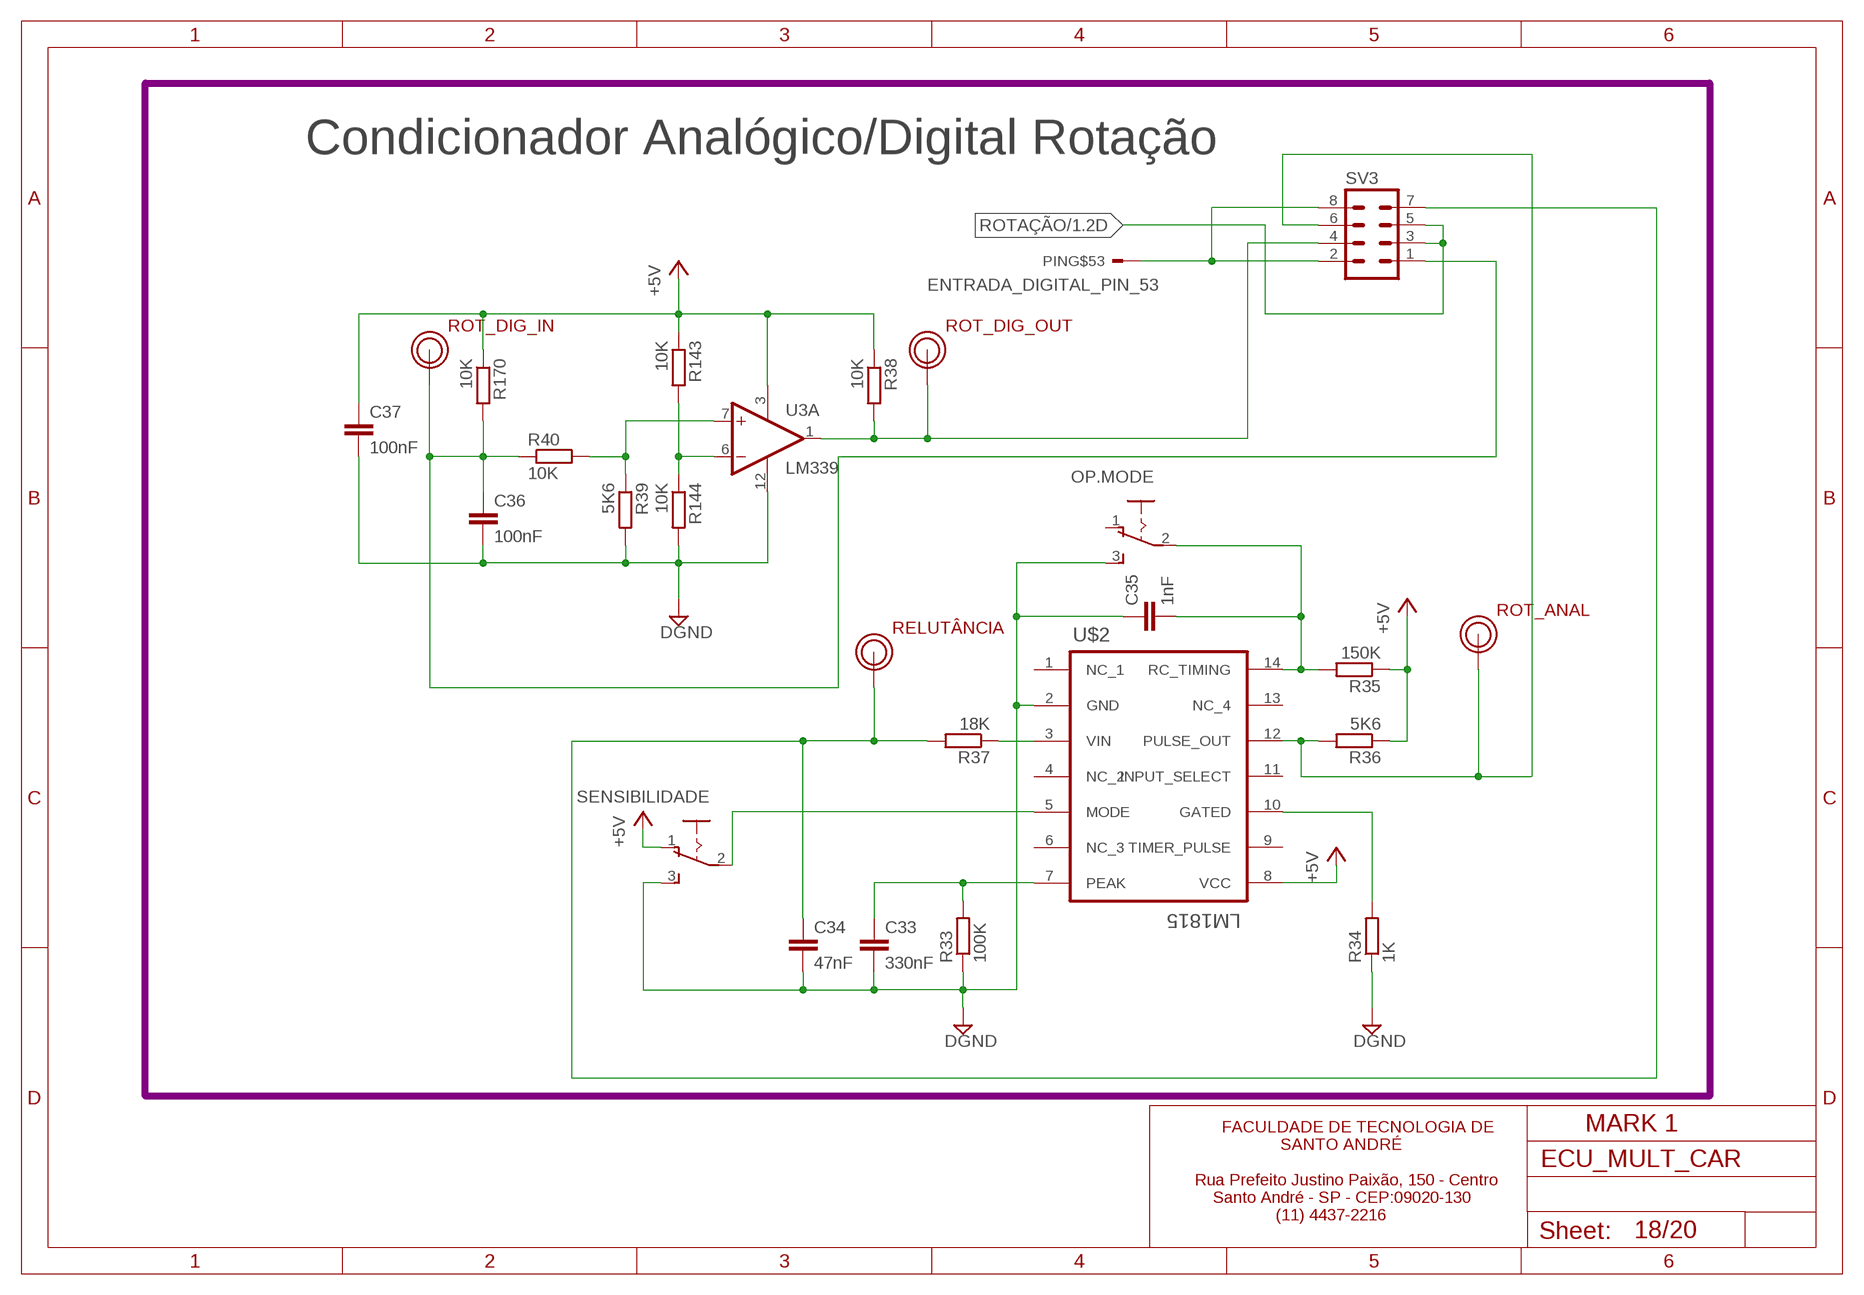
[diagram p17: schematic, sheet 18]

### Parts
C33  330nF  C-EUC0805  [C0805]
C34  47nF  C-EUC0805  [C0805]
C35  1nF  C-EUC0805  [C0805]
C36  100nF  C-EUC0805  [C0805]
C37  100nF  C-EUC0805  [C0805]
OP.MODE  M251  [M251]
R33  100K  R-EU_M0805  [M0805]
R34  1K  R-EU_M0805  [M0805]
R35  150K  R-EU_M0805  [M0805]
R36  5K6  R-EU_M0805  [M0805]
R37  18K  R-EU_M0805  [M0805]
R38  10K  R-EU_M0805  [M0805]
R39  5K6  R-EU_M0805  [M0805]
R40  10K  R-EU_M0805  [M0805]
R143  10K  R-EU_M0805  [M0805]
R144  10K  R-EU_M0805  [M0805]
R170  10K  R-EU_M0805  [M0805]
RELUTÂNCIA  PINO_TORNEADO  [PINO_TORNEADO]
ROT_ANAL  PINO_TORNEADO  [PINO_TORNEADO]
ROT_DIG_IN  PINO_TORNEADO  [PINO_TORNEADO]
ROT_DIG_OUT  PINO_TORNEADO  [PINO_TORNEADO]
SENSIBILIDADE  M251  [M251]
SV3  MA04-2  [MA04-2]
U$2  LM1815  [SOICLM1815]

### Nets
+5V: C37.1 R35.1 R36.1 R38.1 R143.1 R170.1 SENSIBILIDADE.1(O) U3.3(V+) U$2.8(VCC) ; also sheet 1,2,3,4,5,6,7,8,9,10,11,12,13,14,15,16,17,20
DGND: C33.2 C34.2 C35.1 C36.2 C37.2 OP.MODE.3(S) R33.1 R34.1 R39.2 R144.2 SENSIBILIDADE.3(S) U3.12(V-) U$2.2(GND) ; also sheet 1,2,3,7,8,9,10,11,14,15,17,19,20
ENTRADA_DIGITAL_PIN_53: PIN.53 SV3.2 SV3.8
N$39: C33.1 R33.2 U$2.7(PEAK)
N$41: R37.1 U$2.3(VIN)
N$42: R34.2 U$2.10(GATED)
N$43: C35.2 OP.MODE.2(P) R35.2 U$2.14(RC_TIMING)
N$44: R39.1 R40.2 U3.7(A:+IN)
N$45: C36.1 R40.1 R170.2 ROT_DIG_IN.1(PINO1) SV3.1
N$46: SENSIBILIDADE.2(P) U$2.5(MODE)
N$170: R143.2 R144.1 U3.6(A:-IN)
RELUTÂNCIA: C34.1 R37.2 RELUTÂNCIA.1(PINO1) SV3.7
ROT_ANA: R36.2 ROT_ANAL.1(PINO1) SV3.6 U$2.12(PULSE_OUT)
ROT_DIG: R38.2 ROT_DIG_OUT.1(PINO1) SV3.4 U3.1(A:OUT)
ROTAÇÃO: SV3.3 SV3.5 ; also sheet 1,14
Unconnected: OP.MODE.1(O) U$2.1(NC_1) U$2.4(NC_2) U$2.6(NC_3) U$2.9(TIMER_PULSE) U$2.11(INPUT_SELECT) U$2.13(NC_4)

### Notes on the sheet
- Condicionador Analógico/Digital Rotação
- MARK 1
- FACULDADE DE TECNOLOGIA DE 
                             SANTO ANDRÉ
  
          Rua Prefeito Justino Paixão, 150 - Centro  
              Santo André - SP - CEP:09020-130
                            (11) 4437-2216

## Sheet 19 of 20
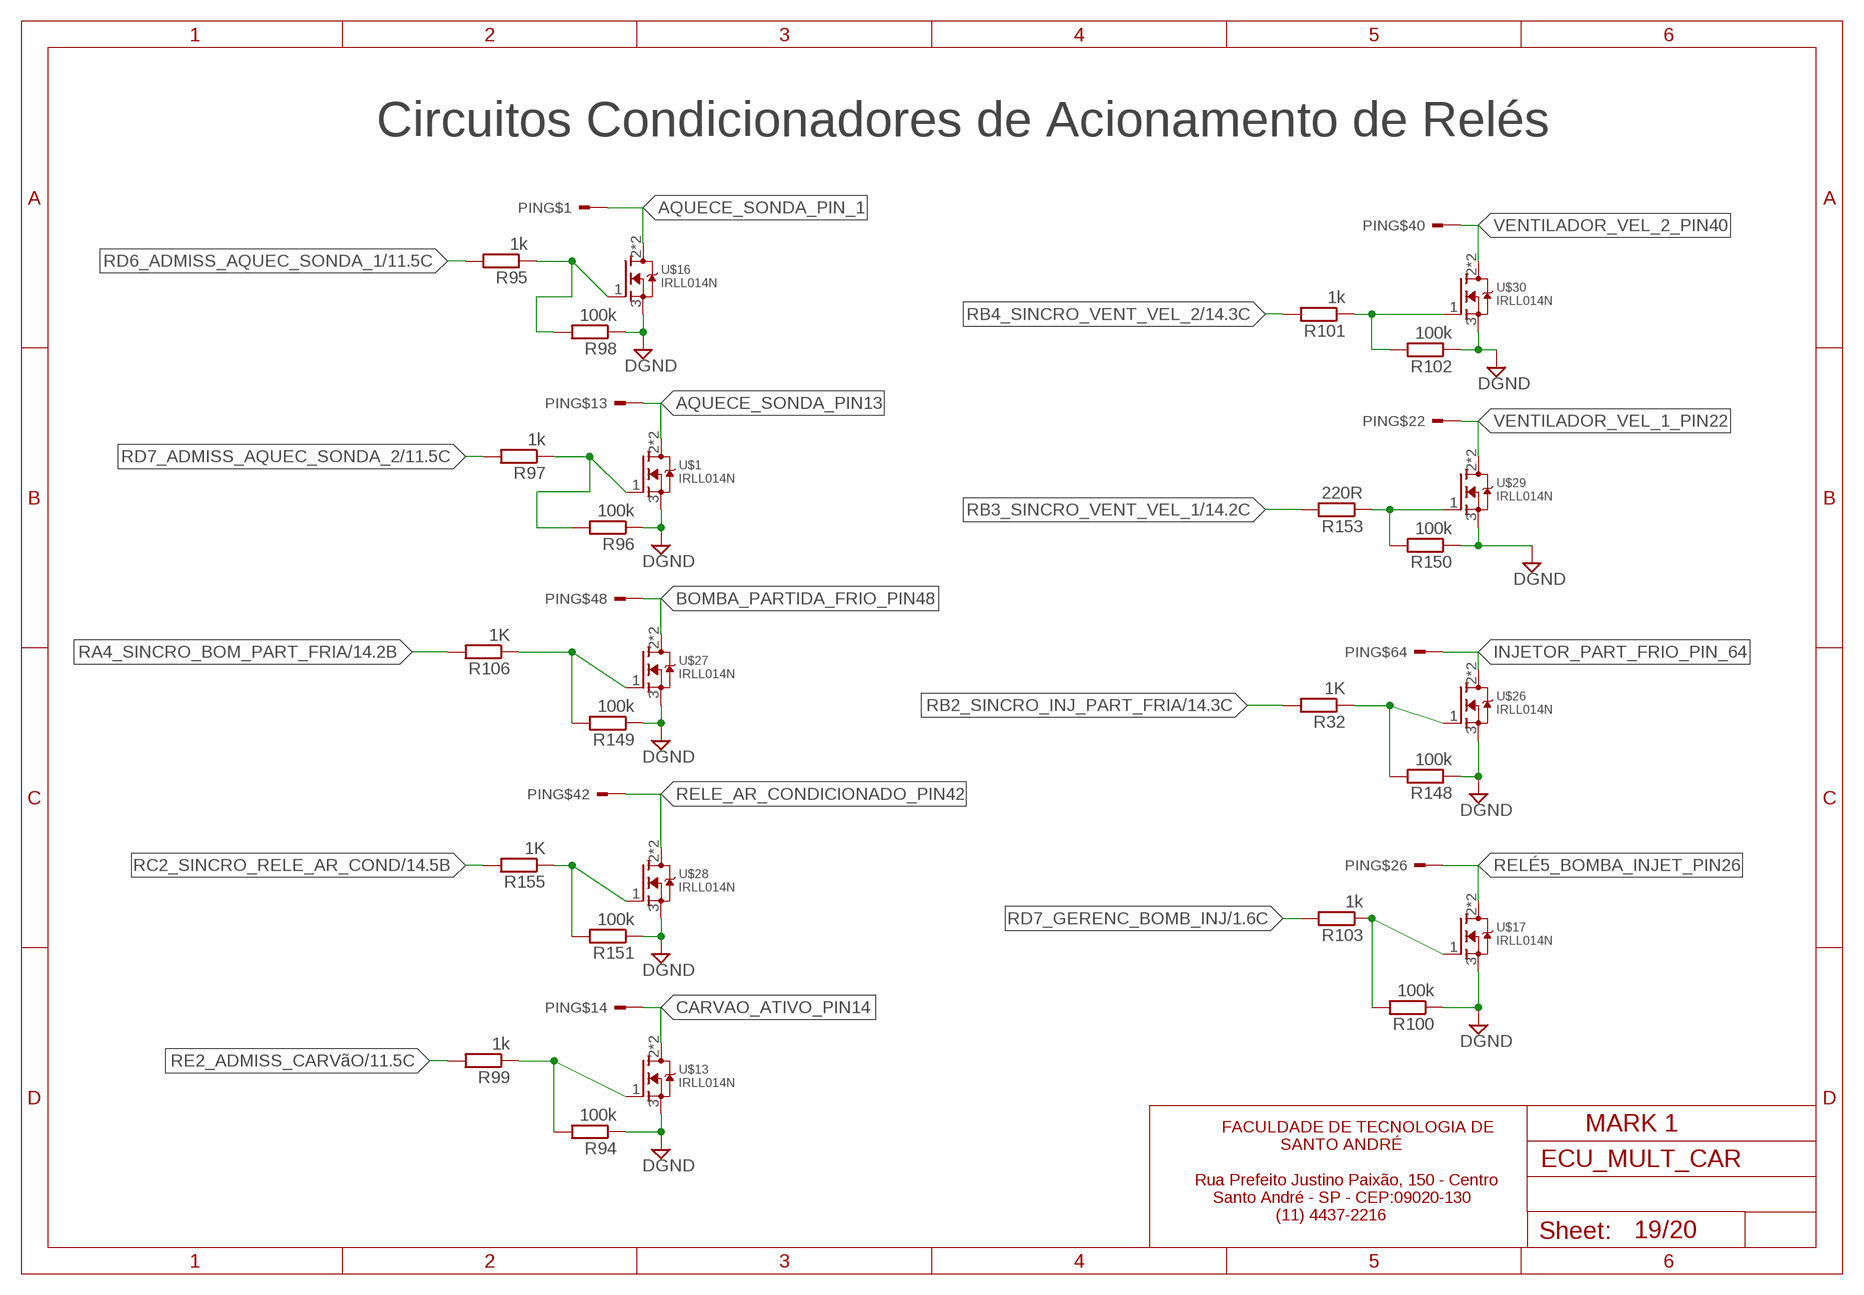
[diagram p18: schematic, sheet 19]

### Parts
R32  1K  R-EU_M0805  [M0805]
R94  100k  R-EU_M0805  [M0805]
R95  1k  R-EU_M0805  [M0805]
R96  100k  R-EU_M0805  [M0805]
R97  1k  R-EU_M0805  [M0805]
R98  100k  R-EU_M0805  [M0805]
R99  1k  R-EU_M0805  [M0805]
R100  100k  R-EU_M0805  [M0805]
R101  1k  R-EU_M0805  [M0805]
R102  100k  R-EU_M0805  [M0805]
R103  1k  R-EU_M0805  [M0805]
R106  1K  R-EU_M0805  [M0805]
R148  100k  R-EU_M0805  [M0805]
R149  100k  R-EU_M0805  [M0805]
R150  100k  R-EU_M0805  [M0805]
R151  100k  R-EU_M0805  [M0805]
R153  220R  R-EU_M0805  [M0805]
R155  1K  R-EU_M0805  [M0805]
U$1  IRLL014N  [SOT-223]
U$13  IRLL014N  [SOT-223]
U$16  IRLL014N  [SOT-223]
U$17  IRLL014N  [SOT-223]
U$26  IRLL014N  [SOT-223]
U$27  IRLL014N  [SOT-223]
U$28  IRLL014N  [SOT-223]
U$29  IRLL014N  [SOT-223]
U$30  IRLL014N  [SOT-223]

### Nets
AQUECE_SONDA_PIN13: PIN.13 U$1.2(D) U$1.4(D)
AQUECE_SONDA_PIN_1: PIN.1 U$16.2(D) U$16.4(D)
BOMBA_PARTIDA_FRIO_PIN48: PIN.48 U$27.2(D) U$27.4(D)
CARVAO_ATIVO_PIN14: PIN.14 U$13.2(D) U$13.4(D)
DGND: R94.1 R96.1 R98.1 R100.1 R102.1 R148.1 R149.1 R150.1 R151.1 U$1.3(S) U$13.3(S) U$16.3(S) U$17.3(S) U$26.3(S) U$27.3(S) U$28.3(S) U$29.3(S) U$30.3(S) ; also sheet 1,2,3,7,8,9,10,11,14,15,17,18,20
INJETOR_PART_FRIO_PIN_64: PIN.64 U$26.2(D) U$26.4(D)
N$99: R95.1 R98.2 U$16.1(G)
N$101: R96.2 R97.1 U$1.1(G)
N$104: R94.2 R99.1 U$13.1(G)
N$107: R100.2 R103.1 U$17.1(G)
N$122: R32.1 R148.2 U$26.1(G)
N$176: R106.1 R149.2 U$27.1(G)
N$178: R101.1 R102.2 U$30.1(G)
N$180: R150.2 R153.1 U$29.1(G)
N$182: R151.2 R155.1 U$28.1(G)
RA4_SINCRO_BOM_PART_FRIA: R106.2 ; also sheet 14
RB2_SINCRO_INJ_PART_FRIA: R32.2 ; also sheet 14
RB3_SINCRO_VENT_VEL_1: R153.2 ; also sheet 14
RB4_SINCRO_VENT_VEL_2: R101.2 ; also sheet 14
RC2_SINCRO_RELE_AR_COND: R155.2 ; also sheet 14
RD6_ADMISS_AQUEC_SONDA_1: R95.2 ; also sheet 11
RD7_ADMISS_AQUEC_SONDA_2: R97.2 ; also sheet 11
RD7_GERENC_BOMB_INJ: R103.2 ; also sheet 1
RE2_ADMISS_CARVãO: R99.2 ; also sheet 11
RELE_AR_CONDICIONADO_PIN42: PIN.42 U$28.2(D) U$28.4(D)
RELÉ5_BOMBA_INJET_PIN26: PIN.26 U$17.2(D) U$17.4(D)
VENTILADOR_VEL_1_PIN22: PIN.22 U$29.2(D) U$29.4(D)
VENTILADOR_VEL_2_PIN40: PIN.40 U$30.2(D) U$30.4(D)

### Notes on the sheet
- Circuitos Condicionadores de Acionamento de Relés
- MARK 1
- FACULDADE DE TECNOLOGIA DE 
                             SANTO ANDRÉ
  
          Rua Prefeito Justino Paixão, 150 - Centro  
              Santo André - SP - CEP:09020-130
                            (11) 4437-2216